# EAGLE schematic RefOsc10MHz_3V0_bga-escaped (EAGLE 7.2.0), part 1 of 2
DF4IAH - 10 MHz Reference Oscillator

## Sheet 1 of 27: Overview
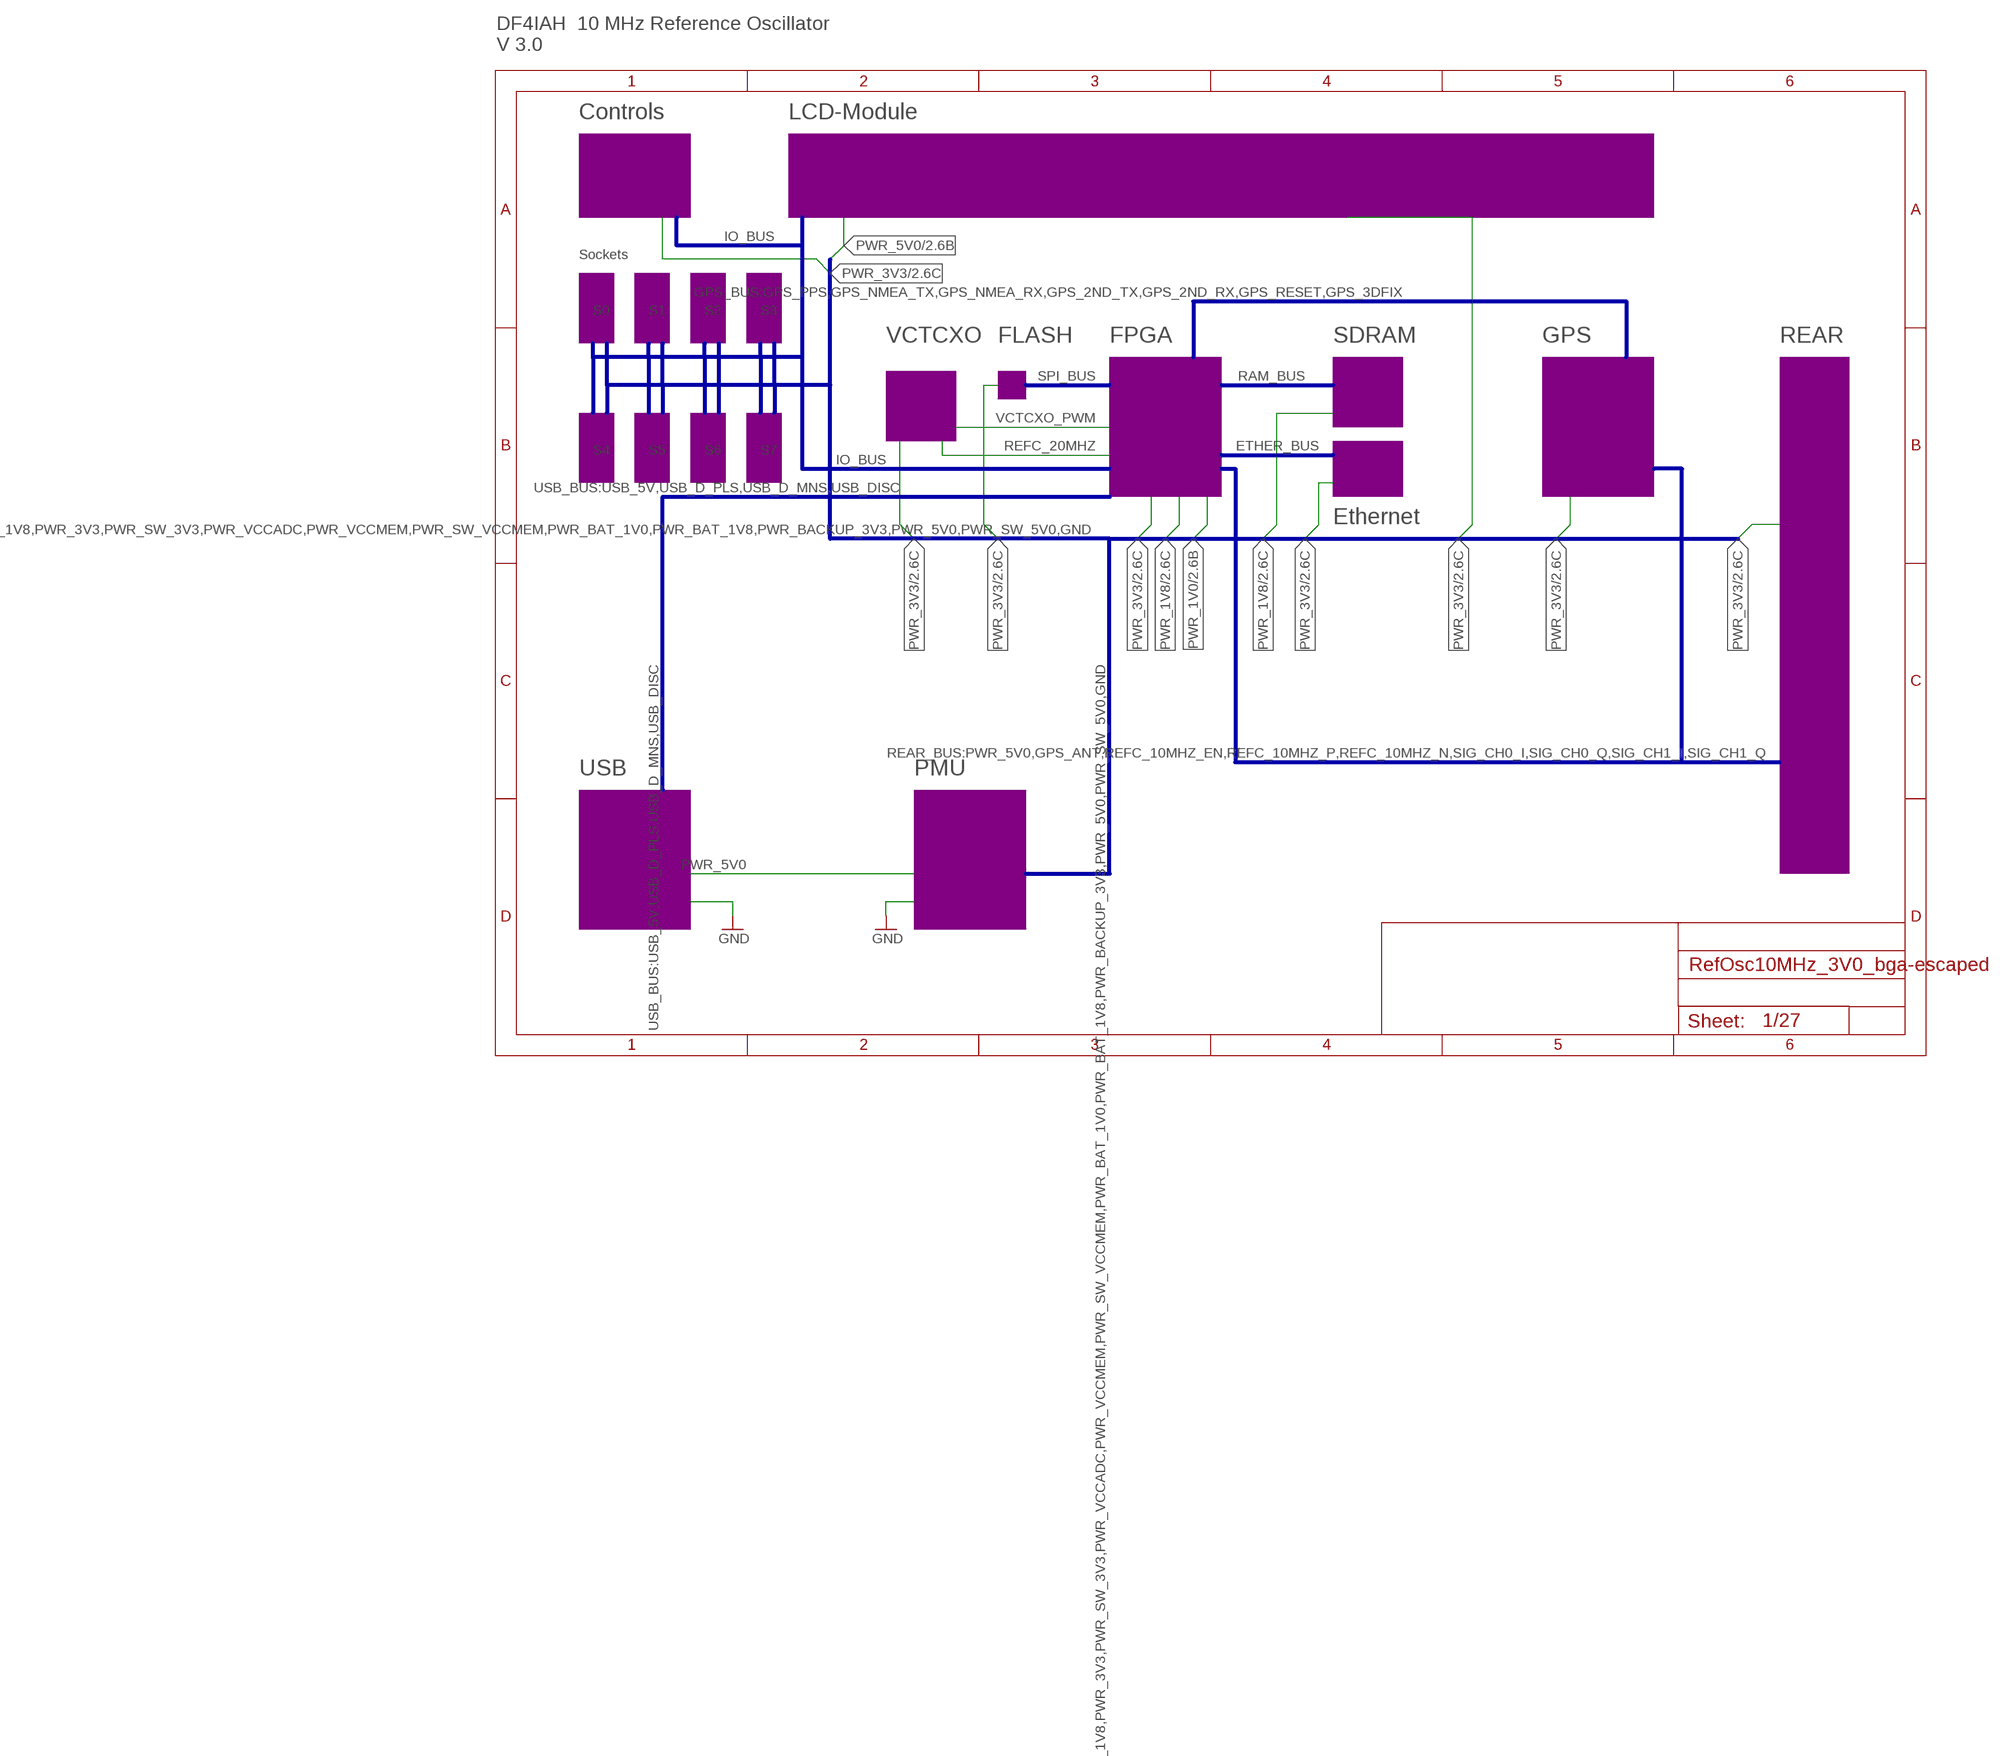
[diagram p0: schematic, sheet 1]

### Buses
USB_BUS:USB_5V,USB_D_PLS,USB_D_MNS,USB_DISC
PWR_RAIL:PWR_1V0,PWR_1V8,PWR_3V3,PWR_SW_3V3,PWR_VCCADC,PWR_VCCMEM,PWR_SW_VCCMEM,PWR_BAT_1V0,PWR_BAT_1V8,PWR_BACKUP_3V3,PWR_5V0,PWR_SW_5V0,GND
GPS_BUS:GPS_PPS,GPS_NMEA_TX,GPS_NMEA_RX,GPS_2ND_TX,GPS_2ND_RX,GPS_RESET,GPS_3DFIX
REAR_BUS:PWR_5V0,GPS_ANT,REFC_10MHZ_EN,REFC_10MHZ_P,REFC_10MHZ_N,SIG_CH0_I,SIG_CH0_Q,SIG_CH1_I,SIG_CH1_Q
IO_BUS
RAM_BUS
ETHER_BUS
SPI_BUS

### Notes on the sheet
- DF4IAH  10 MHz Reference Oscillator
  V 3.0
- Controls | LCD-Module
- Sockets
- S0 | S1 | S2 | S3
- VCTCXO | FLASH | FPGA | SDRAM | GPS | REAR
- S4 | S5 | S6 | S7
- Ethernet
- USB | PMU

## Sheet 2 of 27: PMU
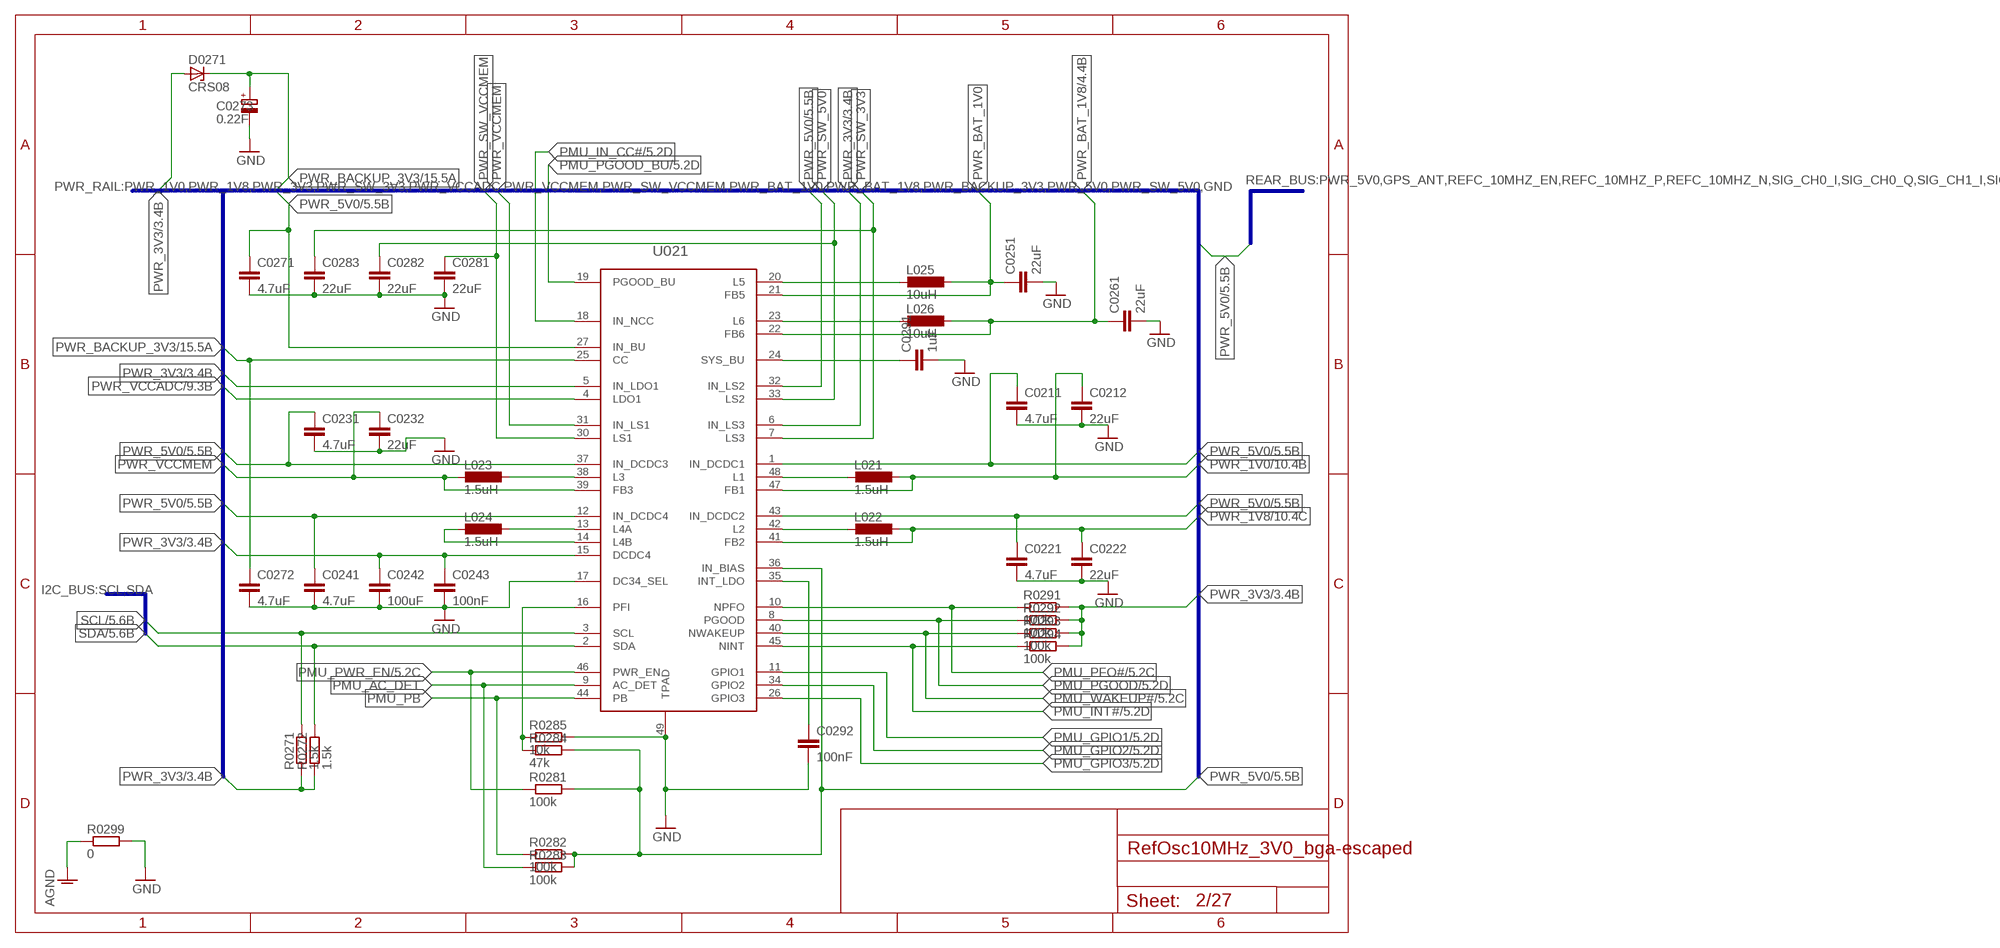
[diagram p1: schematic, sheet 2]

### Parts
C0211  4.7uF  C-EUC0805  [C0805]
C0212  22uF  C-EUC0805  [C0805]
C0221  4.7uF  C-EUC0805  [C0805]
C0222  22uF  C-EUC0805  [C0805]
C0231  4.7uF  C-EUC0805  [C0805]
C0232  22uF  C-EUC0805  [C0805]
C0241  4.7uF  C-EUC0805  [C0805]
C0242  100uF  C-EUC0805  [C0805]
C0243  100nF  C-EUC0805  [C0805]
C0251  22uF  C-EUC0805  [C0805]
C0261  22uF  C-EUC0805  [C0805]
C0271  4.7uF  C-EUC0805  [C0805]
C0272  4.7uF  C-EUC0805  [C0805]
C0273  0.22F  CPOL-EUC  [PANASONIC_C]
C0281  22uF  C-EUC0805  [C0805]
C0282  22uF  C-EUC0805  [C0805]
C0283  22uF  C-EUC0805  [C0805]
C0291  1uF  C-EUC0805  [C0805]
C0292  100nF  C-EUC0805  [C0805]
D0271  CRS08  ZENER-DIODESOT23  [SOT23]
L021  1.5uH  L-EUL1812  [L1812]
L022  1.5uH  L-EUL1812  [L1812]
L023  1.5uH  L-EUL1812  [L1812]
L024  1.5uH  L-EUL1812  [L1812]
L025  10uH  L-EUL1812  [L1812]
L026  10uH  L-EUL1812  [L1812]
R0271  1.5k  R-EU_R0603  [R0603]
R0272  1.5k  R-EU_R0603  [R0603]
R0281  100k  R-EU_R0603  [R0603]
R0282  100k  R-EU_R0603  [R0603]
R0283  100k  R-EU_R0603  [R0603]
R0284  47k  R-EU_R0603  [R0603]
R0285  10k  R-EU_R0603  [R0603]
R0291  100k  R-EU_R0603  [R0603]
R0292  100k  R-EU_R0603  [R0603]
R0293  100k  R-EU_R0603  [R0603]
R0294  100k  R-EU_R0603  [R0603]
R0299  0  R-EU_R0805  [R0805]
U021  TPS65218  [QFP50P900X900X120-49N2]

### Nets
AGND: R0299.1 ; also sheet 9
GND: C0211.2 C0212.2 C0221.2 C0222.2 C0231.2 C0232.2 C0241.2 C0242.2 C0243.2 C0251.2 C0261.2 C0271.2 C0272.2 C0273.- C0281.2 C0282.2 C0283.2 C0291.2 C0292.2 R0285.2 R0299.2 U021.17(DC34_SEL) U021.49(TPAD) ; also sheet 1,3,4,5,6,7,8,9,10,11,14,15,18,19
L1: L021.2 U021.48(L1)
L2: L022.2 U021.42(L2)
L3: L023.1 U021.38(L3)
L4A: L024.1 U021.13(L4A)
L4B: L024.2 U021.14(L4B)
L5: L025.2 U021.20(L5)
L6: L026.2 U021.23(L6)
N$1: C0292.1 U021.35(INT_LDO)
N$2: R0284.1 R0285.1 U021.16(PFI)
PMU_AC_DET: R0283.1 U021.9(AC_DET)
PMU_GPIO1: U021.11(GPIO1) ; also sheet 5
PMU_GPIO2: U021.34(GPIO2) ; also sheet 5
PMU_GPIO3: U021.26(GPIO3) ; also sheet 5
PMU_IN_CC#: U021.18(IN_NCC) ; also sheet 5
PMU_INT#: R0294.1 U021.45(NINT) ; also sheet 5
PMU_PB: R0282.1 U021.44(PB)
PMU_PFO#: R0291.1 U021.10(NPFO) ; also sheet 5
PMU_PGOOD: R0292.1 U021.8(PGOOD) ; also sheet 5
PMU_PGOOD_BU: U021.19(PGOOD_BU) ; also sheet 5
PMU_PWR_EN: R0281.1 U021.46(PWR_EN) ; also sheet 5
PMU_WAKEUP#: R0293.1 U021.40(NWAKEUP) ; also sheet 5
PWR_1V0 [PWR_LOW]: C0212.1 L021.1 U021.47(FB1) ; also sheet 1,10
PWR_1V8 [PWR_LOW]: C0222.1 L022.1 U021.41(FB2) ; also sheet 1,10
PWR_3V3 [PWR_MED]: C0242.1 C0243.1 D0271.1(A) R0271.1 R0272.1 R0291.2 R0292.2 R0293.2 R0294.2 U021.5(IN_LDO1) U021.6(IN_LS3) U021.15(DCDC4) ; also sheet 1,3,4,5,6,7,8,11,15
PWR_5V0: C0211.1 C0221.1 C0231.1 C0241.1 C0271.1 R0281.2 R0282.2 R0283.2 R0284.2 U021.1(IN_DCDC1) U021.12(IN_DCDC4) U021.27(IN_BU) U021.32(IN_LS2) U021.36(IN_BIAS) U021.37(IN_DCDC3) U021.43(IN_DCDC2) ; also sheet 1,5,14,15,18
PWR_BACKUP_3V3 [PWR_LOW]: C0272.1 C0273.+ D0271.3(C) U021.25(CC) ; also sheet 15
PWR_BAT_1V0: C0251.1 L025.1 U021.21(FB5)
PWR_BAT_1V8: C0261.1 L026.1 U021.22(FB6) ; also sheet 4
PWR_SW_3V3: C0283.1 U021.7(LS3)
PWR_SW_5V0: C0282.1 U021.33(LS2)
PWR_SW_VCCMEM: C0281.1 U021.30(LS1)
PWR_VCCADC: U021.4(LDO1) ; also sheet 9
PWR_VCCMEM: C0232.1 L023.2 U021.31(IN_LS1) U021.39(FB3)
SCL: R0271.2 U021.3(SCL) ; also sheet 5
SDA: R0272.2 U021.2(SDA) ; also sheet 5
SYS_BU: C0291.1 U021.24(SYS_BU)

### Buses
PWR_RAIL:PWR_1V0,PWR_1V8,PWR_3V3,PWR_SW_3V3,PWR_VCCADC,PWR_VCCMEM,PWR_SW_VCCMEM,PWR_BAT_1V0,PWR_BAT_1V8,PWR_BACKUP_3V3,PWR_5V0,PWR_SW_5V0,GND
I2C_BUS:SCL,SDA
REAR_BUS:PWR_5V0,GPS_ANT,REFC_10MHZ_EN,REFC_10MHZ_P,REFC_10MHZ_N,SIG_CH0_I,SIG_CH0_Q,SIG_CH1_I,SIG_CH1_Q

## Sheet 3 of 27: VCTCXO
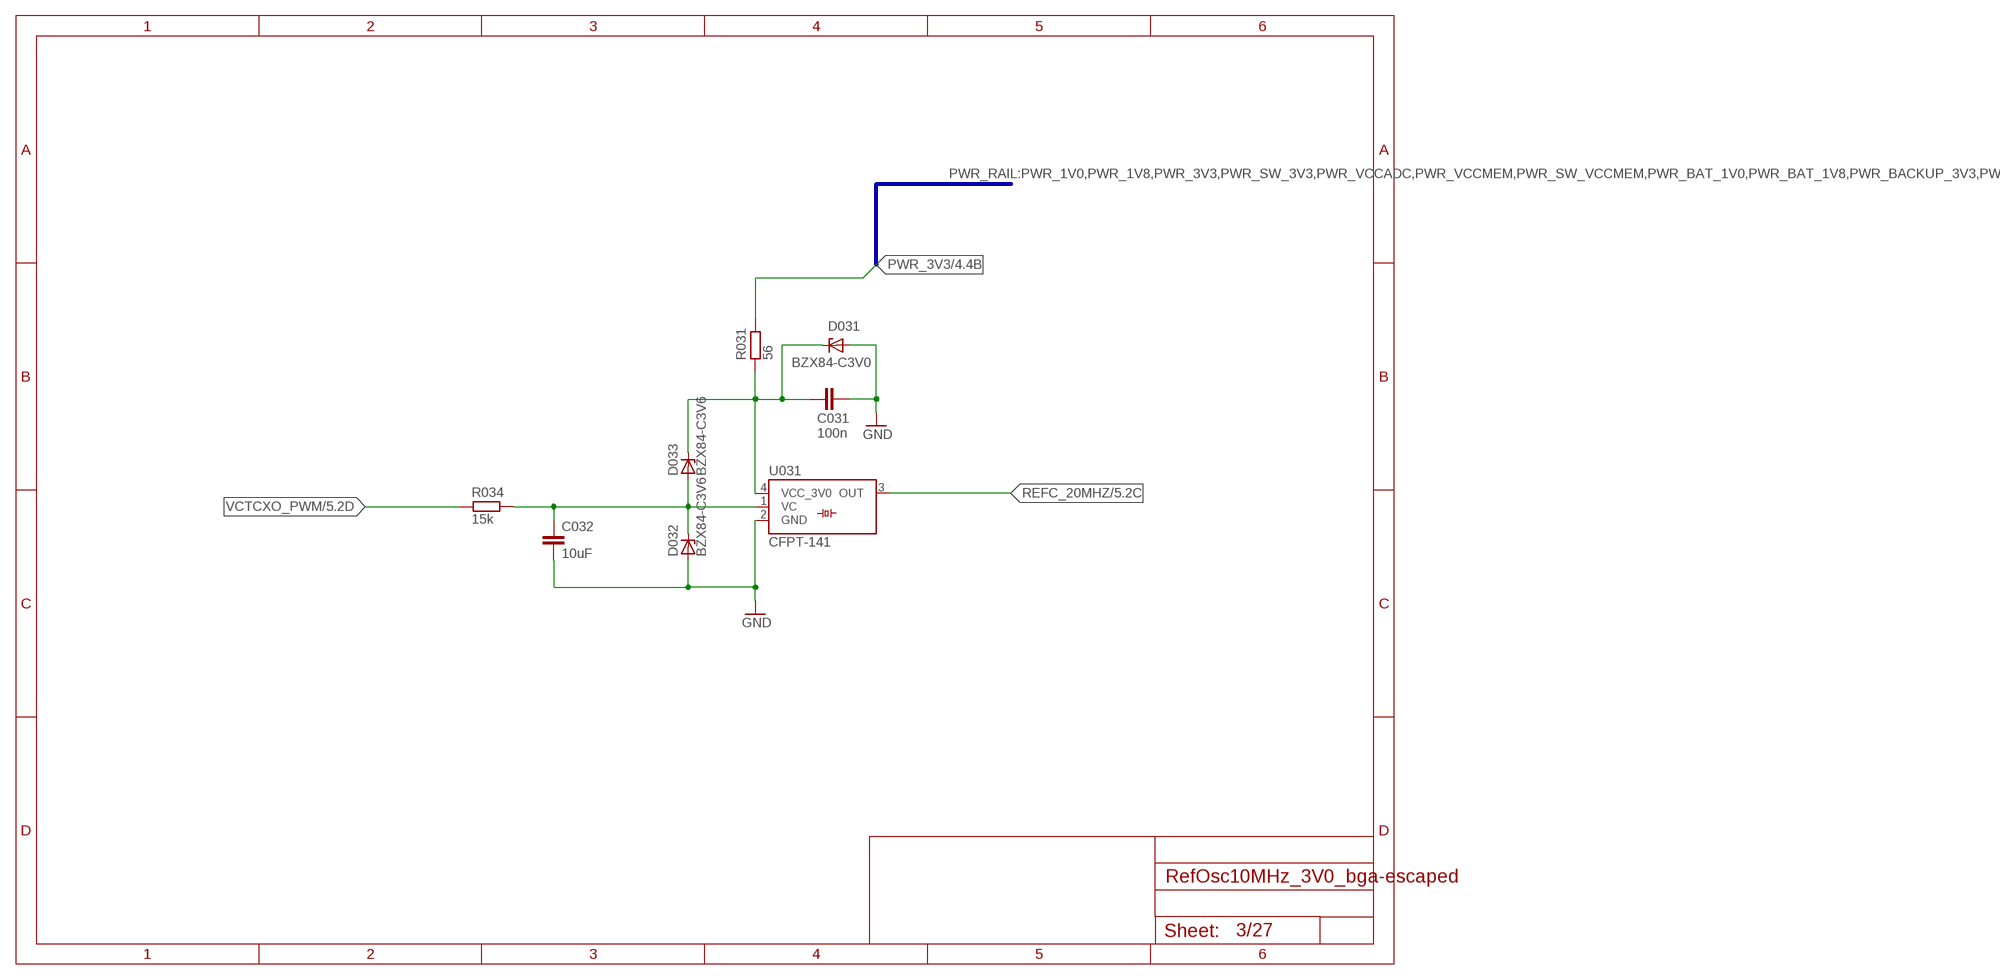
[diagram p2: schematic, sheet 3]

### Parts
C031  100n  C-EUC0805  [C0805]
C032  10uF  C-EUC0805  [C0805]
D031  BZX84-C3V0  BZX84CSMD  [TO236]
D032  BZX84-C3V6  BZX84CSMD  [TO236]
D033  BZX84-C3V6  BZX84CSMD  [TO236]
R031  56  R-EU_R0805  [R0805]
R034  15k  R-EU_R0603  [R0603]
U031  CFPT-141  [CFPT-141]

### Nets
GND: C031.2 C032.2 D031.A D032.A U031.2(GND) ; also sheet 1,2,4,5,6,7,8,9,10,11,14,15,18,19
PWR_3V3 [PWR_MED]: R031.1 ; also sheet 1,2,4,5,6,7,8,11,15
PWR_VCTCXO_3V0 [PWR_LOW]: C031.1 D031.C D033.C R031.2 U031.4(VCC_3V0)
REFC_20MHZ [CLK]: U031.3(OUT) ; also sheet 1,5
VCTCXO_PWM: R034.2 ; also sheet 1,5
VCTCXO_VC_IN: C032.1 D032.C D033.A R034.1 U031.1(VC)

### Buses
PWR_RAIL:PWR_1V0,PWR_1V8,PWR_3V3,PWR_SW_3V3,PWR_VCCADC,PWR_VCCMEM,PWR_SW_VCCMEM,PWR_BAT_1V0,PWR_BAT_1V8,PWR_BACKUP_3V3,PWR_5V0,PWR_SW_5V0,GND

## Sheet 4 of 27: FPGA_B0_1of7
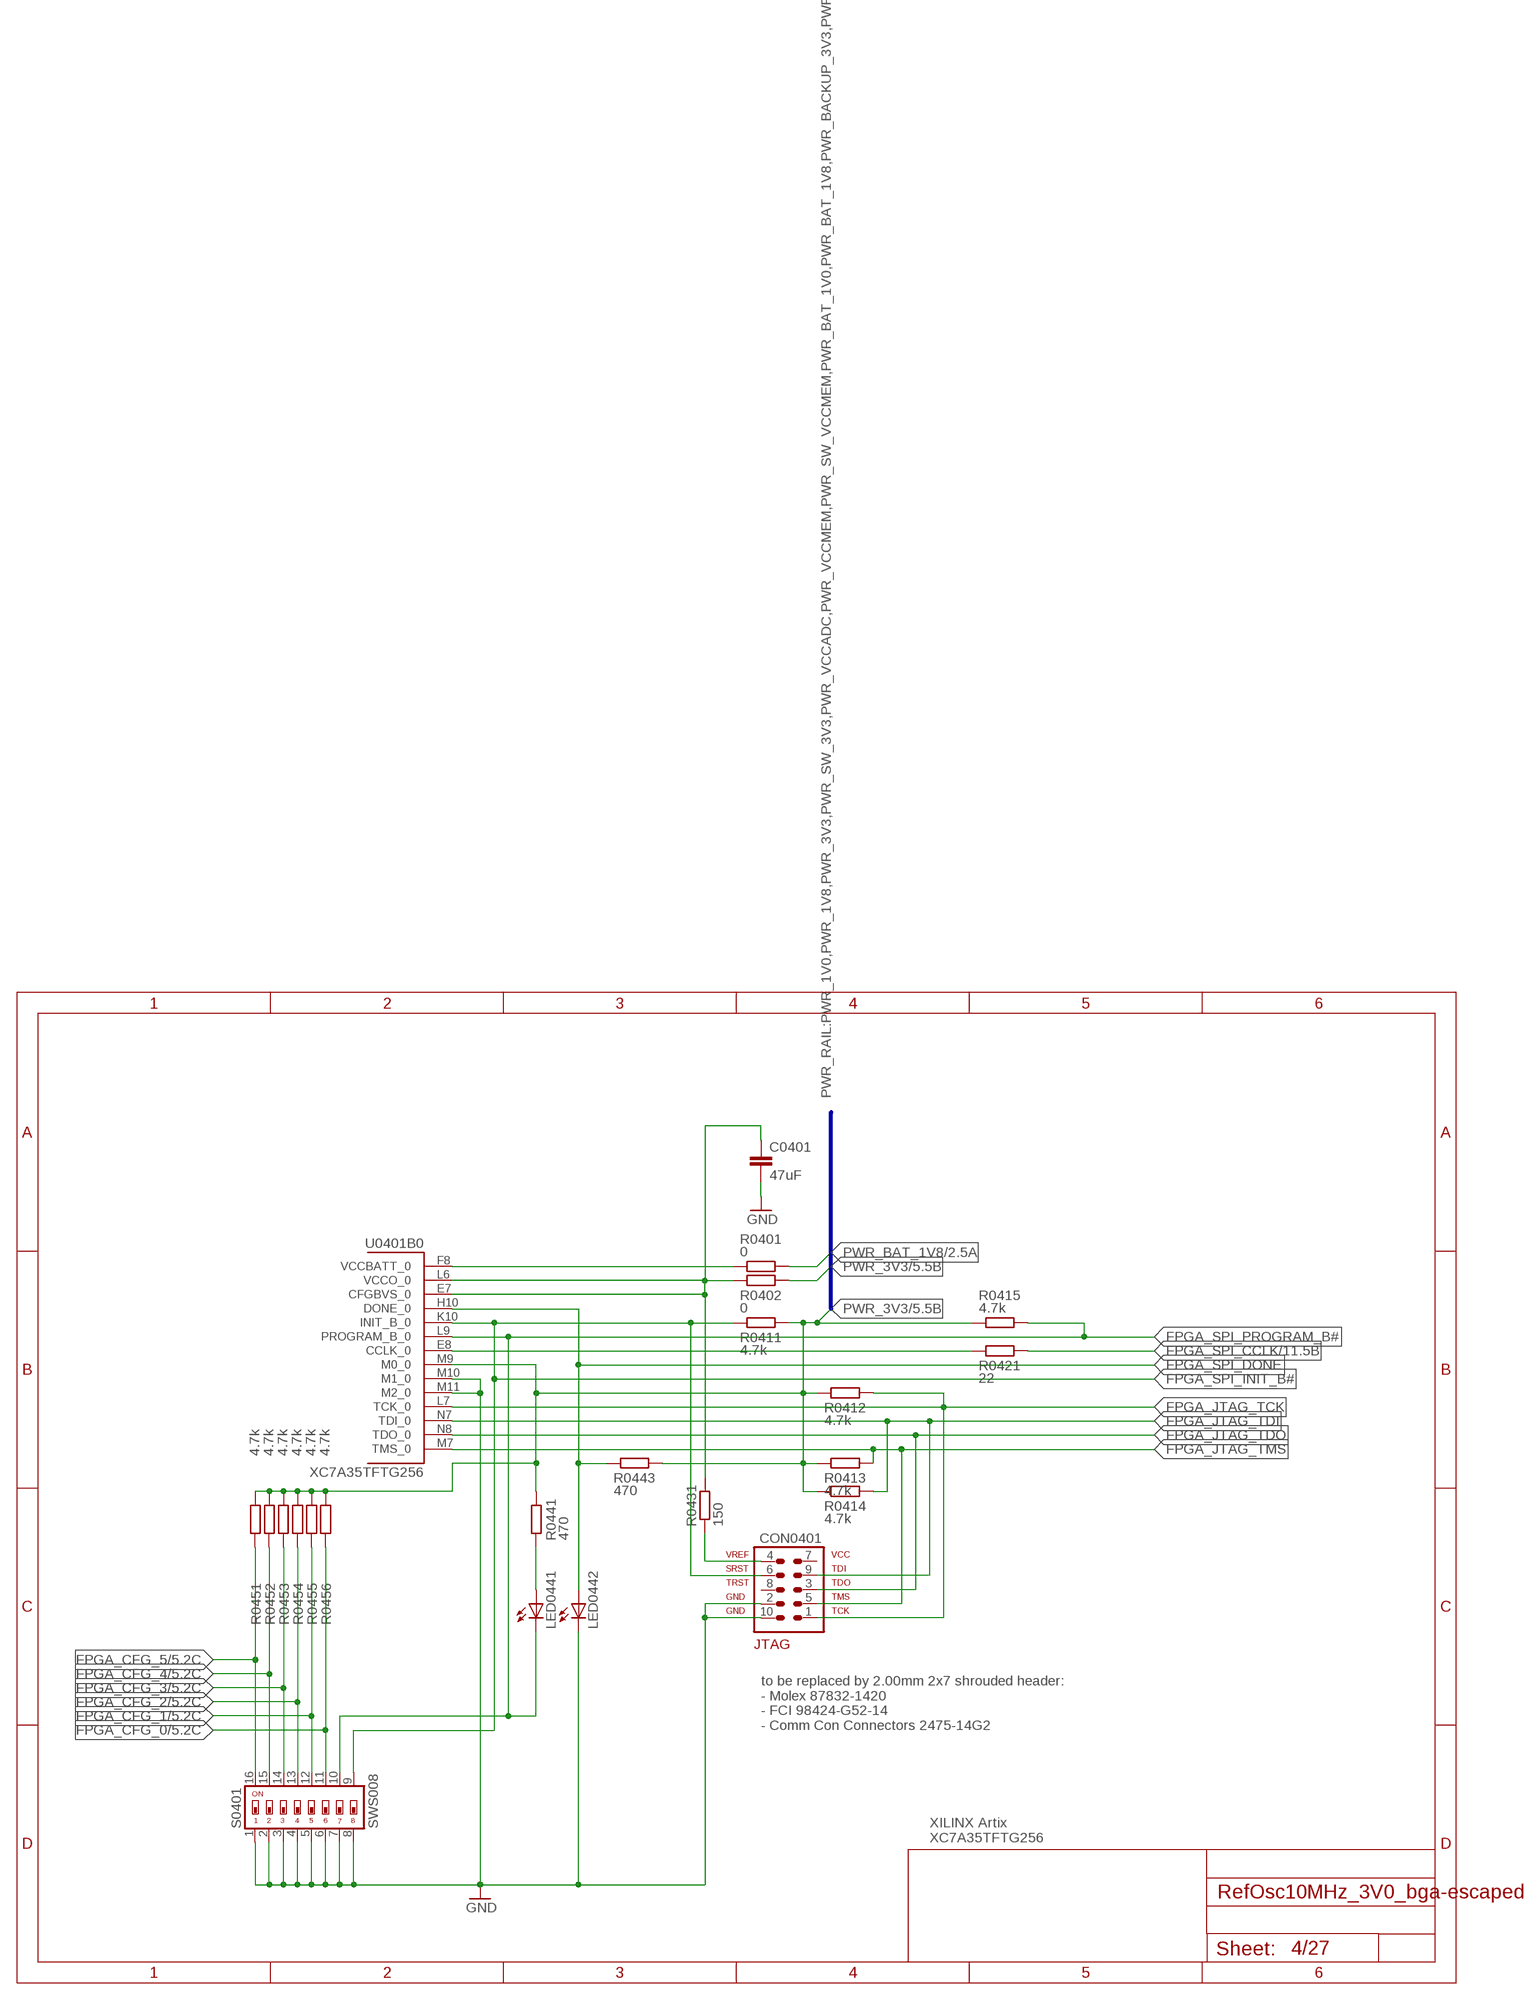
[diagram p3: schematic, sheet 4]

### Parts
C0401  47uF  C-EUC0805  [C0805]
CON0401  AVR-JTAG-10SMD  [2X5SMD]
LED0441  LED  [SMARTLED-TTW]
LED0442  LED  [SMARTLED-TTW]
R0401  0  R-EU_R0402  [R0402]
R0402  0  R-EU_R0402  [R0402]
R0411  4.7k  R-EU_R0805  [R0805]
R0412  4.7k  R-EU_R0805  [R0805]
R0413  4.7k  R-EU_R0805  [R0805]
R0414  4.7k  R-EU_R0805  [R0805]
R0415  4.7k  R-EU_R0805  [R0805]
R0421  22  R-EU_R0805  [R0805]
R0431  150  R-EU_R0805  [R0805]
R0441  470  R-EU_R0805  [R0805]
R0443  470  R-EU_R0805  [R0805]
R0451  4.7k  R-EU_R0805  [R0805]
R0452  4.7k  R-EU_R0805  [R0805]
R0453  4.7k  R-EU_R0805  [R0805]
R0454  4.7k  R-EU_R0805  [R0805]
R0455  4.7k  R-EU_R0805  [R0805]
R0456  4.7k  R-EU_R0805  [R0805]
S0401  SWS008  [SMS-008]
U0401  XC7A35TFTG256  [FTG256_0MM4]

### Nets
FPGA_CCLK_INTERN: R0421.1 U0401.E8(B0:CCLK_0)
FPGA_CFG_0: R0456.1 S0401.11 ; also sheet 5
FPGA_CFG_1: R0455.1 S0401.12 ; also sheet 5
FPGA_CFG_2: R0454.1 S0401.13 ; also sheet 5
FPGA_CFG_3: R0453.1 S0401.14 ; also sheet 5
FPGA_CFG_4: R0452.1 S0401.15 ; also sheet 5
FPGA_CFG_5: R0451.1 S0401.16 ; also sheet 5
FPGA_JTAG_TCK: CON0401.1 R0412.2 U0401.L7(B0:TCK_0)
FPGA_JTAG_TDI: CON0401.9 R0414.2 U0401.N7(B0:TDI_0)
FPGA_JTAG_TDO: CON0401.3 U0401.N8(B0:TDO_0)
FPGA_JTAG_TMS: CON0401.5 R0413.2 U0401.M7(B0:TMS_0)
FPGA_SPI_CCLK: R0421.2 ; also sheet 11
FPGA_SPI_DONE: LED0442.A@1(A) R0443.1 U0401.H10(B0:DONE_0)
FPGA_SPI_INIT_B#: CON0401.6 R0411.1 S0401.9 U0401.K10(B0:INIT_B_0)
FPGA_SPI_PROGRAM_B#: LED0441.C@1(C) R0415.2 S0401.10 U0401.L9(B0:PROGRAM_B_0)
FPGA_VCCBATT: R0401.1 U0401.F8(B0:VCCBATT_0)
FPGA_VCCO_0: C0401.1 R0402.1 R0431.2 U0401.E7(B0:CFGBVS_0) U0401.L6(B0:VCCO_0)
GND: C0401.2 CON0401.2 CON0401.10 LED0442.C@1(C) S0401.1 S0401.2 S0401.3 S0401.4 S0401.5 S0401.6 S0401.7 S0401.8 U0401.M10(B0:M1_0) U0401.M11(B0:M2_0) ; also sheet 1,2,3,5,6,7,8,9,10,11,14,15,18,19
N$6: LED0441.A@1(A) R0441.1
N$11: CON0401.4 R0431.1
PWR_3V3 [PWR_MED]: R0402.2 R0411.2 R0412.1 R0413.1 R0414.1 R0415.1 R0441.2 R0443.2 R0451.2 R0452.2 R0453.2 R0454.2 R0455.2 R0456.2 U0401.M9(B0:M0_0) ; also sheet 1,2,3,5,6,7,8,11,15
PWR_BAT_1V8: R0401.2 ; also sheet 2
Unconnected: CON0401.7 CON0401.8

### Buses
PWR_RAIL:PWR_1V0,PWR_1V8,PWR_3V3,PWR_SW_3V3,PWR_VCCADC,PWR_VCCMEM,PWR_SW_VCCMEM,PWR_BAT_1V0,PWR_BAT_1V8,PWR_BACKUP_3V3,PWR_5V0,PWR_SW_5V0,GND

### Notes on the sheet
- to be replaced by 2.00mm 2x7 shrouded header:
  - Molex 87832-1420
  - FCI 98424-G52-14
  - Comm Con Connectors 2475-14G2
- XILINX Artix
  XC7A35TFTG256

## Sheet 5 of 27: FPGA_B14_2of7
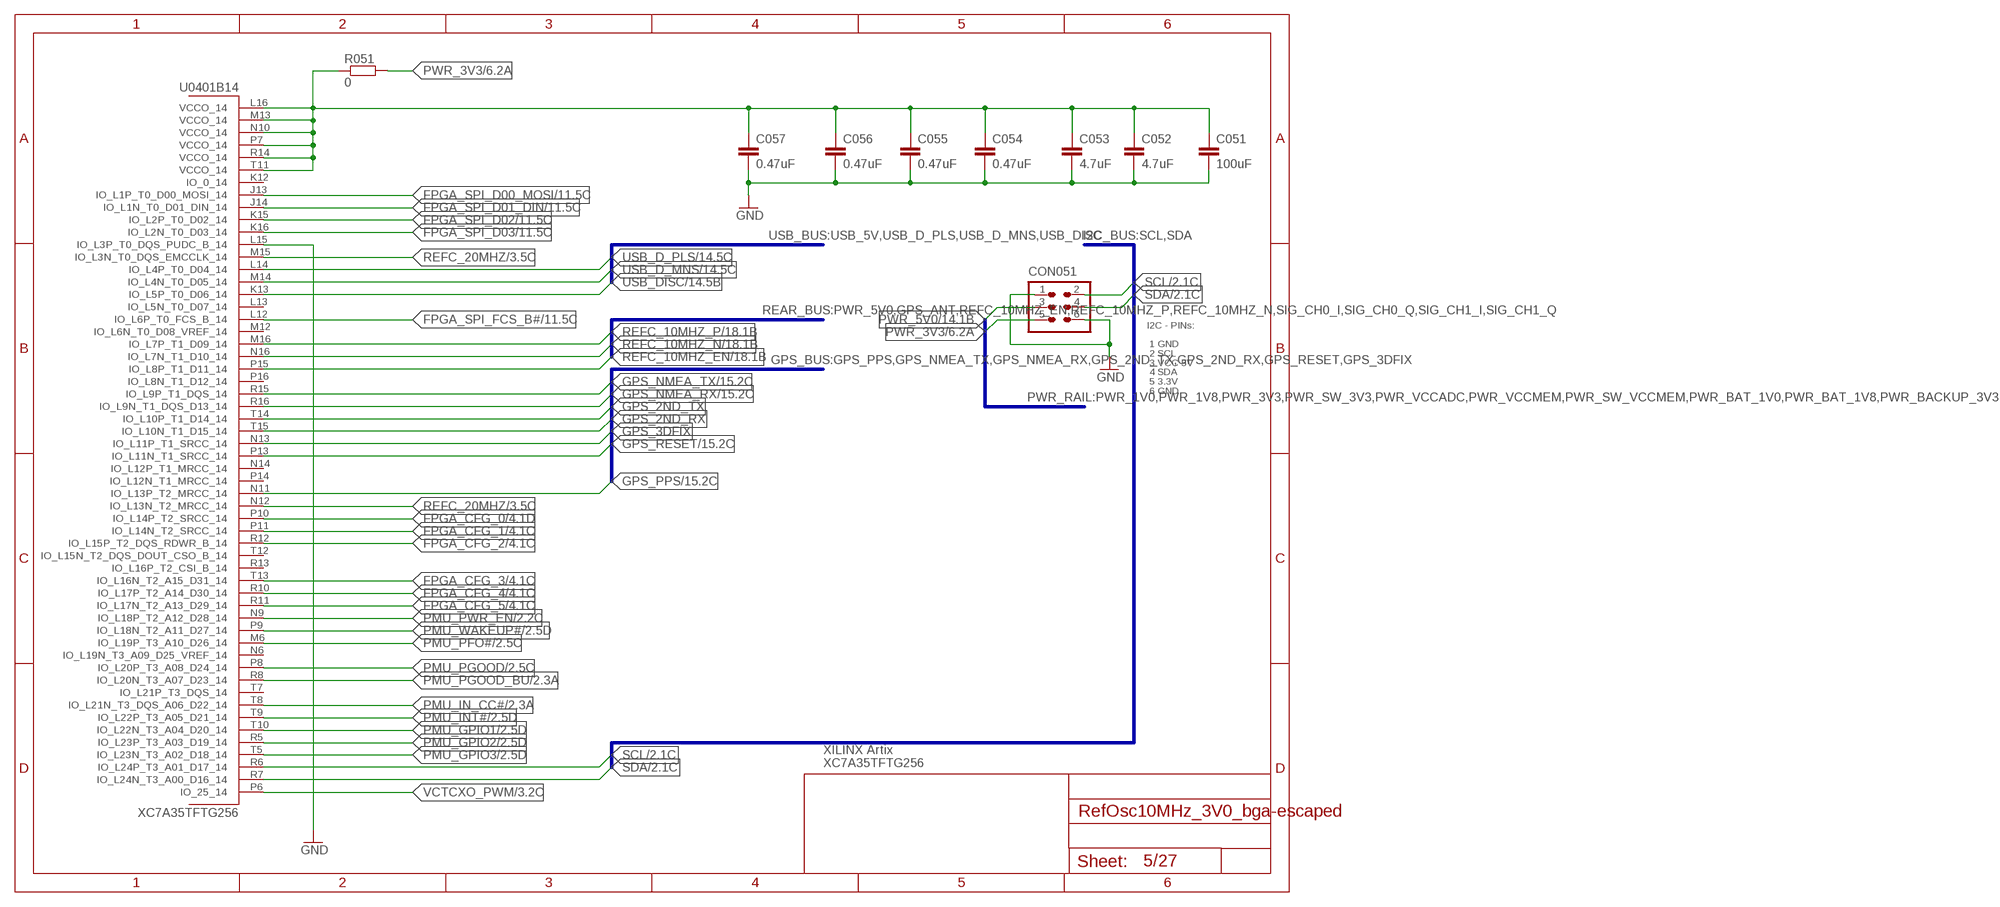
[diagram p4: schematic, sheet 5]

### Parts
C051  100uF  C-EUC1206  [C1206]
C052  4.7uF  C-EUC0402  [C0402]
C053  4.7uF  C-EUC0402  [C0402]
C054  0.47uF  C-EUC0402  [C0402]
C055  0.47uF  C-EUC0402  [C0402]
C056  0.47uF  C-EUC0402  [C0402]
C057  0.47uF  C-EUC0402  [C0402]
CON051  HEADER-2X3SMD  [2X03SMD]
R051  0  R-EU_R0402  [R0402]

### Nets
FPGA_CFG_0: U0401.P10(B14:IO_L14P_T2_SRCC_14) ; also sheet 4
FPGA_CFG_1: U0401.P11(B14:IO_L14N_T2_SRCC_14) ; also sheet 4
FPGA_CFG_2: U0401.R12(B14:IO_L15P_T2_DQS_RDWR_B_14) ; also sheet 4
FPGA_CFG_3: U0401.T13(B14:IO_L16N_T2_A15_D31_14) ; also sheet 4
FPGA_CFG_4: U0401.R10(B14:IO_L17P_T2_A14_D30_14) ; also sheet 4
FPGA_CFG_5: U0401.R11(B14:IO_L17N_T2_A13_D29_14) ; also sheet 4
FPGA_SPI_D00_MOSI: U0401.J13(B14:IO_L1P_T0_D00_MOSI_14) ; also sheet 11
FPGA_SPI_D01_DIN: U0401.J14(B14:IO_L1N_T0_D01_DIN_14) ; also sheet 11
FPGA_SPI_D02: U0401.K15(B14:IO_L2P_T0_D02_14) ; also sheet 11
FPGA_SPI_D03: U0401.K16(B14:IO_L2N_T0_D03_14) ; also sheet 11
FPGA_SPI_FCS_B#: U0401.L12(B14:IO_L6P_T0_FCS_B_14) ; also sheet 11
FPGA_VCCO_14: C051.1 C052.1 C053.1 C054.1 C055.1 C056.1 C057.1 R051.1 U0401.L16(B14:VCCO_14) U0401.M13(B14:VCCO_14) U0401.N10(B14:VCCO_14) U0401.P7(B14:VCCO_14) U0401.R14(B14:VCCO_14) U0401.T11(B14:VCCO_14)
GND: C051.2 C052.2 C053.2 C054.2 C055.2 C056.2 C057.2 CON051.1 CON051.6 U0401.L15(B14:IO_L3P_T0_DQS_PUDC_B_14) ; also sheet 1,2,3,4,6,7,8,9,10,11,14,15,18,19
GPS_2ND_RX: U0401.T15(B14:IO_L10N_T1_D15_14)
GPS_2ND_TX: U0401.T14(B14:IO_L10P_T1_D14_14)
GPS_3DFIX: U0401.N13(B14:IO_L11P_T1_SRCC_14)
GPS_NMEA_RX: U0401.R16(B14:IO_L9N_T1_DQS_D13_14) ; also sheet 15
GPS_NMEA_TX: U0401.R15(B14:IO_L9P_T1_DQS_14) ; also sheet 15
GPS_PPS: U0401.N11(B14:IO_L13P_T2_MRCC_14) ; also sheet 15
GPS_RESET: U0401.P13(B14:IO_L11N_T1_SRCC_14) ; also sheet 15
PMU_GPIO1: U0401.T10(B14:IO_L22N_T3_A04_D20_14) ; also sheet 2
PMU_GPIO2: U0401.R5(B14:IO_L23P_T3_A03_D19_14) ; also sheet 2
PMU_GPIO3: U0401.T5(B14:IO_L23N_T3_A02_D18_14) ; also sheet 2
PMU_IN_CC#: U0401.T8(B14:IO_L21N_T3_DQS_A06_D22_14) ; also sheet 2
PMU_INT#: U0401.T9(B14:IO_L22P_T3_A05_D21_14) ; also sheet 2
PMU_PFO#: U0401.M6(B14:IO_L19P_T3_A10_D26_14) ; also sheet 2
PMU_PGOOD: U0401.P8(B14:IO_L20P_T3_A08_D24_14) ; also sheet 2
PMU_PGOOD_BU: U0401.R8(B14:IO_L20N_T3_A07_D23_14) ; also sheet 2
PMU_PWR_EN: U0401.N9(B14:IO_L18P_T2_A12_D28_14) ; also sheet 2
PMU_WAKEUP#: U0401.P9(B14:IO_L18N_T2_A11_D27_14) ; also sheet 2
PWR_3V3 [PWR_MED]: CON051.5 R051.2 ; also sheet 1,2,3,4,6,7,8,11,15
PWR_5V0: CON051.3 ; also sheet 1,2,14,15,18
REFC_10MHZ_EN: U0401.P15(B14:IO_L8P_T1_D11_14) ; also sheet 18
REFC_10MHZ_N: U0401.N16(B14:IO_L7N_T1_D10_14) ; also sheet 18
REFC_10MHZ_P: U0401.M16(B14:IO_L7P_T1_D09_14) ; also sheet 18
REFC_20MHZ [CLK]: U0401.M15(B14:IO_L3N_T0_DQS_EMCCLK_14) U0401.N12(B14:IO_L13N_T2_MRCC_14) ; also sheet 1,3
SCL: CON051.2 U0401.R6(B14:IO_L24P_T3_A01_D17_14) ; also sheet 2
SDA: CON051.4 U0401.R7(B14:IO_L24N_T3_A00_D16_14) ; also sheet 2
USB_D_MNS: U0401.M14(B14:IO_L4N_T0_D05_14) ; also sheet 14
USB_D_PLS: U0401.L14(B14:IO_L4P_T0_D04_14) ; also sheet 14
USB_DISC: U0401.K13(B14:IO_L5P_T0_D06_14) ; also sheet 14
VCTCXO_PWM: U0401.P6(B14:IO_25_14) ; also sheet 1,3
Unconnected: U0401.K12(B14:IO_0_14) U0401.L13(B14:IO_L5N_T0_D07_14) U0401.M12(B14:IO_L6N_T0_D08_VREF_14) U0401.N6(B14:IO_L19N_T3_A09_D25_VREF_14) U0401.N14(B14:IO_L12P_T1_MRCC_14) U0401.P14(B14:IO_L12N_T1_MRCC_14) U0401.P16(B14:IO_L8N_T1_D12_14) U0401.R13(B14:IO_L16P_T2_CSI_B_14) U0401.T7(B14:IO_L21P_T3_DQS_14) U0401.T12(B14:IO_L15N_T2_DQS_DOUT_CSO_B_14)

### Buses
I2C_BUS:SCL,SDA
USB_BUS:USB_5V,USB_D_PLS,USB_D_MNS,USB_DISC
GPS_BUS:GPS_PPS,GPS_NMEA_TX,GPS_NMEA_RX,GPS_2ND_TX,GPS_2ND_RX,GPS_RESET,GPS_3DFIX
REAR_BUS:PWR_5V0,GPS_ANT,REFC_10MHZ_EN,REFC_10MHZ_P,REFC_10MHZ_N,SIG_CH0_I,SIG_CH0_Q,SIG_CH1_I,SIG_CH1_Q
PWR_RAIL:PWR_1V0,PWR_1V8,PWR_3V3,PWR_SW_3V3,PWR_VCCADC,PWR_VCCMEM,PWR_SW_VCCMEM,PWR_BAT_1V0,PWR_BAT_1V8,PWR_BACKUP_3V3,PWR_5V0,PWR_SW_5V0,GND

### Notes on the sheet
- I2C - PINs:
  
   1 GND
   2 SCL
   3 VCC 5V
   4 SDA
   5 3.3V
   6 GND
- XILINX Artix
  XC7A35TFTG256

## Sheet 6 of 27: FPGA_B15_3of7
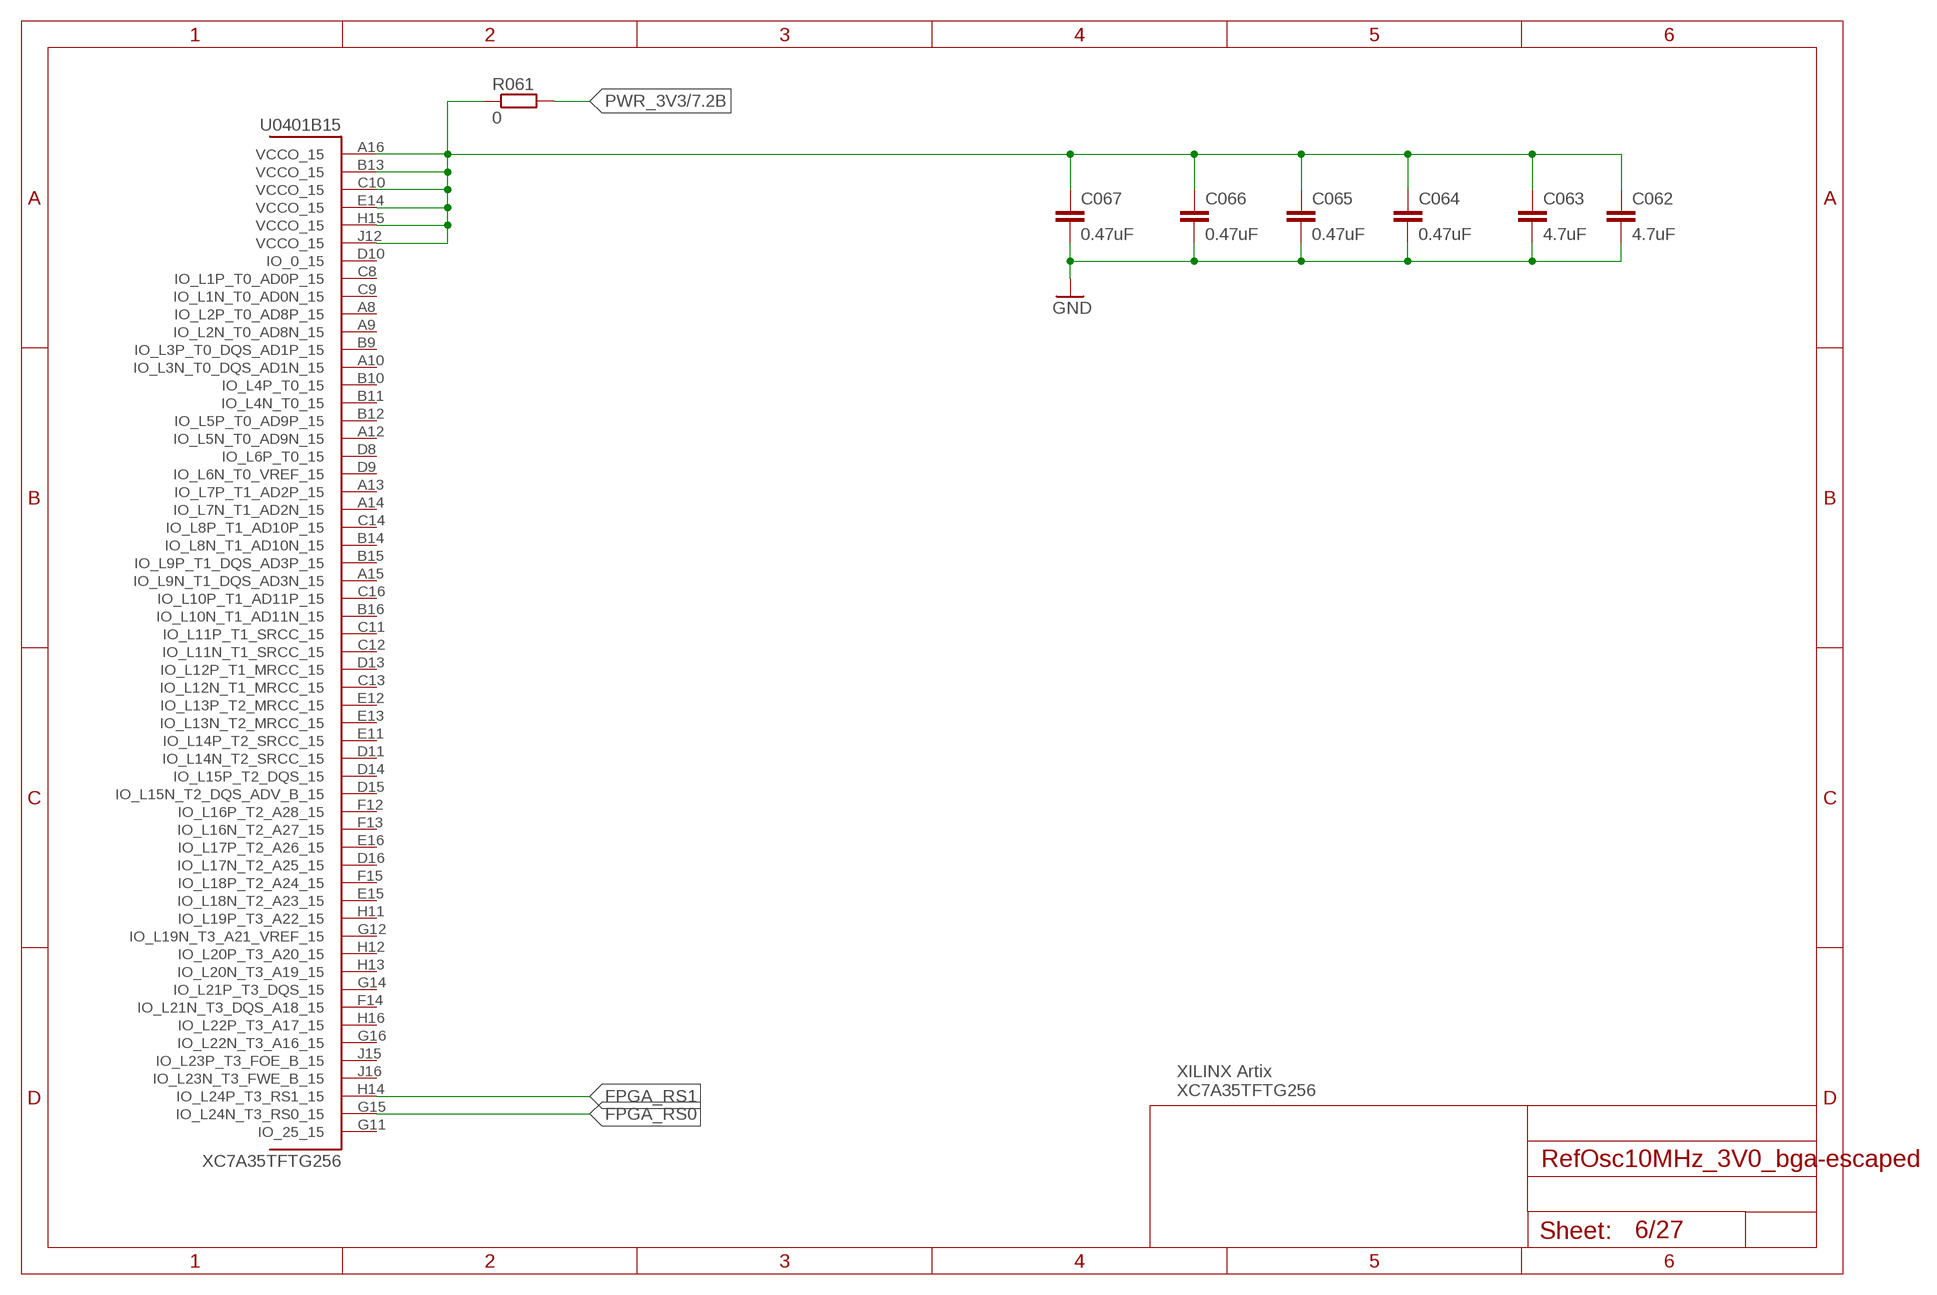
[diagram p5: schematic, sheet 6]

### Parts
C062  4.7uF  C-EUC0402  [C0402]
C063  4.7uF  C-EUC0402  [C0402]
C064  0.47uF  C-EUC0402  [C0402]
C065  0.47uF  C-EUC0402  [C0402]
C066  0.47uF  C-EUC0402  [C0402]
C067  0.47uF  C-EUC0402  [C0402]
R061  0  R-EU_R0402  [R0402]

### Nets
FPGA_RS0: U0401.G15(B15:IO_L24N_T3_RS0_15)
FPGA_RS1: U0401.H14(B15:IO_L24P_T3_RS1_15)
FPGA_VCCO_15: C062.1 C063.1 C064.1 C065.1 C066.1 C067.1 R061.1 U0401.A16(B15:VCCO_15) U0401.B13(B15:VCCO_15) U0401.C10(B15:VCCO_15) U0401.E14(B15:VCCO_15) U0401.H15(B15:VCCO_15) U0401.J12(B15:VCCO_15)
GND: C062.2 C063.2 C064.2 C065.2 C066.2 C067.2 ; also sheet 1,2,3,4,5,7,8,9,10,11,14,15,18,19
PWR_3V3 [PWR_MED]: R061.2 ; also sheet 1,2,3,4,5,7,8,11,15
Unconnected: U0401.A8(B15:IO_L2P_T0_AD8P_15) U0401.A9(B15:IO_L2N_T0_AD8N_15) U0401.A10(B15:IO_L3N_T0_DQS_AD1N_15) U0401.A12(B15:IO_L5N_T0_AD9N_15) U0401.A13(B15:IO_L7P_T1_AD2P_15) U0401.A14(B15:IO_L7N_T1_AD2N_15) U0401.A15(B15:IO_L9N_T1_DQS_AD3N_15) U0401.B9(B15:IO_L3P_T0_DQS_AD1P_15) U0401.B10(B15:IO_L4P_T0_15) U0401.B11(B15:IO_L4N_T0_15) U0401.B12(B15:IO_L5P_T0_AD9P_15) U0401.B14(B15:IO_L8N_T1_AD10N_15) U0401.B15(B15:IO_L9P_T1_DQS_AD3P_15) U0401.B16(B15:IO_L10N_T1_AD11N_15) U0401.C8(B15:IO_L1P_T0_AD0P_15) U0401.C9(B15:IO_L1N_T0_AD0N_15) U0401.C11(B15:IO_L11P_T1_SRCC_15) U0401.C12(B15:IO_L11N_T1_SRCC_15) U0401.C13(B15:IO_L12N_T1_MRCC_15) U0401.C14(B15:IO_L8P_T1_AD10P_15) U0401.C16(B15:IO_L10P_T1_AD11P_15) U0401.D8(B15:IO_L6P_T0_15) U0401.D9(B15:IO_L6N_T0_VREF_15) U0401.D10(B15:IO_0_15) U0401.D11(B15:IO_L14N_T2_SRCC_15) U0401.D13(B15:IO_L12P_T1_MRCC_15) U0401.D14(B15:IO_L15P_T2_DQS_15) U0401.D15(B15:IO_L15N_T2_DQS_ADV_B_15) U0401.D16(B15:IO_L17N_T2_A25_15) U0401.E11(B15:IO_L14P_T2_SRCC_15) U0401.E12(B15:IO_L13P_T2_MRCC_15) U0401.E13(B15:IO_L13N_T2_MRCC_15) U0401.E15(B15:IO_L18N_T2_A23_15) U0401.E16(B15:IO_L17P_T2_A26_15) U0401.F12(B15:IO_L16P_T2_A28_15) U0401.F13(B15:IO_L16N_T2_A27_15) U0401.F14(B15:IO_L21N_T3_DQS_A18_15) U0401.F15(B15:IO_L18P_T2_A24_15) U0401.G11(B15:IO_25_15) U0401.G12(B15:IO_L19N_T3_A21_VREF_15) U0401.G14(B15:IO_L21P_T3_DQS_15) U0401.G16(B15:IO_L22N_T3_A16_15) U0401.H11(B15:IO_L19P_T3_A22_15) U0401.H12(B15:IO_L20P_T3_A20_15) U0401.H13(B15:IO_L20N_T3_A19_15) U0401.H16(B15:IO_L22P_T3_A17_15) U0401.J15(B15:IO_L23P_T3_FOE_B_15) U0401.J16(B15:IO_L23N_T3_FWE_B_15)

### Notes on the sheet
- XILINX Artix
  XC7A35TFTG256

## Sheet 7 of 27: FPGA_B34_4of7
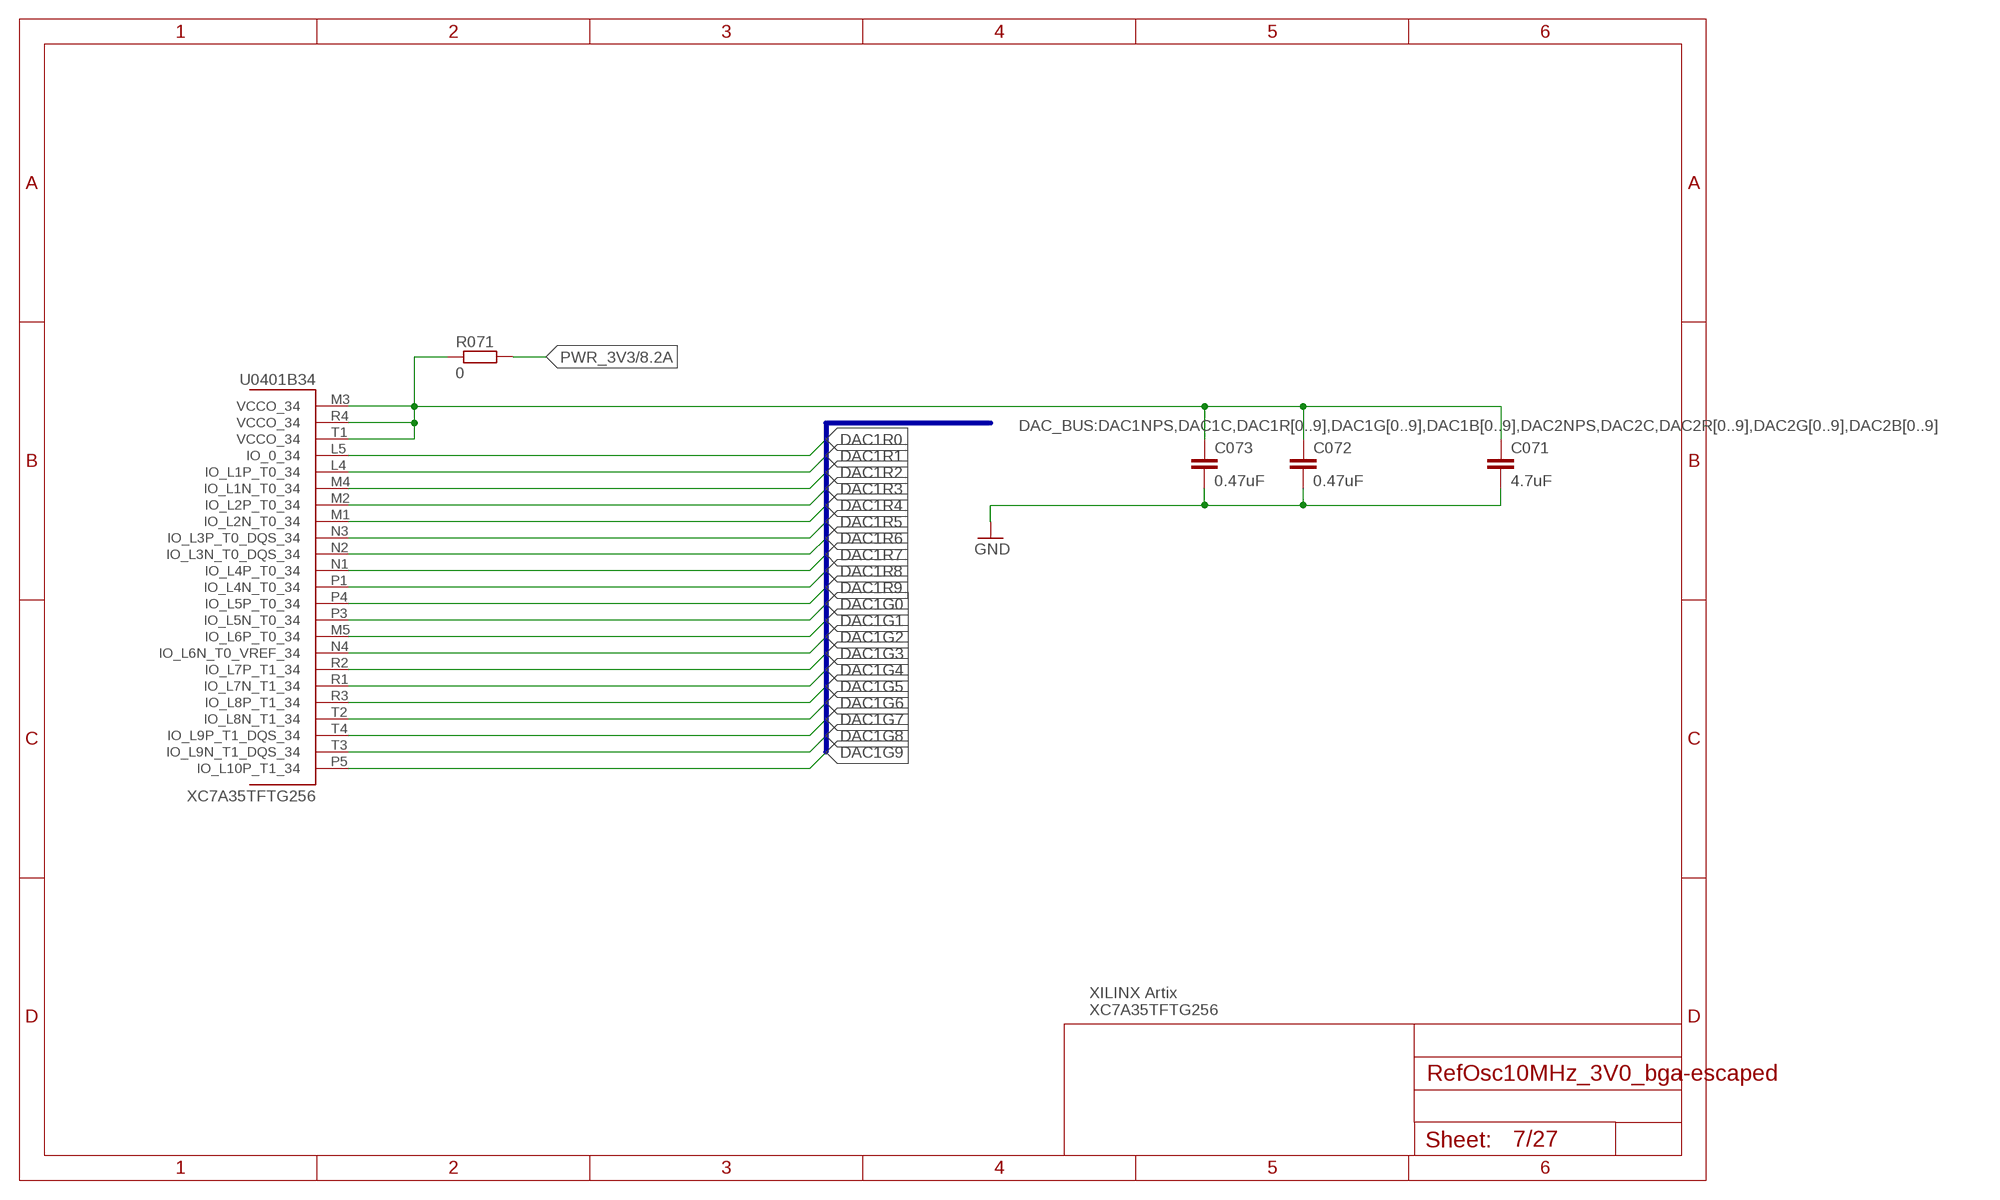
[diagram p6: schematic, sheet 7]

### Parts
C071  4.7uF  C-EUC0402  [C0402]
C072  0.47uF  C-EUC0402  [C0402]
C073  0.47uF  C-EUC0402  [C0402]
R071  0  R-EU_R0402  [R0402]

### Nets
DAC1G0: U0401.P3(B34:IO_L5N_T0_34)
DAC1G1: U0401.M5(B34:IO_L6P_T0_34)
DAC1G2: U0401.N4(B34:IO_L6N_T0_VREF_34)
DAC1G3: U0401.R2(B34:IO_L7P_T1_34)
DAC1G4: U0401.R1(B34:IO_L7N_T1_34)
DAC1G5: U0401.R3(B34:IO_L8P_T1_34)
DAC1G6: U0401.T2(B34:IO_L8N_T1_34)
DAC1G7: U0401.T4(B34:IO_L9P_T1_DQS_34)
DAC1G8: U0401.T3(B34:IO_L9N_T1_DQS_34)
DAC1G9: U0401.P5(B34:IO_L10P_T1_34)
DAC1R0: U0401.L5(B34:IO_0_34)
DAC1R1: U0401.L4(B34:IO_L1P_T0_34)
DAC1R2: U0401.M4(B34:IO_L1N_T0_34)
DAC1R3: U0401.M2(B34:IO_L2P_T0_34)
DAC1R4: U0401.M1(B34:IO_L2N_T0_34)
DAC1R5: U0401.N3(B34:IO_L3P_T0_DQS_34)
DAC1R6: U0401.N2(B34:IO_L3N_T0_DQS_34)
DAC1R7: U0401.N1(B34:IO_L4P_T0_34)
DAC1R8: U0401.P1(B34:IO_L4N_T0_34)
DAC1R9: U0401.P4(B34:IO_L5P_T0_34)
FPGA_VCCO_34: C071.1 C072.1 C073.1 R071.1 U0401.M3(B34:VCCO_34) U0401.R4(B34:VCCO_34) U0401.T1(B34:VCCO_34)
GND: C071.2 C072.2 C073.2 ; also sheet 1,2,3,4,5,6,8,9,10,11,14,15,18,19
PWR_3V3 [PWR_MED]: R071.2 ; also sheet 1,2,3,4,5,6,8,11,15

### Buses
DAC_BUS:DAC1NPS,DAC1C,DAC1R[0..9],DAC1G[0..9],DAC1B[0..9],DAC2NPS,DAC2C,DAC2R[0..9],DAC2G[0..9],DAC2B[0..9]

### Notes on the sheet
- XILINX Artix
  XC7A35TFTG256

## Sheet 8 of 27: FPGA_B35_5of7
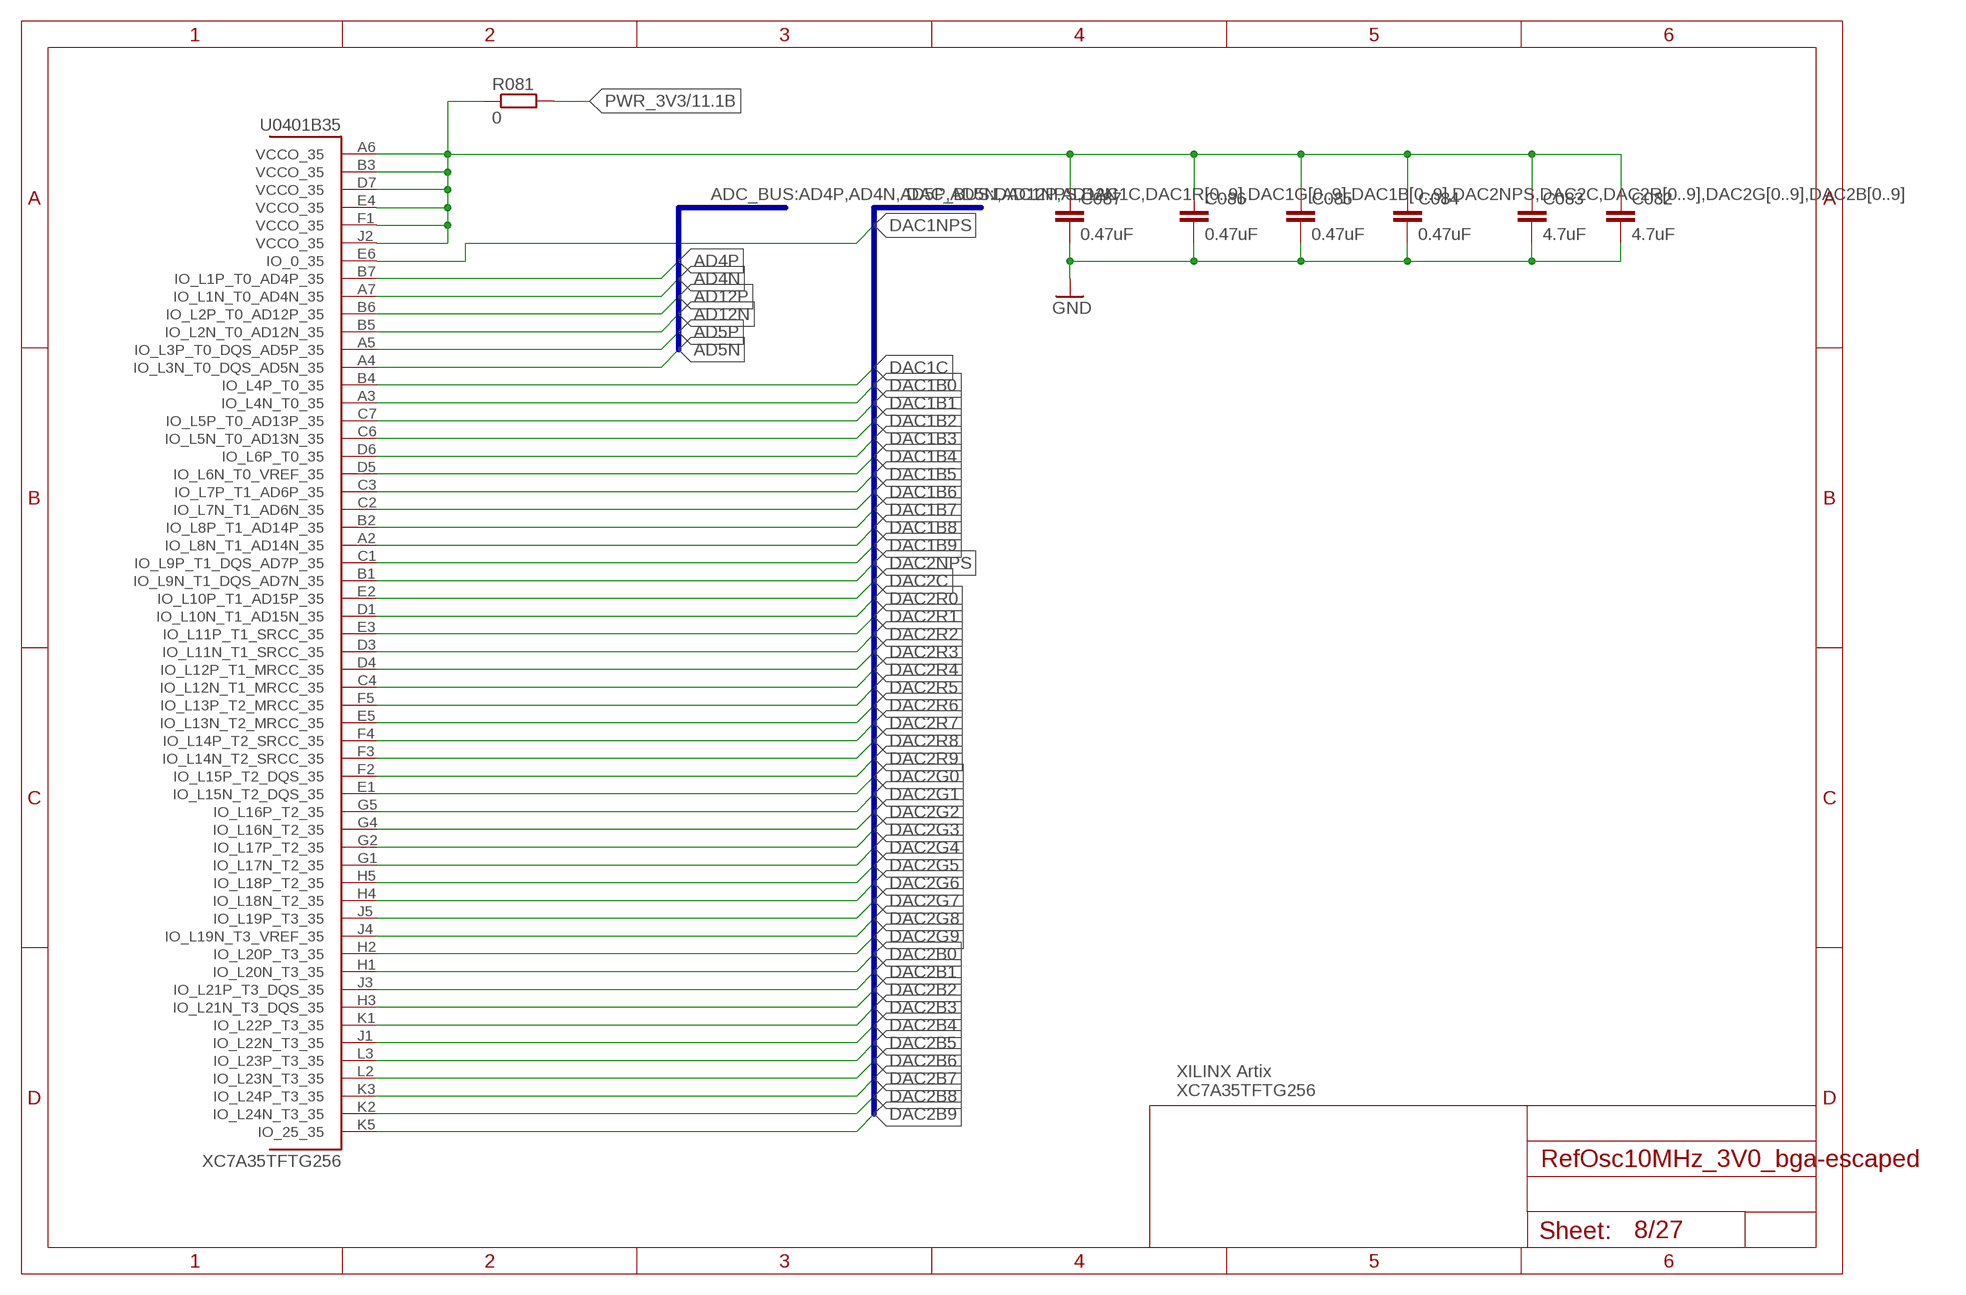
[diagram p7: schematic, sheet 8]

### Parts
C082  4.7uF  C-EUC0402  [C0402]
C083  4.7uF  C-EUC0402  [C0402]
C084  0.47uF  C-EUC0402  [C0402]
C085  0.47uF  C-EUC0402  [C0402]
C086  0.47uF  C-EUC0402  [C0402]
C087  0.47uF  C-EUC0402  [C0402]
R081  0  R-EU_R0402  [R0402]

### Nets
AD4N: U0401.A7(B35:IO_L1N_T0_AD4N_35)
AD4P: U0401.B7(B35:IO_L1P_T0_AD4P_35)
AD5N: U0401.A4(B35:IO_L3N_T0_DQS_AD5N_35)
AD5P: U0401.A5(B35:IO_L3P_T0_DQS_AD5P_35)
AD12N: U0401.B5(B35:IO_L2N_T0_AD12N_35)
AD12P: U0401.B6(B35:IO_L2P_T0_AD12P_35)
DAC1B0: U0401.A3(B35:IO_L4N_T0_35)
DAC1B1: U0401.C7(B35:IO_L5P_T0_AD13P_35)
DAC1B2: U0401.C6(B35:IO_L5N_T0_AD13N_35)
DAC1B3: U0401.D6(B35:IO_L6P_T0_35)
DAC1B4: U0401.D5(B35:IO_L6N_T0_VREF_35)
DAC1B5: U0401.C3(B35:IO_L7P_T1_AD6P_35)
DAC1B6: U0401.C2(B35:IO_L7N_T1_AD6N_35)
DAC1B7: U0401.B2(B35:IO_L8P_T1_AD14P_35)
DAC1B8: U0401.A2(B35:IO_L8N_T1_AD14N_35)
DAC1B9: U0401.C1(B35:IO_L9P_T1_DQS_AD7P_35)
DAC1C: U0401.B4(B35:IO_L4P_T0_35)
DAC1NPS: U0401.E6(B35:IO_0_35)
DAC2B0: U0401.H1(B35:IO_L20N_T3_35)
DAC2B1: U0401.J3(B35:IO_L21P_T3_DQS_35)
DAC2B2: U0401.H3(B35:IO_L21N_T3_DQS_35)
DAC2B3: U0401.K1(B35:IO_L22P_T3_35)
DAC2B4: U0401.J1(B35:IO_L22N_T3_35)
DAC2B5: U0401.L3(B35:IO_L23P_T3_35)
DAC2B6: U0401.L2(B35:IO_L23N_T3_35)
DAC2B7: U0401.K3(B35:IO_L24P_T3_35)
DAC2B8: U0401.K2(B35:IO_L24N_T3_35)
DAC2B9: U0401.K5(B35:IO_25_35)
DAC2C: U0401.E2(B35:IO_L10P_T1_AD15P_35)
DAC2G0: U0401.E1(B35:IO_L15N_T2_DQS_35)
DAC2G1: U0401.G5(B35:IO_L16P_T2_35)
DAC2G2: U0401.G4(B35:IO_L16N_T2_35)
DAC2G3: U0401.G2(B35:IO_L17P_T2_35)
DAC2G4: U0401.G1(B35:IO_L17N_T2_35)
DAC2G5: U0401.H5(B35:IO_L18P_T2_35)
DAC2G6: U0401.H4(B35:IO_L18N_T2_35)
DAC2G7: U0401.J5(B35:IO_L19P_T3_35)
DAC2G8: U0401.J4(B35:IO_L19N_T3_VREF_35)
DAC2G9: U0401.H2(B35:IO_L20P_T3_35)
DAC2NPS: U0401.B1(B35:IO_L9N_T1_DQS_AD7N_35)
DAC2R0: U0401.D1(B35:IO_L10N_T1_AD15N_35)
DAC2R1: U0401.E3(B35:IO_L11P_T1_SRCC_35)
DAC2R2: U0401.D3(B35:IO_L11N_T1_SRCC_35)
DAC2R3: U0401.D4(B35:IO_L12P_T1_MRCC_35)
DAC2R4: U0401.C4(B35:IO_L12N_T1_MRCC_35)
DAC2R5: U0401.F5(B35:IO_L13P_T2_MRCC_35)
DAC2R6: U0401.E5(B35:IO_L13N_T2_MRCC_35)
DAC2R7: U0401.F4(B35:IO_L14P_T2_SRCC_35)
DAC2R8: U0401.F3(B35:IO_L14N_T2_SRCC_35)
DAC2R9: U0401.F2(B35:IO_L15P_T2_DQS_35)
FPGA_VCCO_35: C082.1 C083.1 C084.1 C085.1 C086.1 C087.1 R081.1 U0401.A6(B35:VCCO_35) U0401.B3(B35:VCCO_35) U0401.D7(B35:VCCO_35) U0401.E4(B35:VCCO_35) U0401.F1(B35:VCCO_35) U0401.J2(B35:VCCO_35)
GND: C082.2 C083.2 C084.2 C085.2 C086.2 C087.2 ; also sheet 1,2,3,4,5,6,7,9,10,11,14,15,18,19
PWR_3V3 [PWR_MED]: R081.2 ; also sheet 1,2,3,4,5,6,7,11,15

### Buses
DAC_BUS:DAC1NPS,DAC1C,DAC1R[0..9],DAC1G[0..9],DAC1B[0..9],DAC2NPS,DAC2C,DAC2R[0..9],DAC2G[0..9],DAC2B[0..9]
ADC_BUS:AD4P,AD4N,AD5P,AD5N,AD12P,AD12N

### Notes on the sheet
- XILINX Artix
  XC7A35TFTG256

## Sheet 9 of 27: FPGA_BADC_6of7
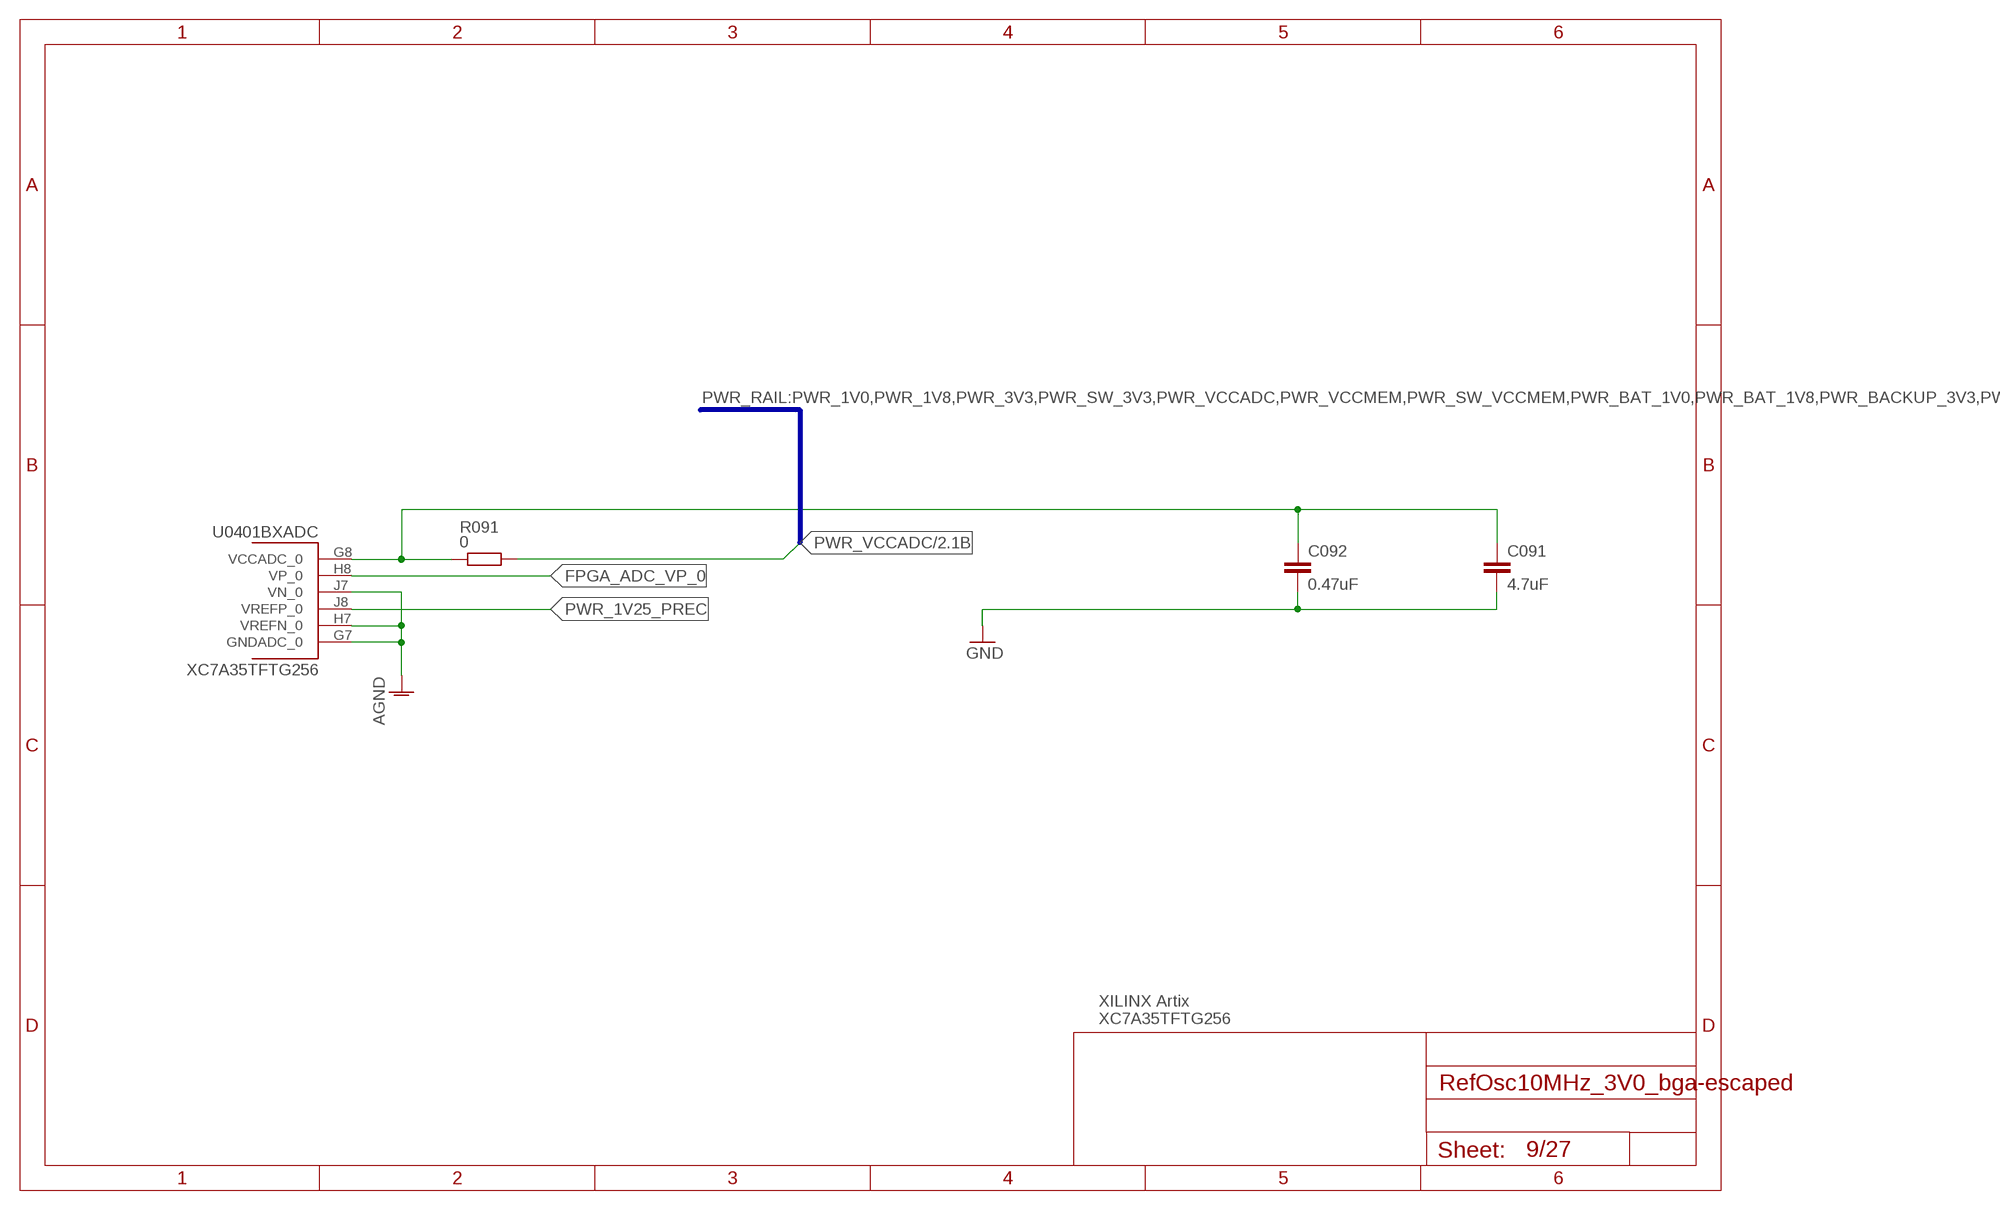
[diagram p8: schematic, sheet 9]

### Parts
C091  4.7uF  C-EUC0402  [C0402]
C092  0.47uF  C-EUC0402  [C0402]
R091  0  R-EU_R0402  [R0402]

### Nets
AGND: U0401.G7(BXADC:GNDADC_0) U0401.H7(BXADC:VREFN_0) U0401.J7(BXADC:VN_0) ; also sheet 2
FPGA_ADC_VP_0: U0401.H8(BXADC:VP_0)
FPGA_VCCADC_0: C091.1 C092.1 R091.1 U0401.G8(BXADC:VCCADC_0)
GND: C091.2 C092.2 ; also sheet 1,2,3,4,5,6,7,8,10,11,14,15,18,19
PWR_1V25_PREC: U0401.J8(BXADC:VREFP_0)
PWR_VCCADC: R091.2 ; also sheet 2

### Buses
PWR_RAIL:PWR_1V0,PWR_1V8,PWR_3V3,PWR_SW_3V3,PWR_VCCADC,PWR_VCCMEM,PWR_SW_VCCMEM,PWR_BAT_1V0,PWR_BAT_1V8,PWR_BACKUP_3V3,PWR_5V0,PWR_SW_5V0,GND

### Notes on the sheet
- XILINX Artix
  XC7A35TFTG256

## Sheet 10 of 27: FPGA_SUPPLY_7of7
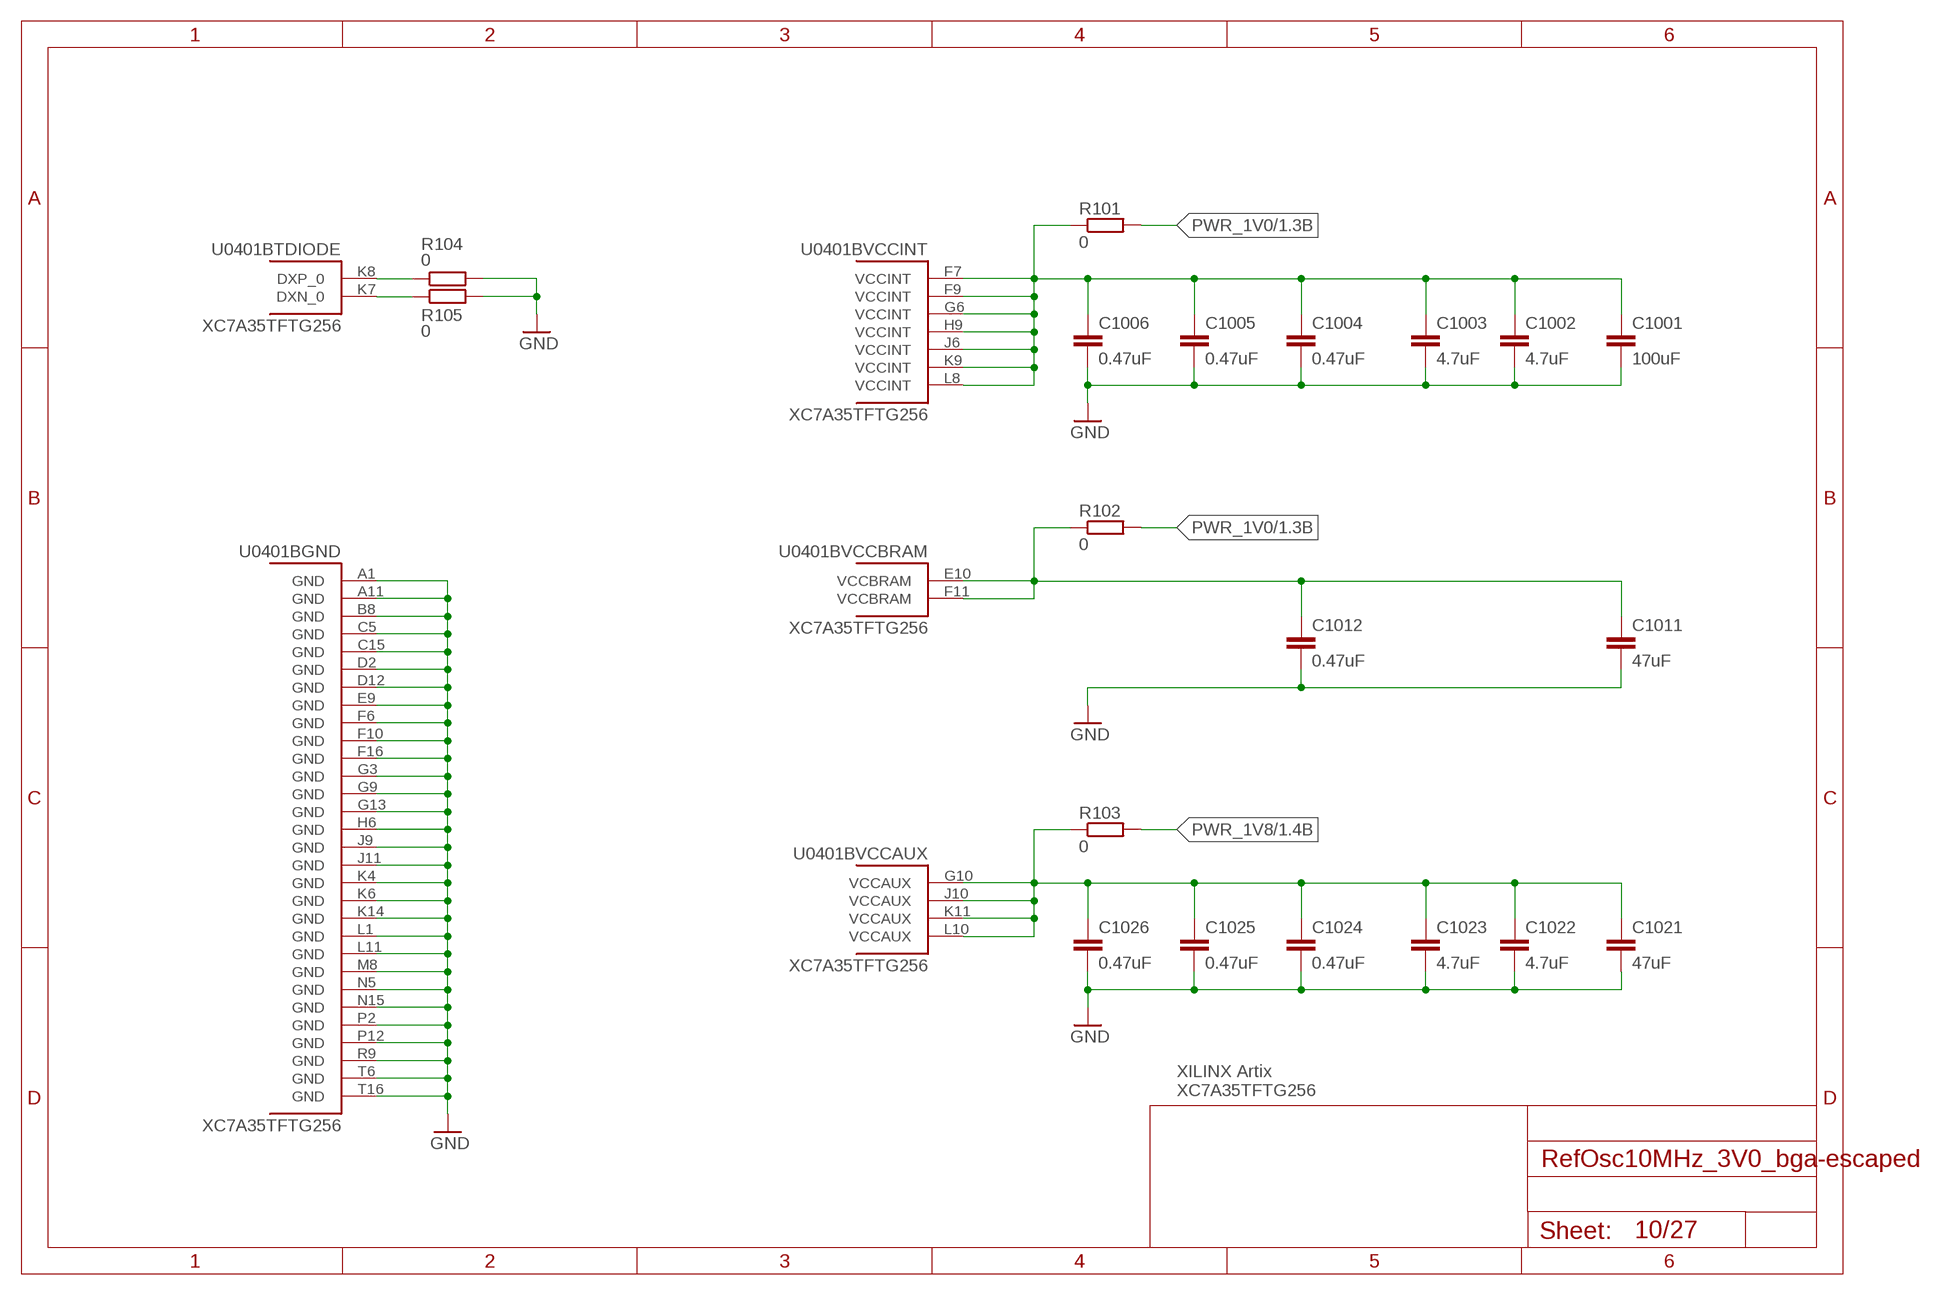
[diagram p9: schematic, sheet 10]

### Parts
C1001  100uF  C-EUC1206  [C1206]
C1002  4.7uF  C-EUC0402  [C0402]
C1003  4.7uF  C-EUC0402  [C0402]
C1004  0.47uF  C-EUC0402  [C0402]
C1005  0.47uF  C-EUC0402  [C0402]
C1006  0.47uF  C-EUC0402  [C0402]
C1011  47uF  C-EUC0805  [C0805]
C1012  0.47uF  C-EUC0402  [C0402]
C1021  47uF  C-EUC0805  [C0805]
C1022  4.7uF  C-EUC0402  [C0402]
C1023  4.7uF  C-EUC0402  [C0402]
C1024  0.47uF  C-EUC0402  [C0402]
C1025  0.47uF  C-EUC0402  [C0402]
C1026  0.47uF  C-EUC0402  [C0402]
R101  0  R-EU_R0402  [R0402]
R102  0  R-EU_R0402  [R0402]
R103  0  R-EU_R0402  [R0402]
R104  0  R-EU_R0402  [R0402]
R105  0  R-EU_R0402  [R0402]

### Nets
FPGA_DXN_0: R105.1 U0401.K7(BTDIODE:DXN_0)
FPGA_DXP_0: R104.1 U0401.K8(BTDIODE:DXP_0)
FPGA_VCCAUX: C1021.1 C1022.1 C1023.1 C1024.1 C1025.1 C1026.1 R103.1 U0401.G10(BVCCAUX:VCCAUX) U0401.J10(BVCCAUX:VCCAUX) U0401.K11(BVCCAUX:VCCAUX) U0401.L10(BVCCAUX:VCCAUX)
FPGA_VCCBRAM: C1011.1 C1012.1 R102.1 U0401.E10(BVCCBRAM:VCCBRAM) U0401.F11(BVCCBRAM:VCCBRAM)
FPGA_VCCINT: C1001.1 C1002.1 C1003.1 C1004.1 C1005.1 C1006.1 R101.1 U0401.F7(BVCCINT:VCCINT) U0401.F9(BVCCINT:VCCINT) U0401.G6(BVCCINT:VCCINT) U0401.H9(BVCCINT:VCCINT) U0401.J6(BVCCINT:VCCINT) U0401.K9(BVCCINT:VCCINT) U0401.L8(BVCCINT:VCCINT)
GND: C1001.2 C1002.2 C1003.2 C1004.2 C1005.2 C1006.2 C1011.2 C1012.2 C1021.2 C1022.2 C1023.2 C1024.2 C1025.2 C1026.2 R104.2 R105.2 U0401.A1(BGND:GND) U0401.A11(BGND:GND) U0401.B8(BGND:GND) U0401.C5(BGND:GND) U0401.C15(BGND:GND) U0401.D2(BGND:GND) U0401.D12(BGND:GND) U0401.E9(BGND:GND) U0401.F6(BGND:GND) U0401.F10(BGND:GND) U0401.F16(BGND:GND) U0401.G3(BGND:GND) U0401.G9(BGND:GND) U0401.G13(BGND:GND) U0401.H6(BGND:GND) U0401.J9(BGND:GND) U0401.J11(BGND:GND) U0401.K4(BGND:GND) U0401.K6(BGND:GND) U0401.K14(BGND:GND) U0401.L1(BGND:GND) U0401.L11(BGND:GND) U0401.M8(BGND:GND) U0401.N5(BGND:GND) U0401.N15(BGND:GND) U0401.P2(BGND:GND) U0401.P12(BGND:GND) U0401.R9(BGND:GND) U0401.T6(BGND:GND) U0401.T16(BGND:GND) ; also sheet 1,2,3,4,5,6,7,8,9,11,14,15,18,19
PWR_1V0 [PWR_LOW]: R101.2 R102.2 ; also sheet 1,2
PWR_1V8 [PWR_LOW]: R103.2 ; also sheet 1,2

### Notes on the sheet
- XILINX Artix
  XC7A35TFTG256

## Sheet 11 of 27: FLASH
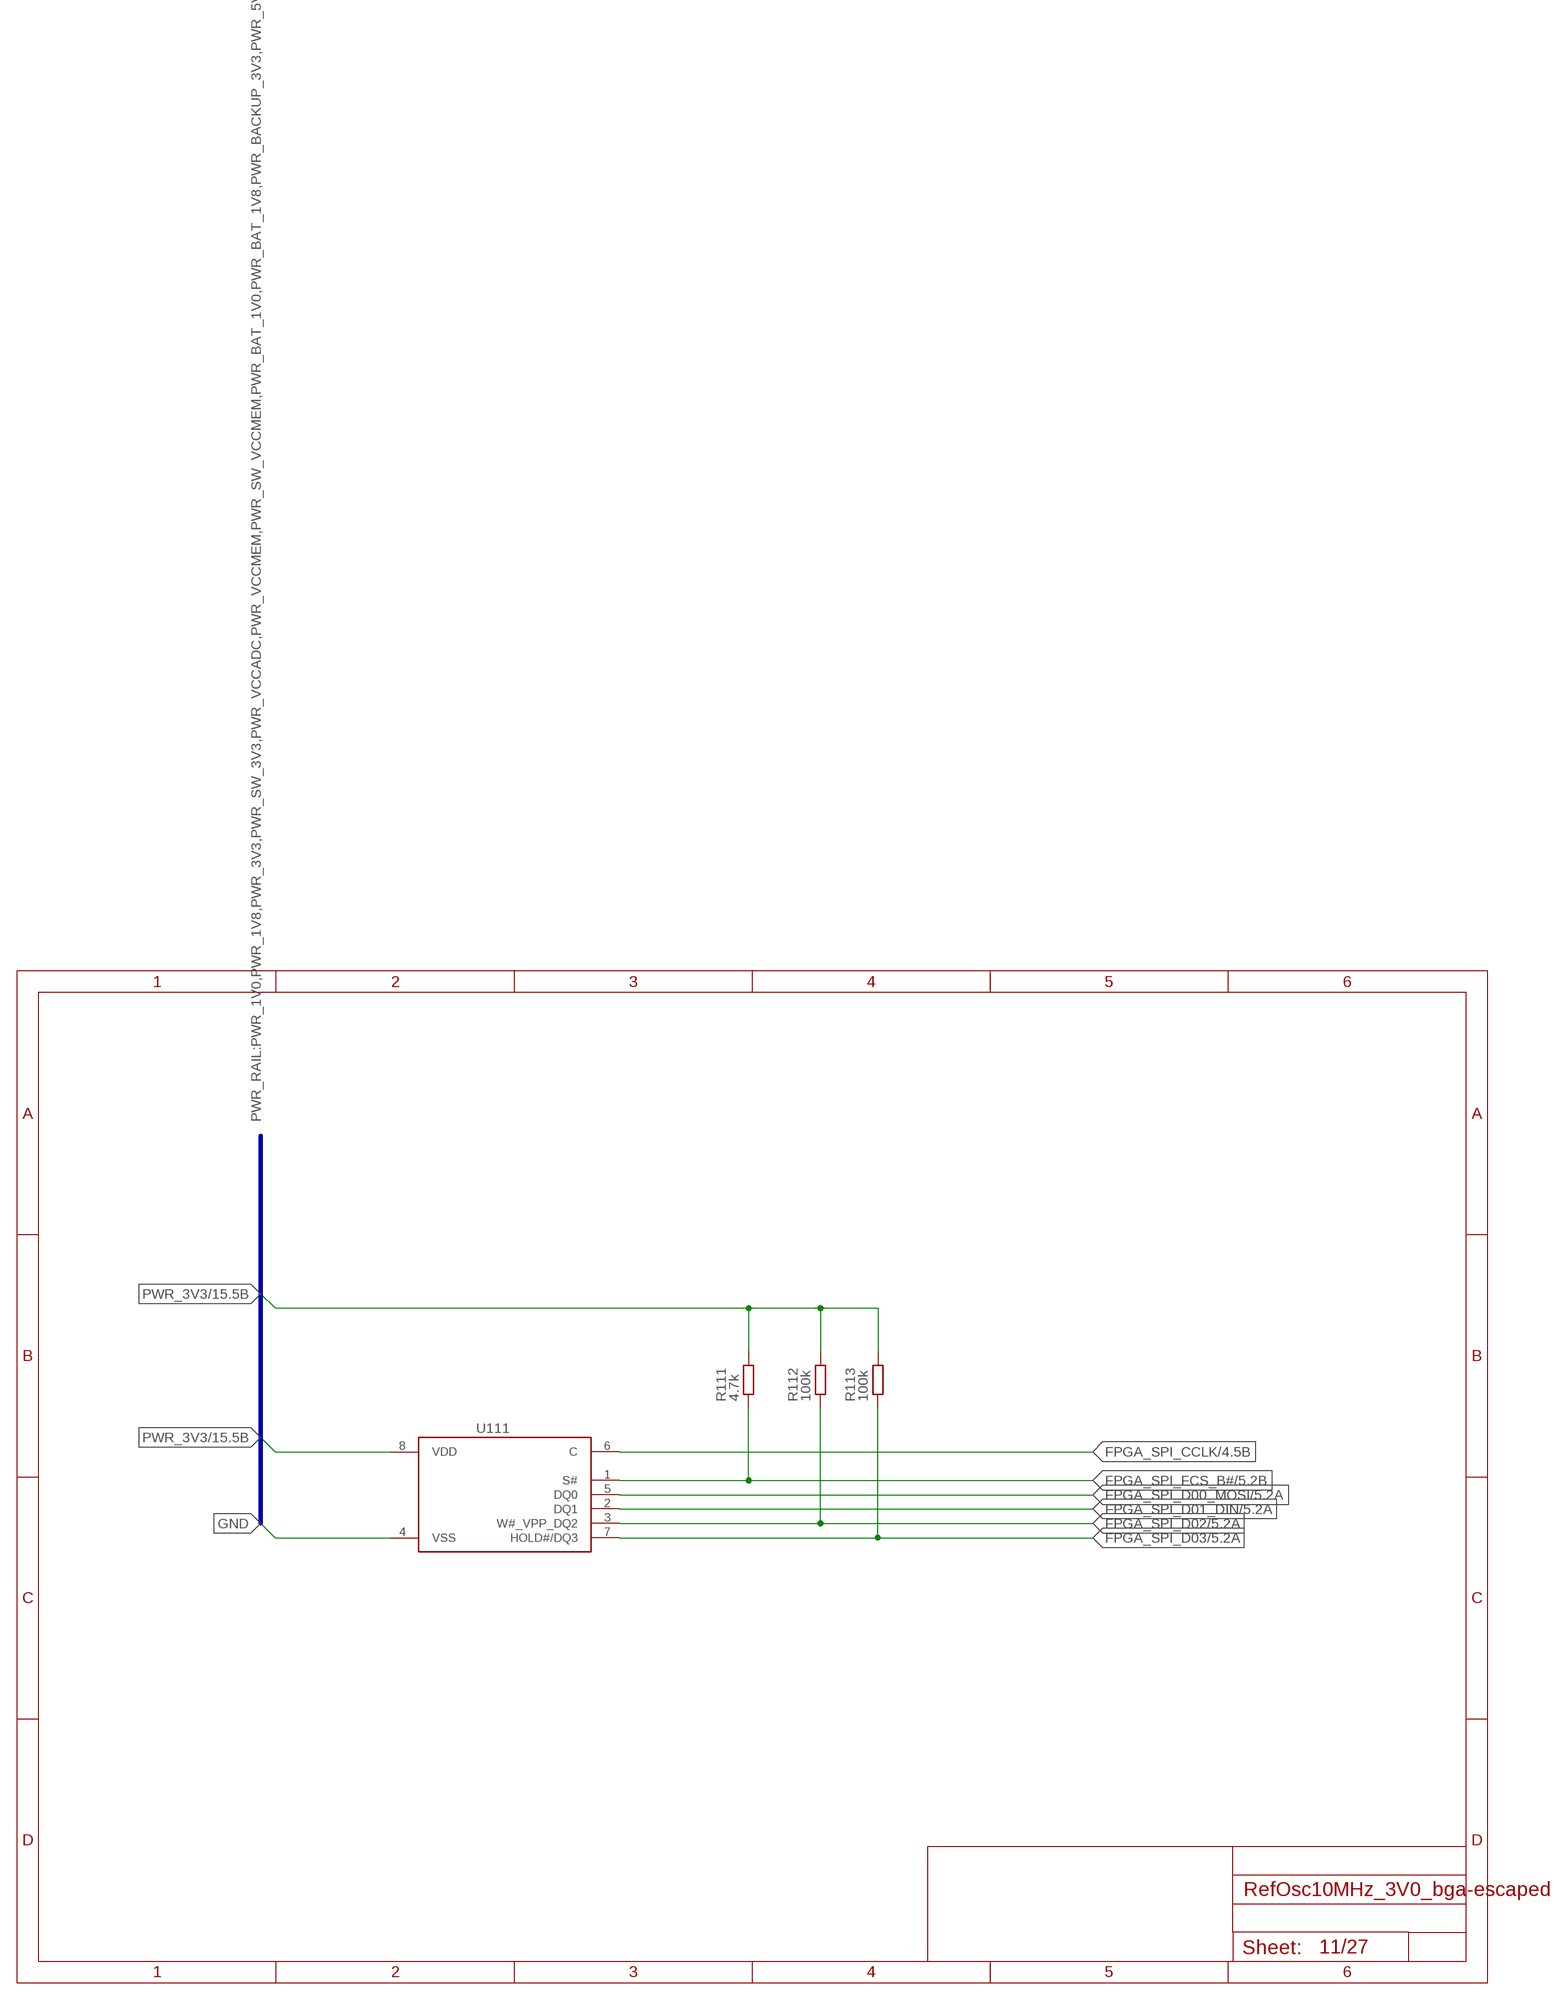
[diagram p10: schematic, sheet 11]

### Parts
R111  4.7k  R-EU_R0805  [R0805]
R112  100k  R-EU_R0805  [R0805]
R113  100k  R-EU_R0805  [R0805]
U111  N25Q128A13ESE40F  [SOP2-8]

### Nets
FPGA_SPI_CCLK: U111.6(C) ; also sheet 4
FPGA_SPI_D00_MOSI: U111.5(DQ0) ; also sheet 5
FPGA_SPI_D01_DIN: U111.2(DQ1) ; also sheet 5
FPGA_SPI_D02: R112.1 U111.3(W#_VPP_DQ2) ; also sheet 5
FPGA_SPI_D03: R113.1 U111.7(HOLD#/DQ3) ; also sheet 5
FPGA_SPI_FCS_B#: R111.1 U111.1(S#) ; also sheet 5
GND: U111.4(VSS) ; also sheet 1,2,3,4,5,6,7,8,9,10,14,15,18,19
PWR_3V3 [PWR_MED]: R111.2 R112.2 R113.2 U111.8(VDD) ; also sheet 1,2,3,4,5,6,7,8,15

### Buses
PWR_RAIL:PWR_1V0,PWR_1V8,PWR_3V3,PWR_SW_3V3,PWR_VCCADC,PWR_VCCMEM,PWR_SW_VCCMEM,PWR_BAT_1V0,PWR_BAT_1V8,PWR_BACKUP_3V3,PWR_5V0,PWR_SW_5V0,GND

## Sheet 12 of 27: SDRAM
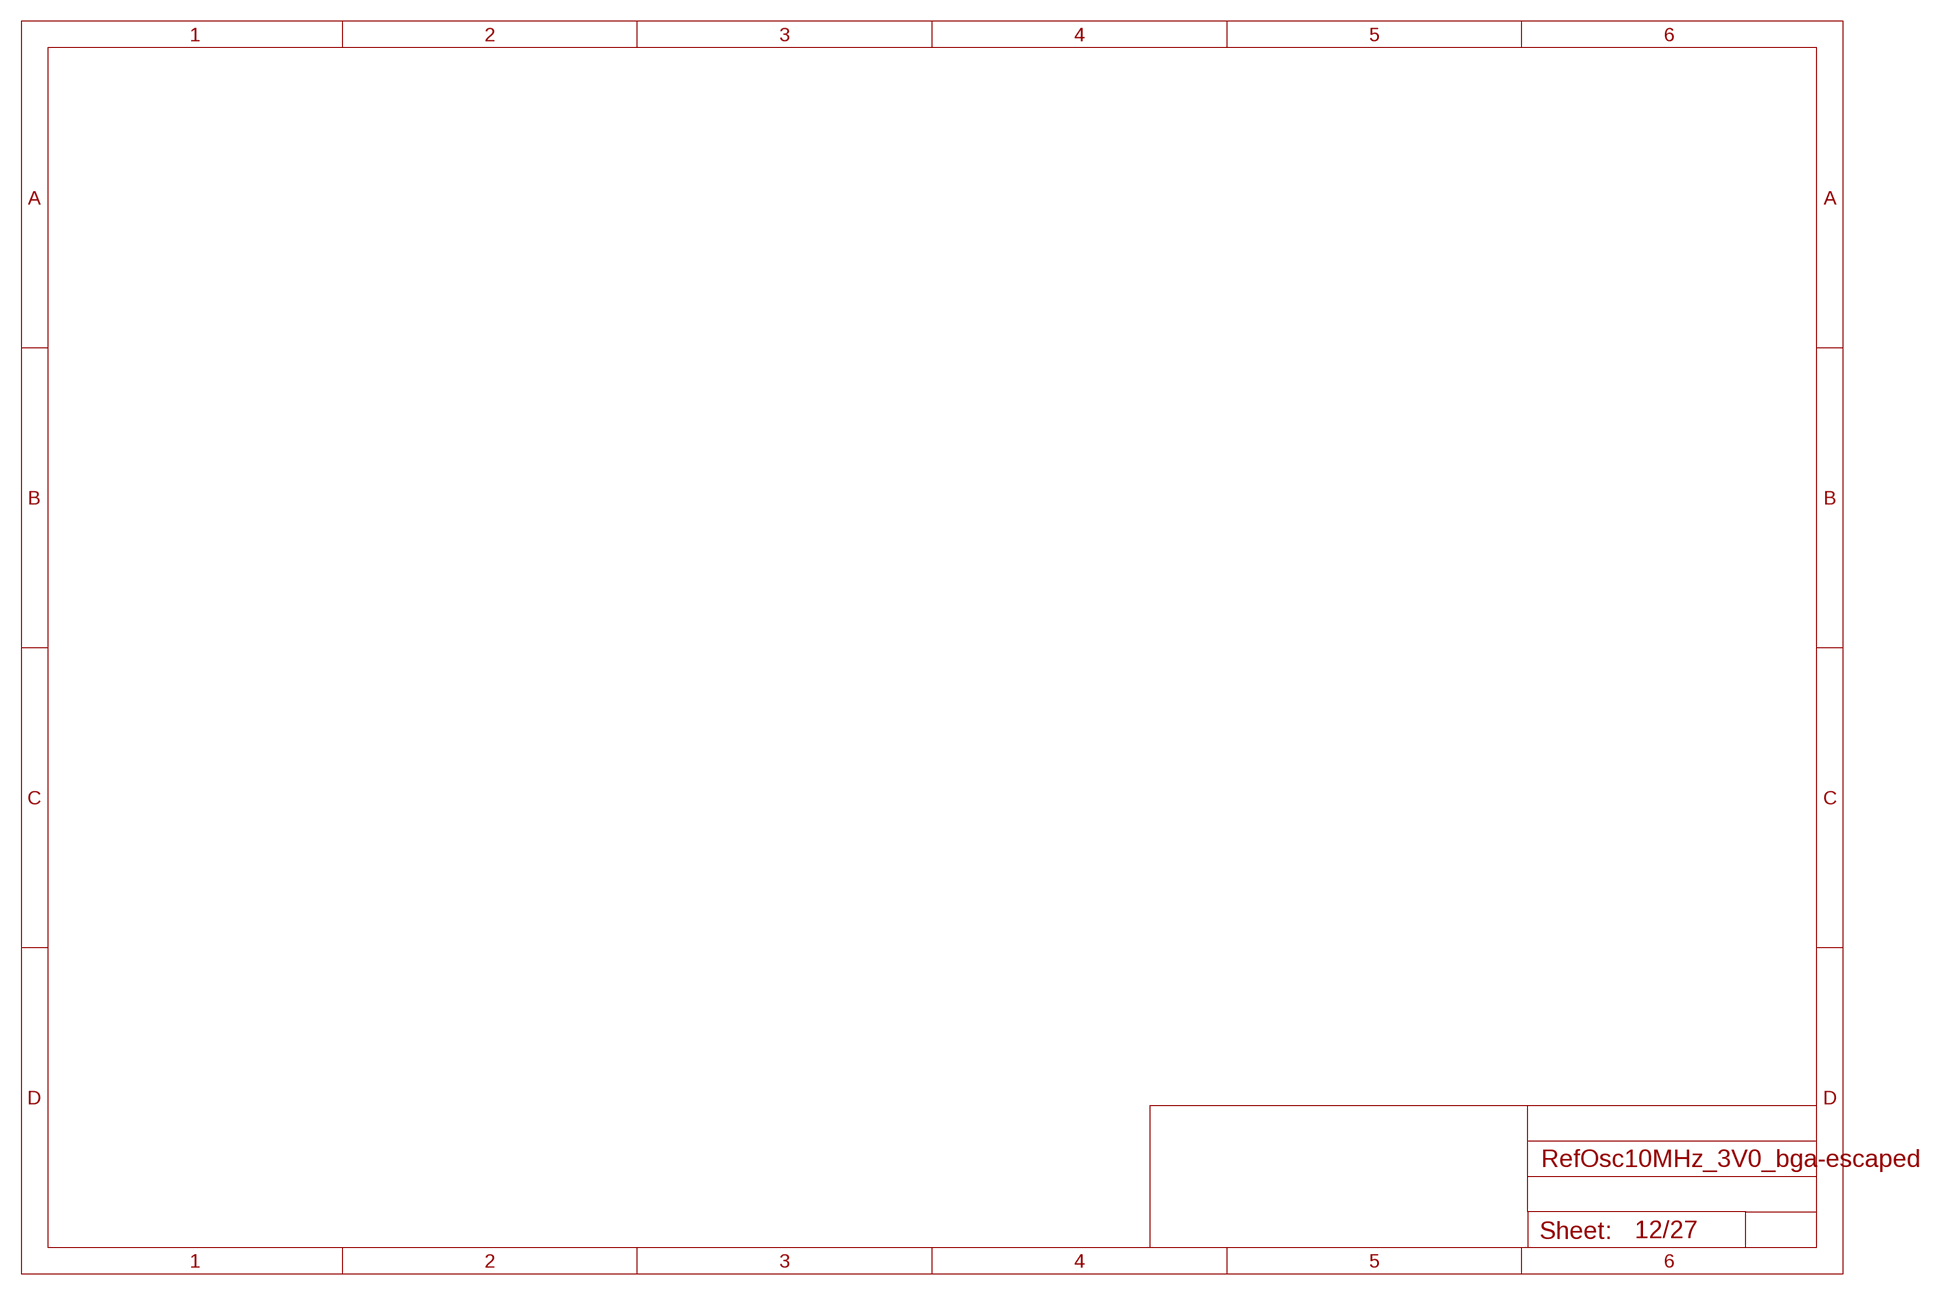
[diagram p11: schematic, sheet 12]

## Sheet 13 of 27: Ethernet
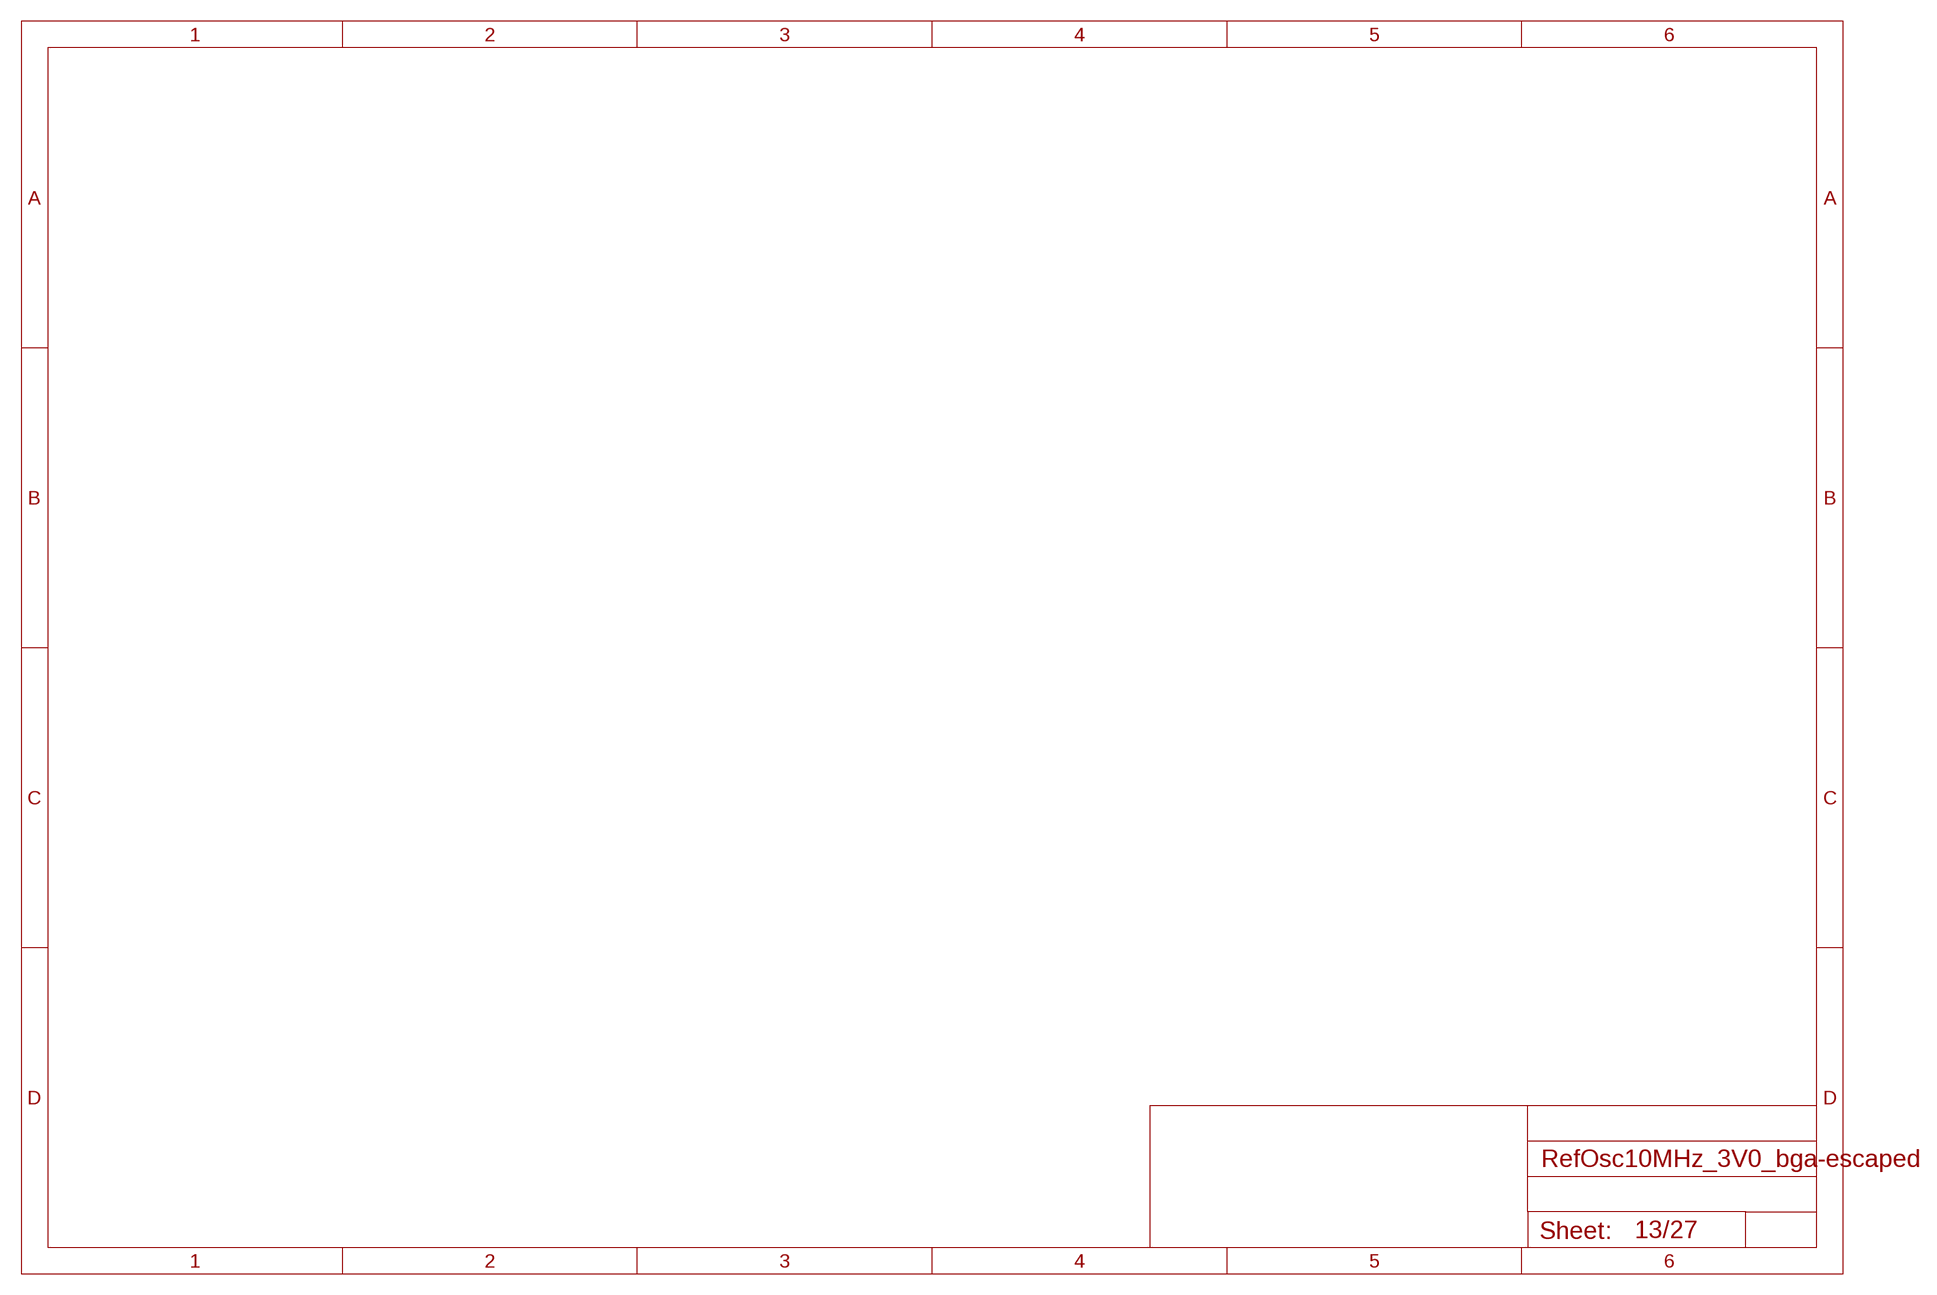
[diagram p12: schematic, sheet 13]

## Sheet 14 of 27: USB
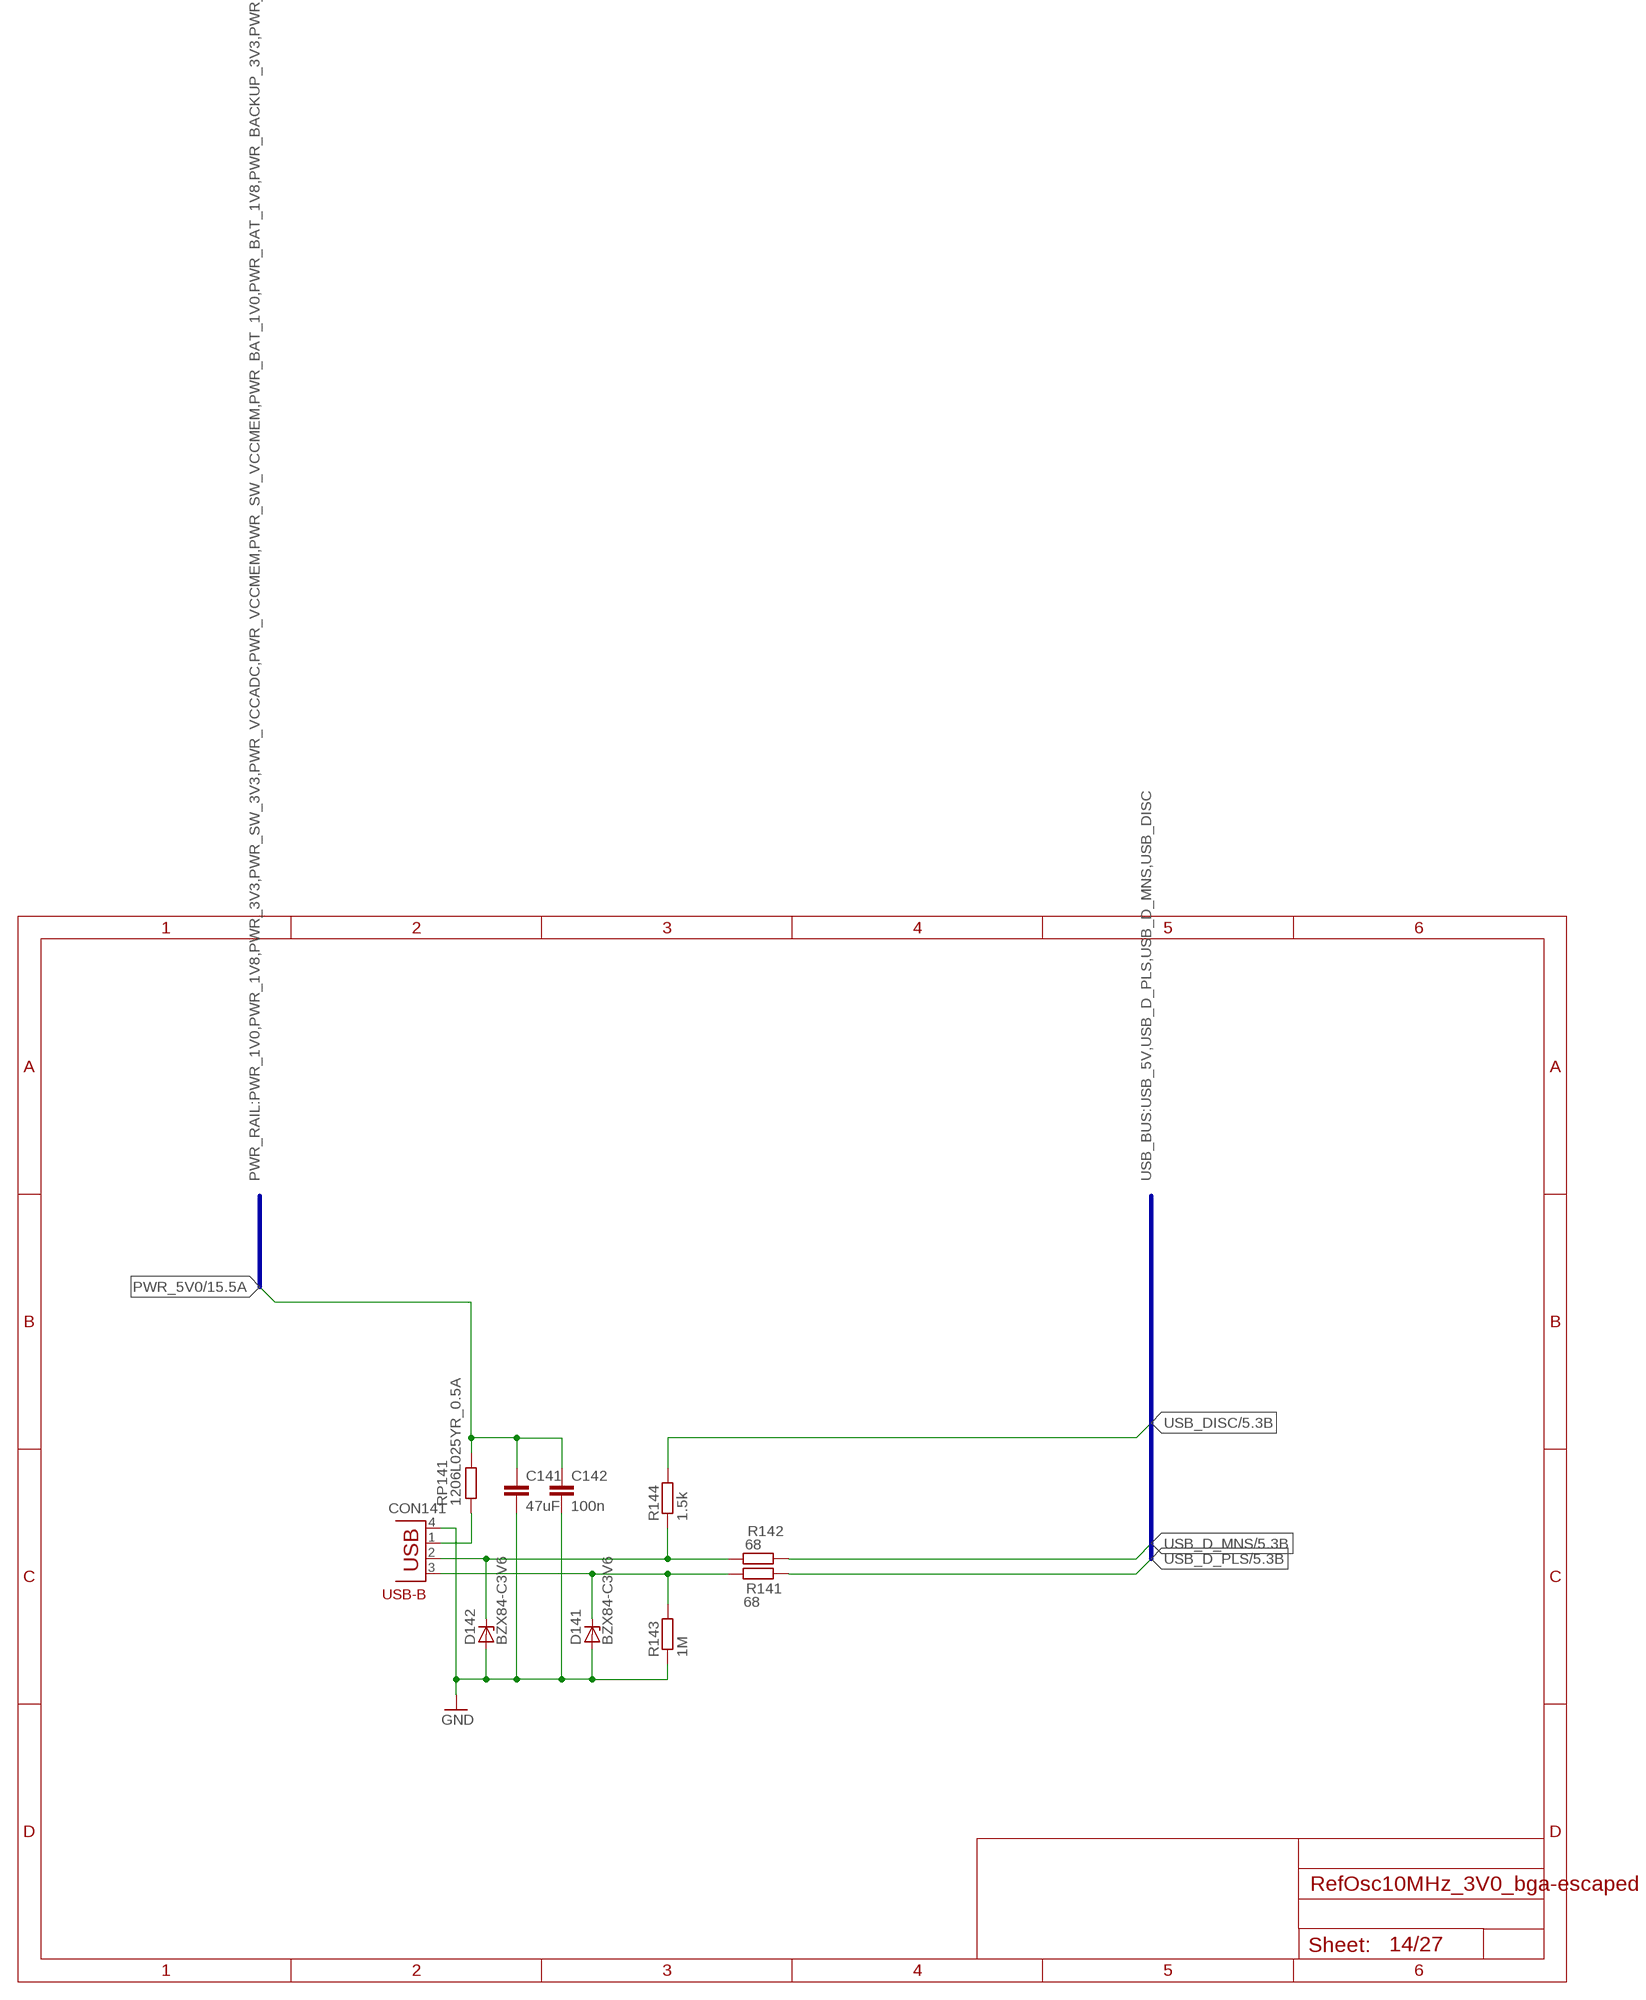
[diagram p13: schematic, sheet 14]

### Parts
C141  47uF  C-EUC0805  [C0805]
C142  100n  C-EUC0805  [C0805]
CON141  TYCO-AMP_USBUSB-B_SMT  [TYCO-AMP_USB-B_SMT]
D141  BZX84-C3V6  BZX84CSMD  [TO236]
D142  BZX84-C3V6  BZX84CSMD  [TO236]
R141  68  R-EU_R0805  [R0805]
R142  68  R-EU_R0805  [R0805]
R143  1M  R-EU_R0805  [R0805]
R144  1.5k  R-EU_R0805  [R0805]
RP141  1206L025YR_0.5A  R-EU_M1206  [M1206]

### Nets
GND: C141.2 C142.2 CON141.4(GND) D141.A D142.A R143.1 ; also sheet 1,2,3,4,5,6,7,8,9,10,11,15,18,19
PWR_5V0: C141.1 C142.1 RP141.2 ; also sheet 1,2,5,15,18
USB_D_MIN1: CON141.2(D-) D142.C R142.1 R144.1
USB_D_MNS: R142.2 ; also sheet 5
USB_D_PLS: R141.2 ; also sheet 5
USB_D_PLS1: CON141.3(D+) D141.C R141.1 R143.2
USB_DISC: R144.2 ; also sheet 5
USB_PWR1: CON141.1(VBUS) RP141.1

### Buses
USB_BUS:USB_5V,USB_D_PLS,USB_D_MNS,USB_DISC
PWR_RAIL:PWR_1V0,PWR_1V8,PWR_3V3,PWR_SW_3V3,PWR_VCCADC,PWR_VCCMEM,PWR_SW_VCCMEM,PWR_BAT_1V0,PWR_BAT_1V8,PWR_BACKUP_3V3,PWR_5V0,PWR_SW_5V0,GND

### Notes on the sheet
- USB-B

## Sheet 15 of 27: GPS
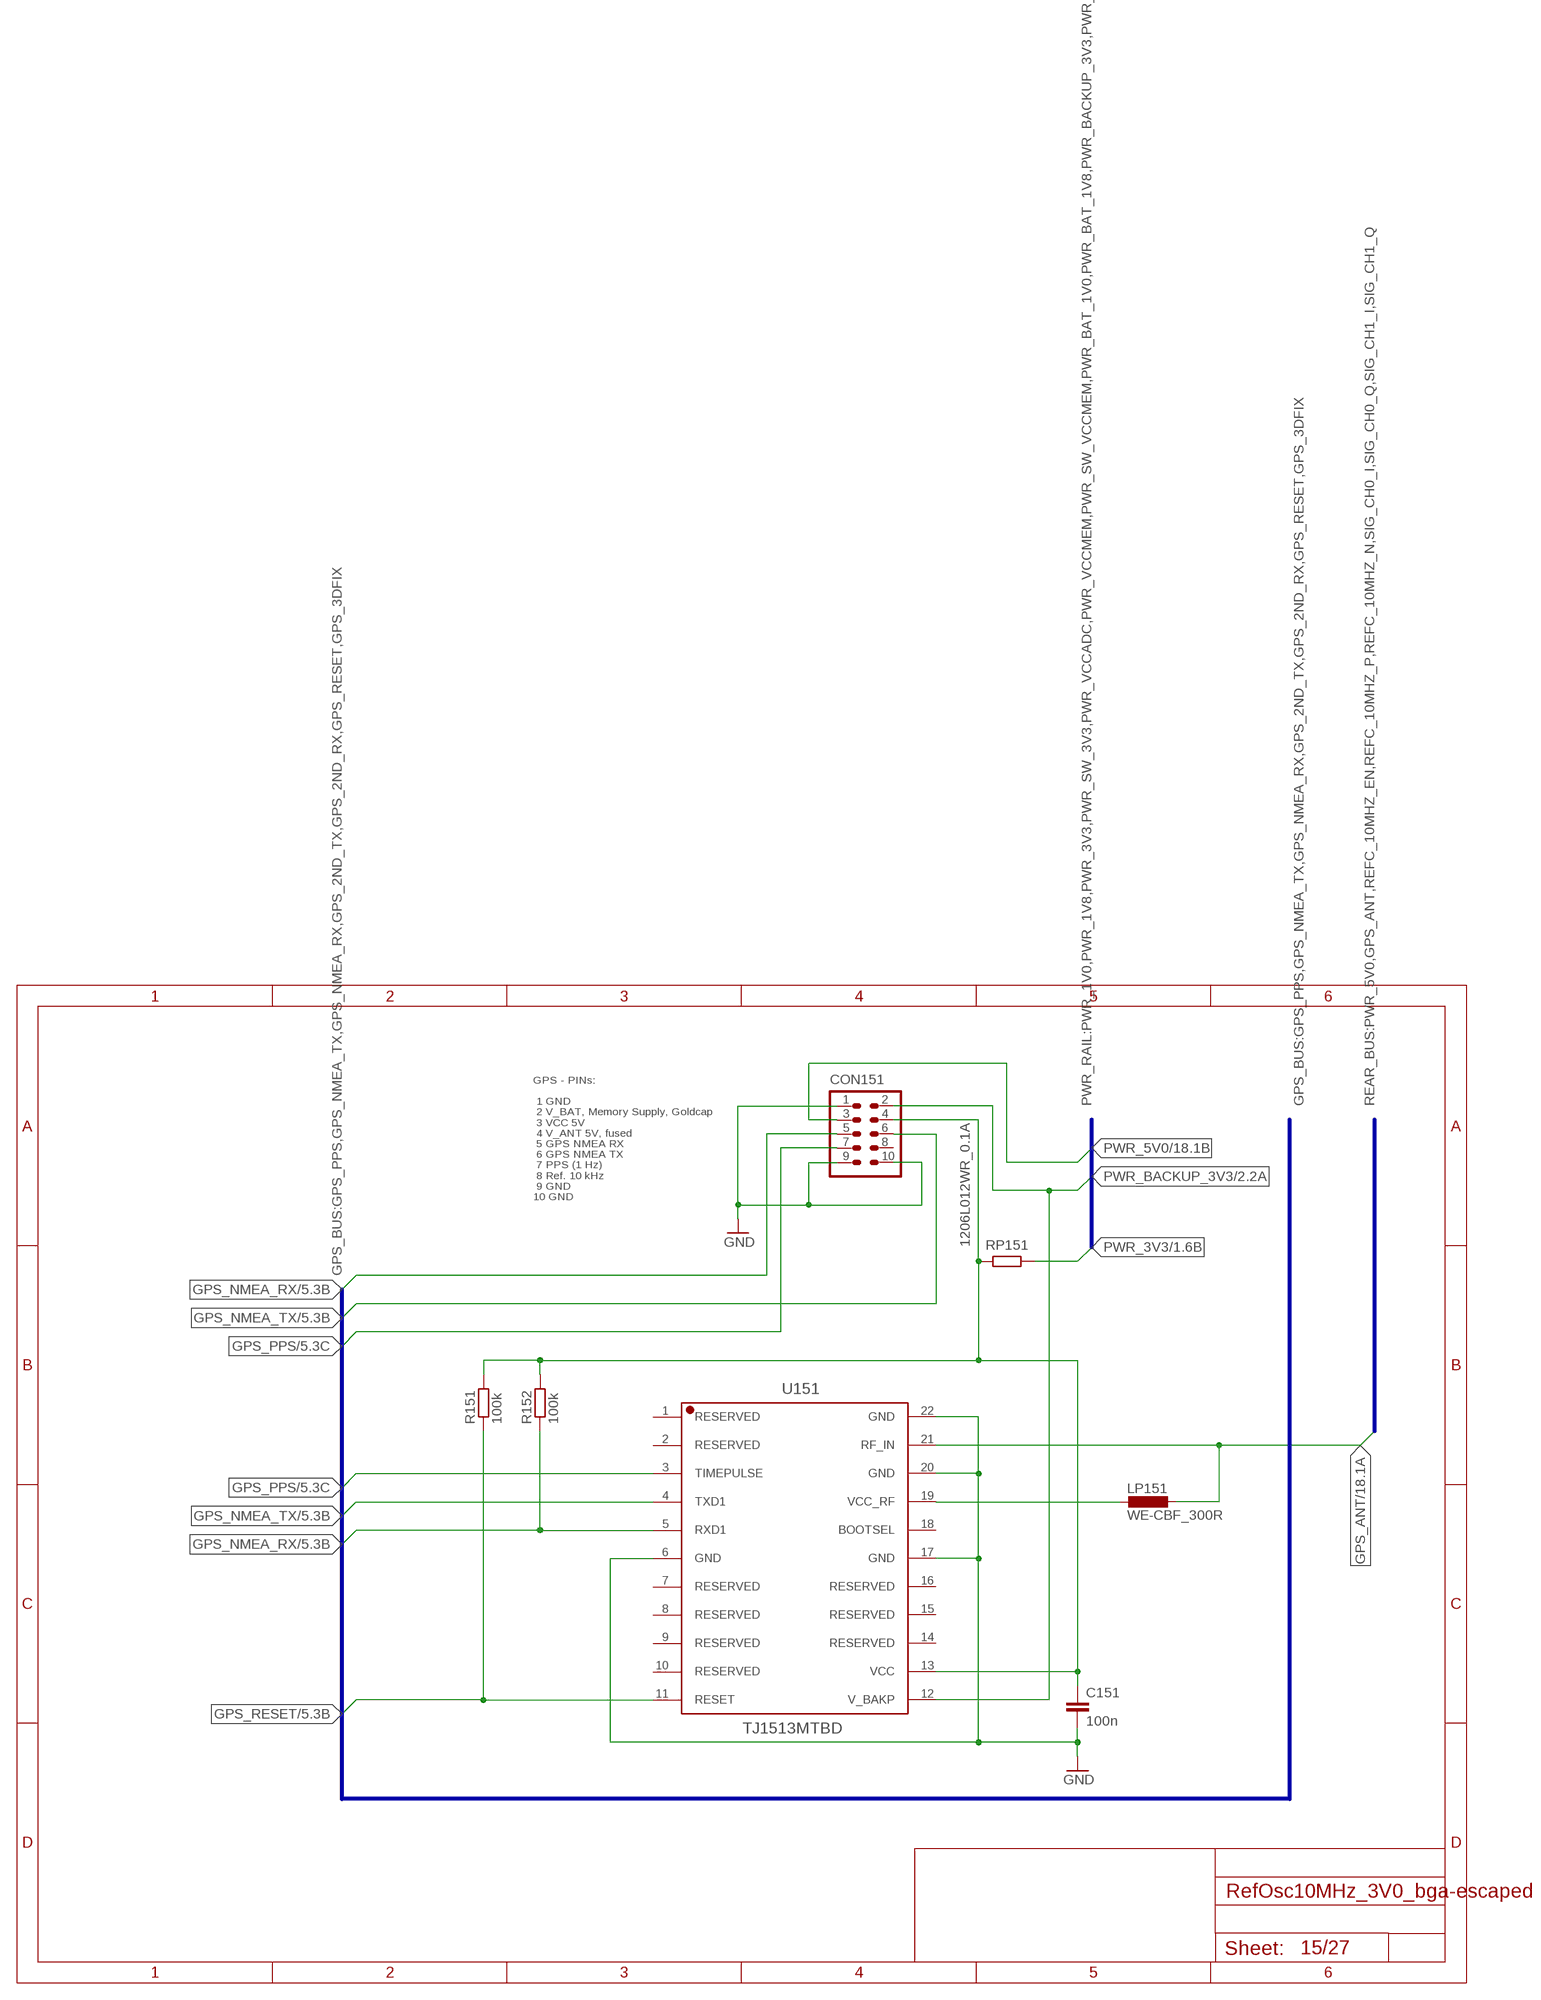
[diagram p14: schematic, sheet 15]

### Parts
C151  100n  C-EUC0805  [C0805]
CON151  HEADER-2X5SMD  [2X5SMD]
LP151  WE-CBF_300R  L-EUL3216C  [L3216C]
R151  100k  R-EU_R0805  [R0805]
R152  100k  R-EU_R0805  [R0805]
RP151  1206L012WR_0.1A  R-EU_M1206  [M1206]
U151  TJ1513MTBD  [TJ1513MTBD]

### Nets
GND: C151.2 CON151.1 CON151.9 CON151.10 U151.6(GND) U151.17(GND) U151.20(GND) U151.22(GND) ; also sheet 1,2,3,4,5,6,7,8,9,10,11,14,18,19
GPS_ANT: LP151.1 U151.21(RF_IN) ; also sheet 18
GPS_NMEA_RX: CON151.5 R152.1 U151.5(RXD1) ; also sheet 5
GPS_NMEA_TX: CON151.6 U151.4(TXD1) ; also sheet 5
GPS_PPS: CON151.7 U151.3(TIMEPULSE) ; also sheet 5
GPS_PWR_3V3 [PWR_MED]: C151.1 CON151.4 R151.2 R152.2 RP151.2 U151.13(VCC)
GPS_RESET: R151.1 U151.11(RESET) ; also sheet 5
N$9: LP151.2 U151.19(VCC_RF)
PWR_3V3 [PWR_MED]: RP151.1 ; also sheet 1,2,3,4,5,6,7,8,11
PWR_5V0: CON151.3 ; also sheet 1,2,5,14,18
PWR_BACKUP_3V3 [PWR_LOW]: CON151.2 U151.12(V_BAKP) ; also sheet 2
Unconnected: CON151.8 U151.1(RESERVED) U151.2(RESERVED) U151.7(RESERVED) U151.8(RESERVED) U151.9(RESERVED) U151.10(RESERVED) U151.14(RESERVED) U151.15(RESERVED) U151.16(RESERVED) U151.18(BOOTSEL)

### Buses
REAR_BUS:PWR_5V0,GPS_ANT,REFC_10MHZ_EN,REFC_10MHZ_P,REFC_10MHZ_N,SIG_CH0_I,SIG_CH0_Q,SIG_CH1_I,SIG_CH1_Q
GPS_BUS:GPS_PPS,GPS_NMEA_TX,GPS_NMEA_RX,GPS_2ND_TX,GPS_2ND_RX,GPS_RESET,GPS_3DFIX
PWR_RAIL:PWR_1V0,PWR_1V8,PWR_3V3,PWR_SW_3V3,PWR_VCCADC,PWR_VCCMEM,PWR_SW_VCCMEM,PWR_BAT_1V0,PWR_BAT_1V8,PWR_BACKUP_3V3,PWR_5V0,PWR_SW_5V0,GND

### Notes on the sheet
- GPS - PINs:
  
   1 GND
   2 V_BAT, Memory Supply, Goldcap
   3 VCC 5V
   4 V_ANT 5V, fused
   5 GPS NMEA RX
   6 GPS NMEA TX
   7 PPS (1 Hz)
   8 Ref. 10 kHz
   9 GND
  10 GND

## Sheet 16 of 27: LCD-Module
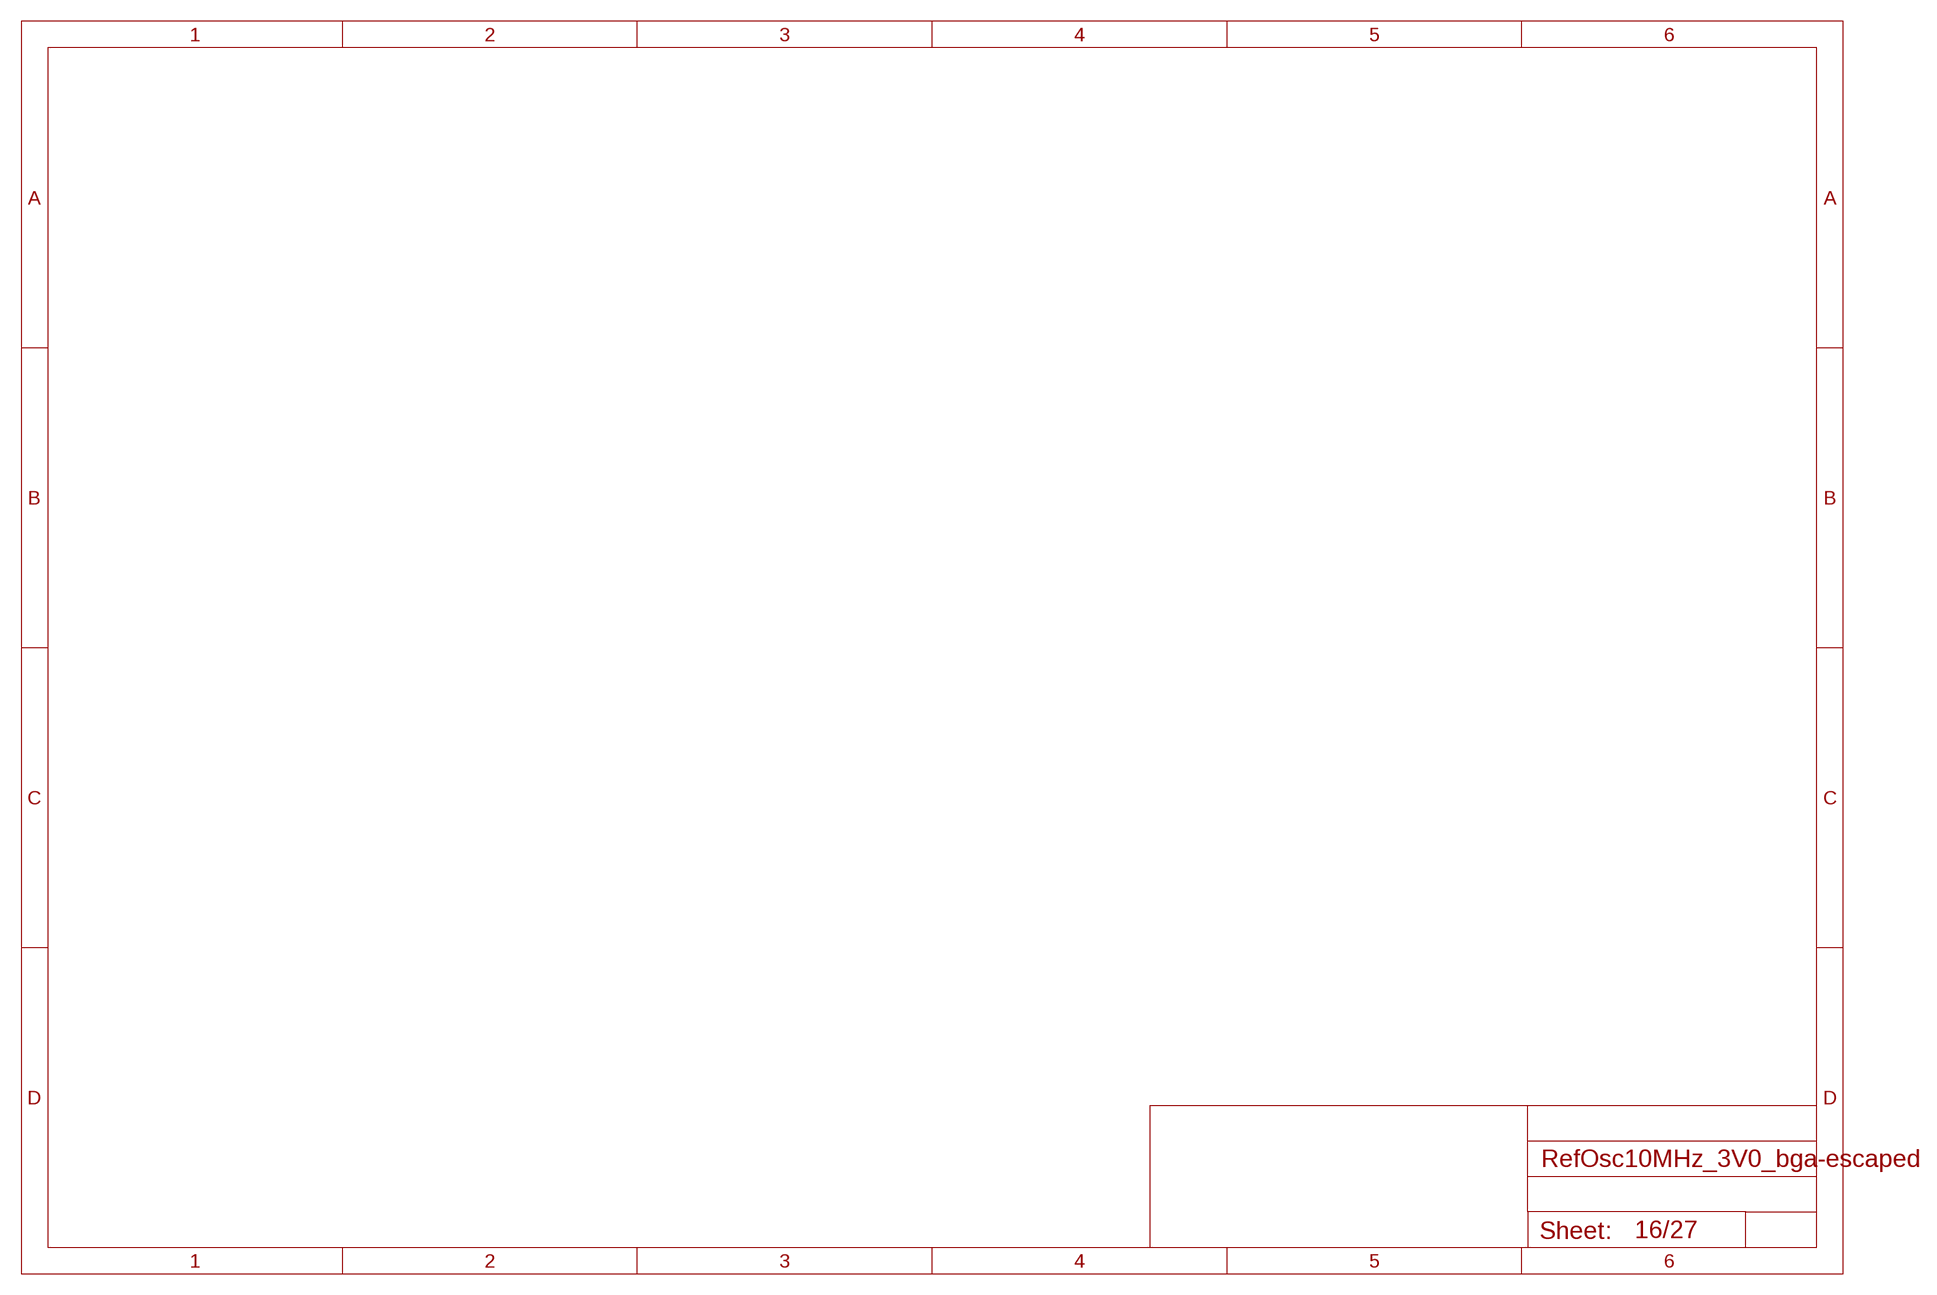
[diagram p15: schematic, sheet 16]

## Sheet 17 of 27: Controls
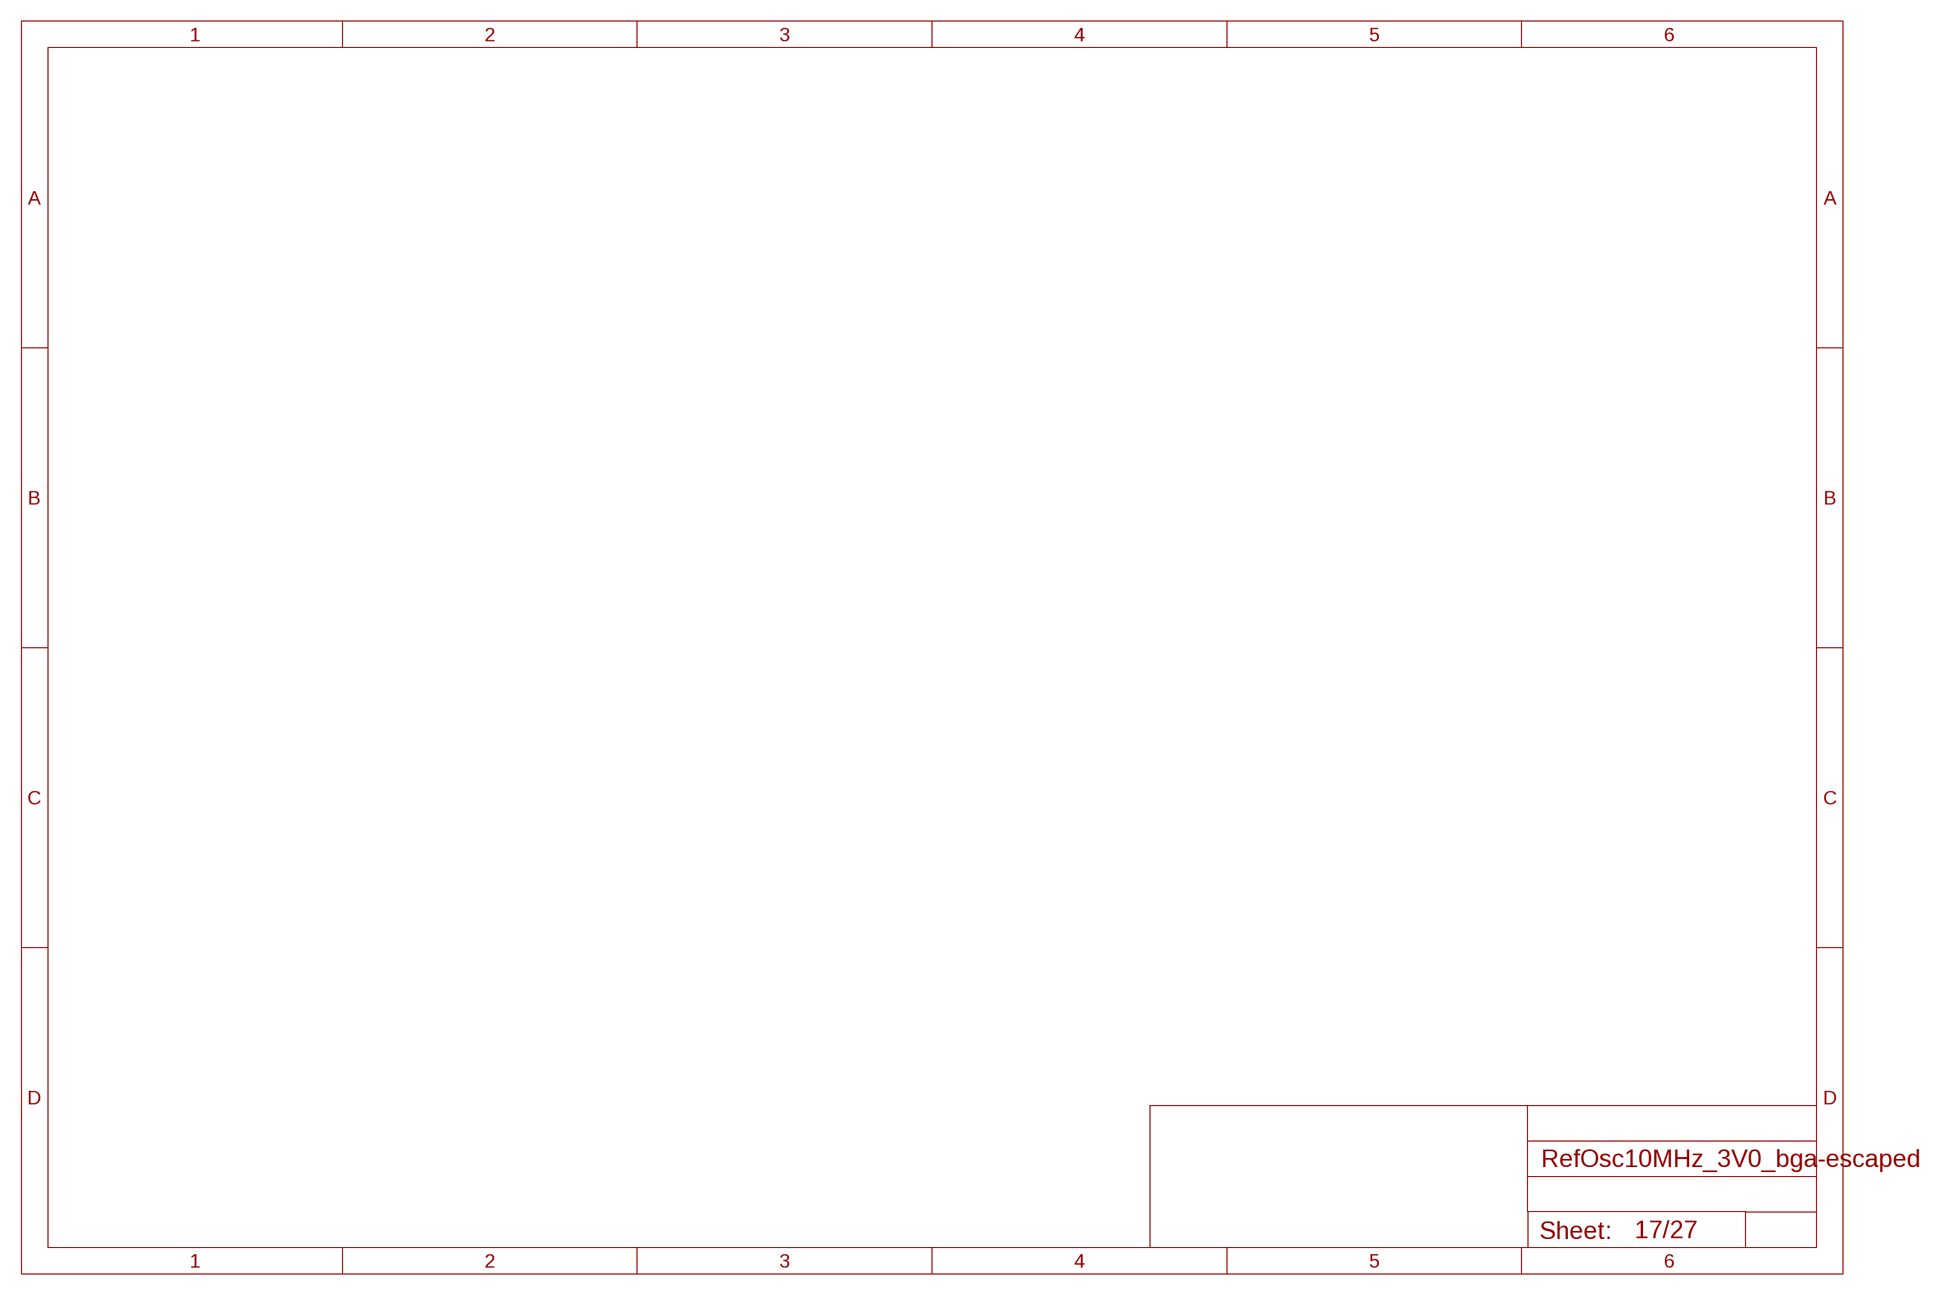
[diagram p16: schematic, sheet 17]

## Sheet 18 of 27: REAR
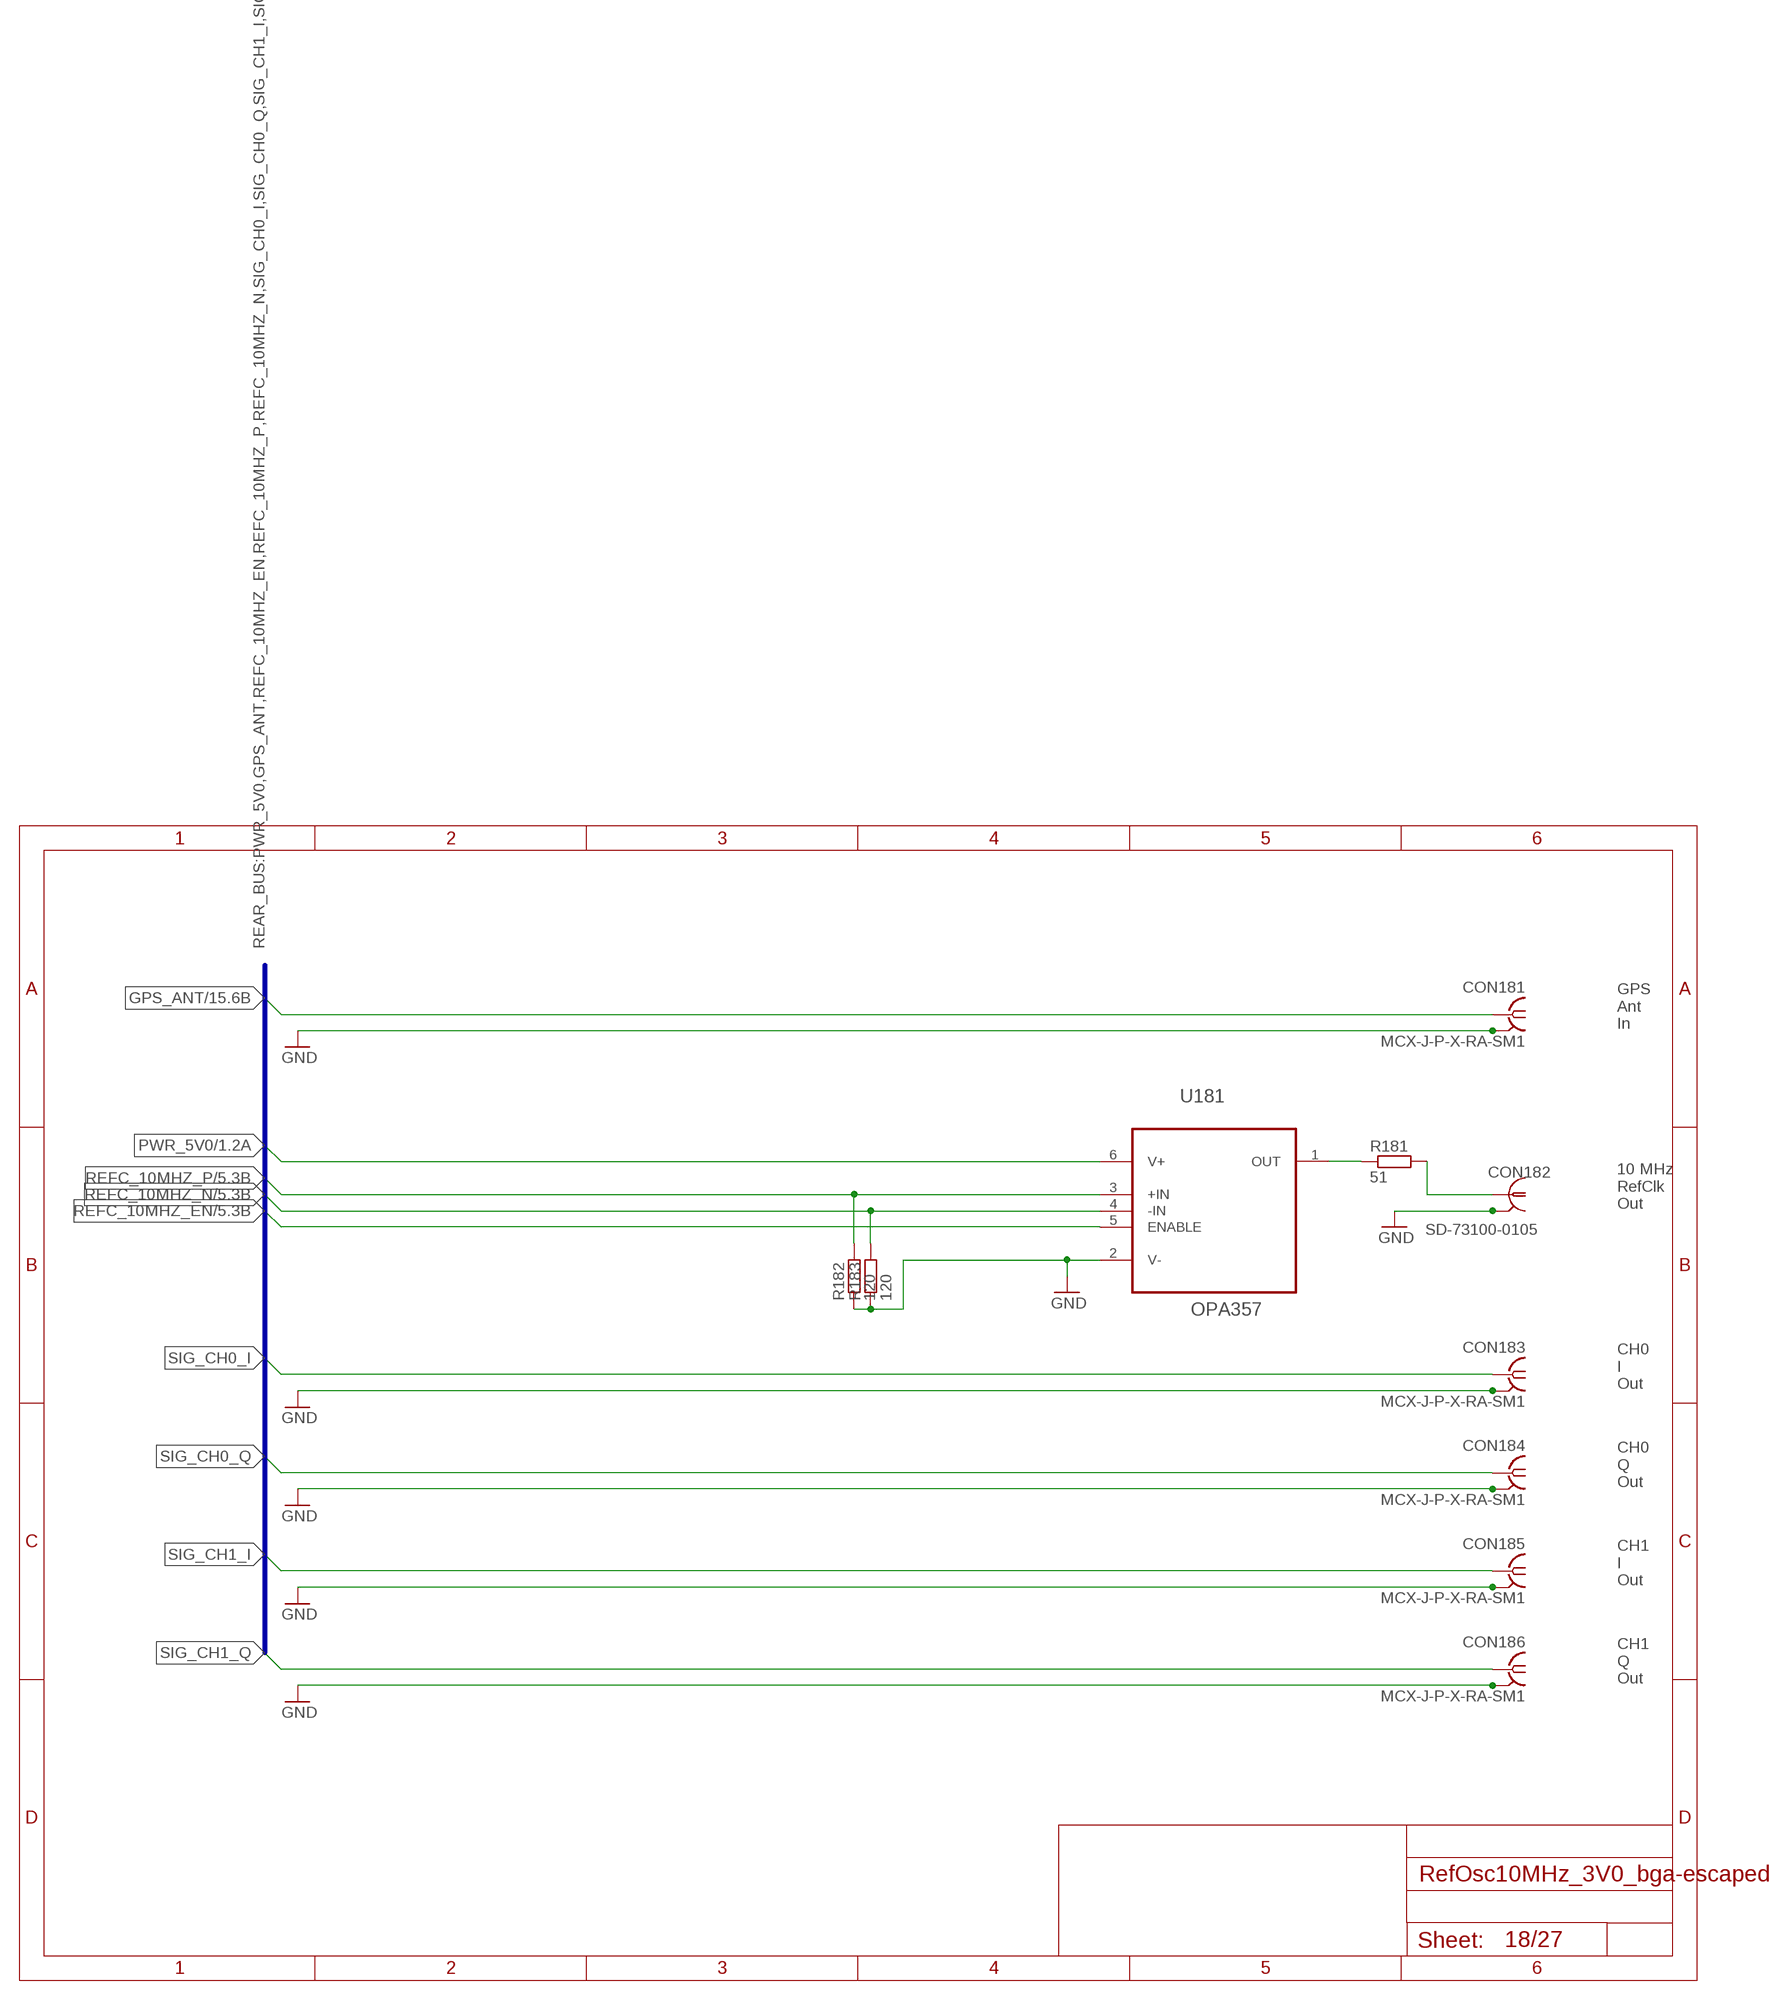
[diagram p17: schematic, sheet 18]

### Parts
CON181  MCX-J-P-X-RA-SM1  [MCX-J-P-X-RA-SM1]
CON182  SD-73100-0105  MOLEX_BNC-JACK-50R_SD-73100-0105  [MOLEX_BNC-JACK-50R_SD-73100-0105]
CON183  MCX-J-P-X-RA-SM1  [MCX-J-P-X-RA-SM1]
CON184  MCX-J-P-X-RA-SM1  [MCX-J-P-X-RA-SM1]
CON185  MCX-J-P-X-RA-SM1  [MCX-J-P-X-RA-SM1]
CON186  MCX-J-P-X-RA-SM1  [MCX-J-P-X-RA-SM1]
R181  51  R-EU_R0805  [R0805]
R182  120  R-EU_R0805  [R0805]
R183  120  R-EU_R0805  [R0805]
U181  OPA357  [SOT-23-6]

### Nets
GND: CON181.2 CON181.3 CON181.4 CON181.5 CON182.2 CON182.3 CON183.2 CON183.3 CON183.4 CON183.5 CON184.2 CON184.3 CON184.4 CON184.5 CON185.2 CON185.3 CON185.4 CON185.5 CON186.2 CON186.3 CON186.4 CON186.5 R182.1 R183.1 U181.2(V-) ; also sheet 1,2,3,4,5,6,7,8,9,10,11,14,15,19
GPS_ANT: CON181.1 ; also sheet 15
N$3: R181.1 U181.1(OUT)
N$4: CON182.1 R181.2
PWR_5V0: U181.6(V+) ; also sheet 1,2,5,14,15
REFC_10MHZ_EN: U181.5(ENABLE) ; also sheet 5
REFC_10MHZ_N: R183.2 U181.4(-IN) ; also sheet 5
REFC_10MHZ_P: R182.2 U181.3(+IN) ; also sheet 5
SIG_CH0_I: CON183.1
SIG_CH0_Q: CON184.1
SIG_CH1_I: CON185.1
SIG_CH1_Q: CON186.1

### Buses
REAR_BUS:PWR_5V0,GPS_ANT,REFC_10MHZ_EN,REFC_10MHZ_P,REFC_10MHZ_N,SIG_CH0_I,SIG_CH0_Q,SIG_CH1_I,SIG_CH1_Q

### Notes on the sheet
- GPS
  Ant
  In
- 10 MHz
  RefClk
  Out
- CH0
  I
  Out
- CH0
  Q
  Out
- CH1
  I
  Out
- CH1
  Q
  Out

## Sheet 19 of 27: Holes
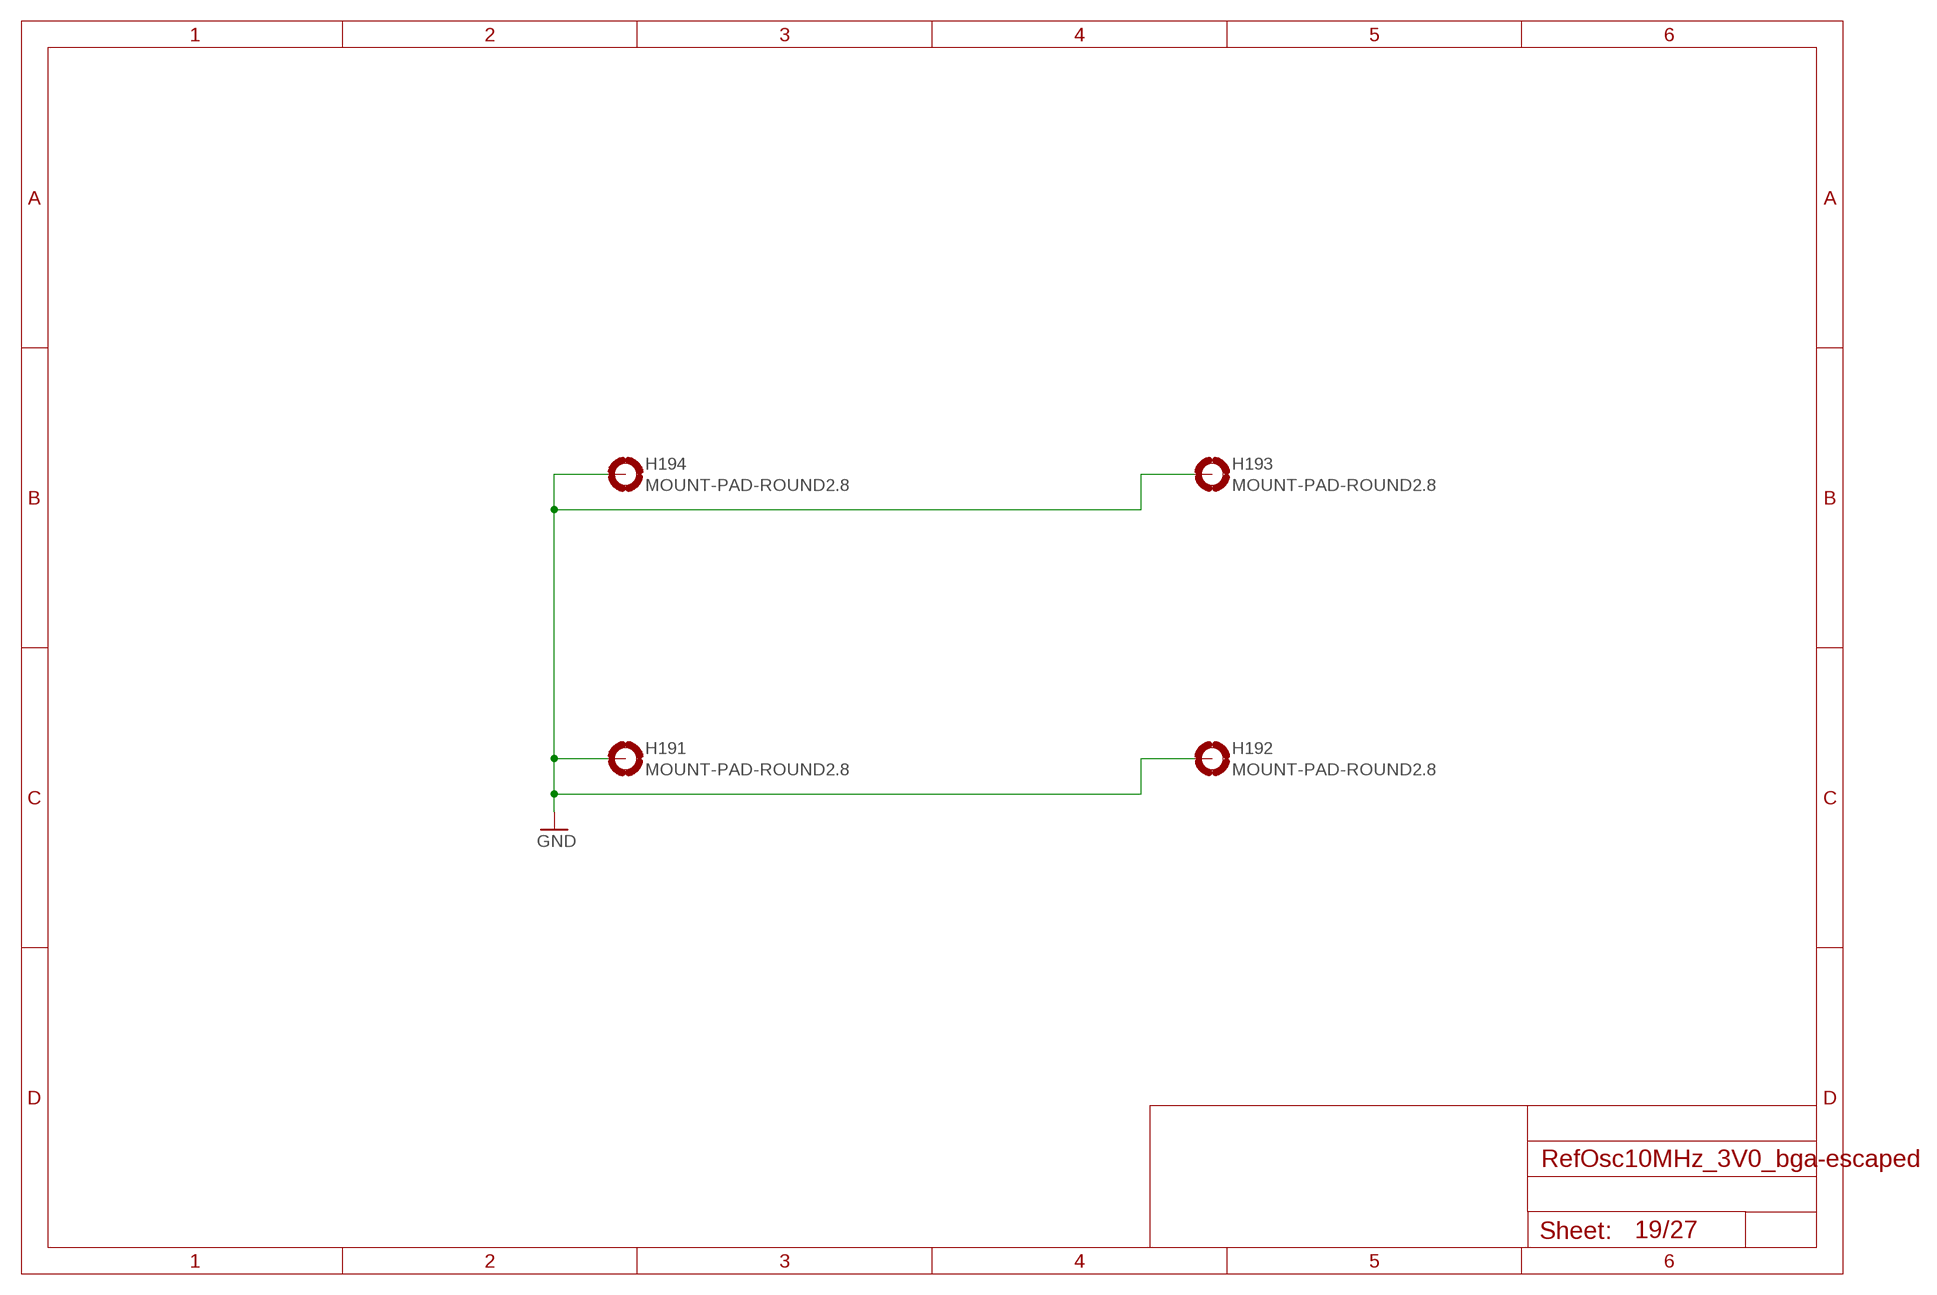
[diagram p18: schematic, sheet 19]

### Parts
H191  MOUNT-PAD-ROUND2.8  [2,8-PAD]
H192  MOUNT-PAD-ROUND2.8  [2,8-PAD]
H193  MOUNT-PAD-ROUND2.8  [2,8-PAD]
H194  MOUNT-PAD-ROUND2.8  [2,8-PAD]

### Nets
GND: H191.B2,8(MOUNT) H192.B2,8(MOUNT) H193.B2,8(MOUNT) H194.B2,8(MOUNT) ; also sheet 1,2,3,4,5,6,7,8,9,10,11,14,15,18

## Sheet 20 of 27: DAC #1
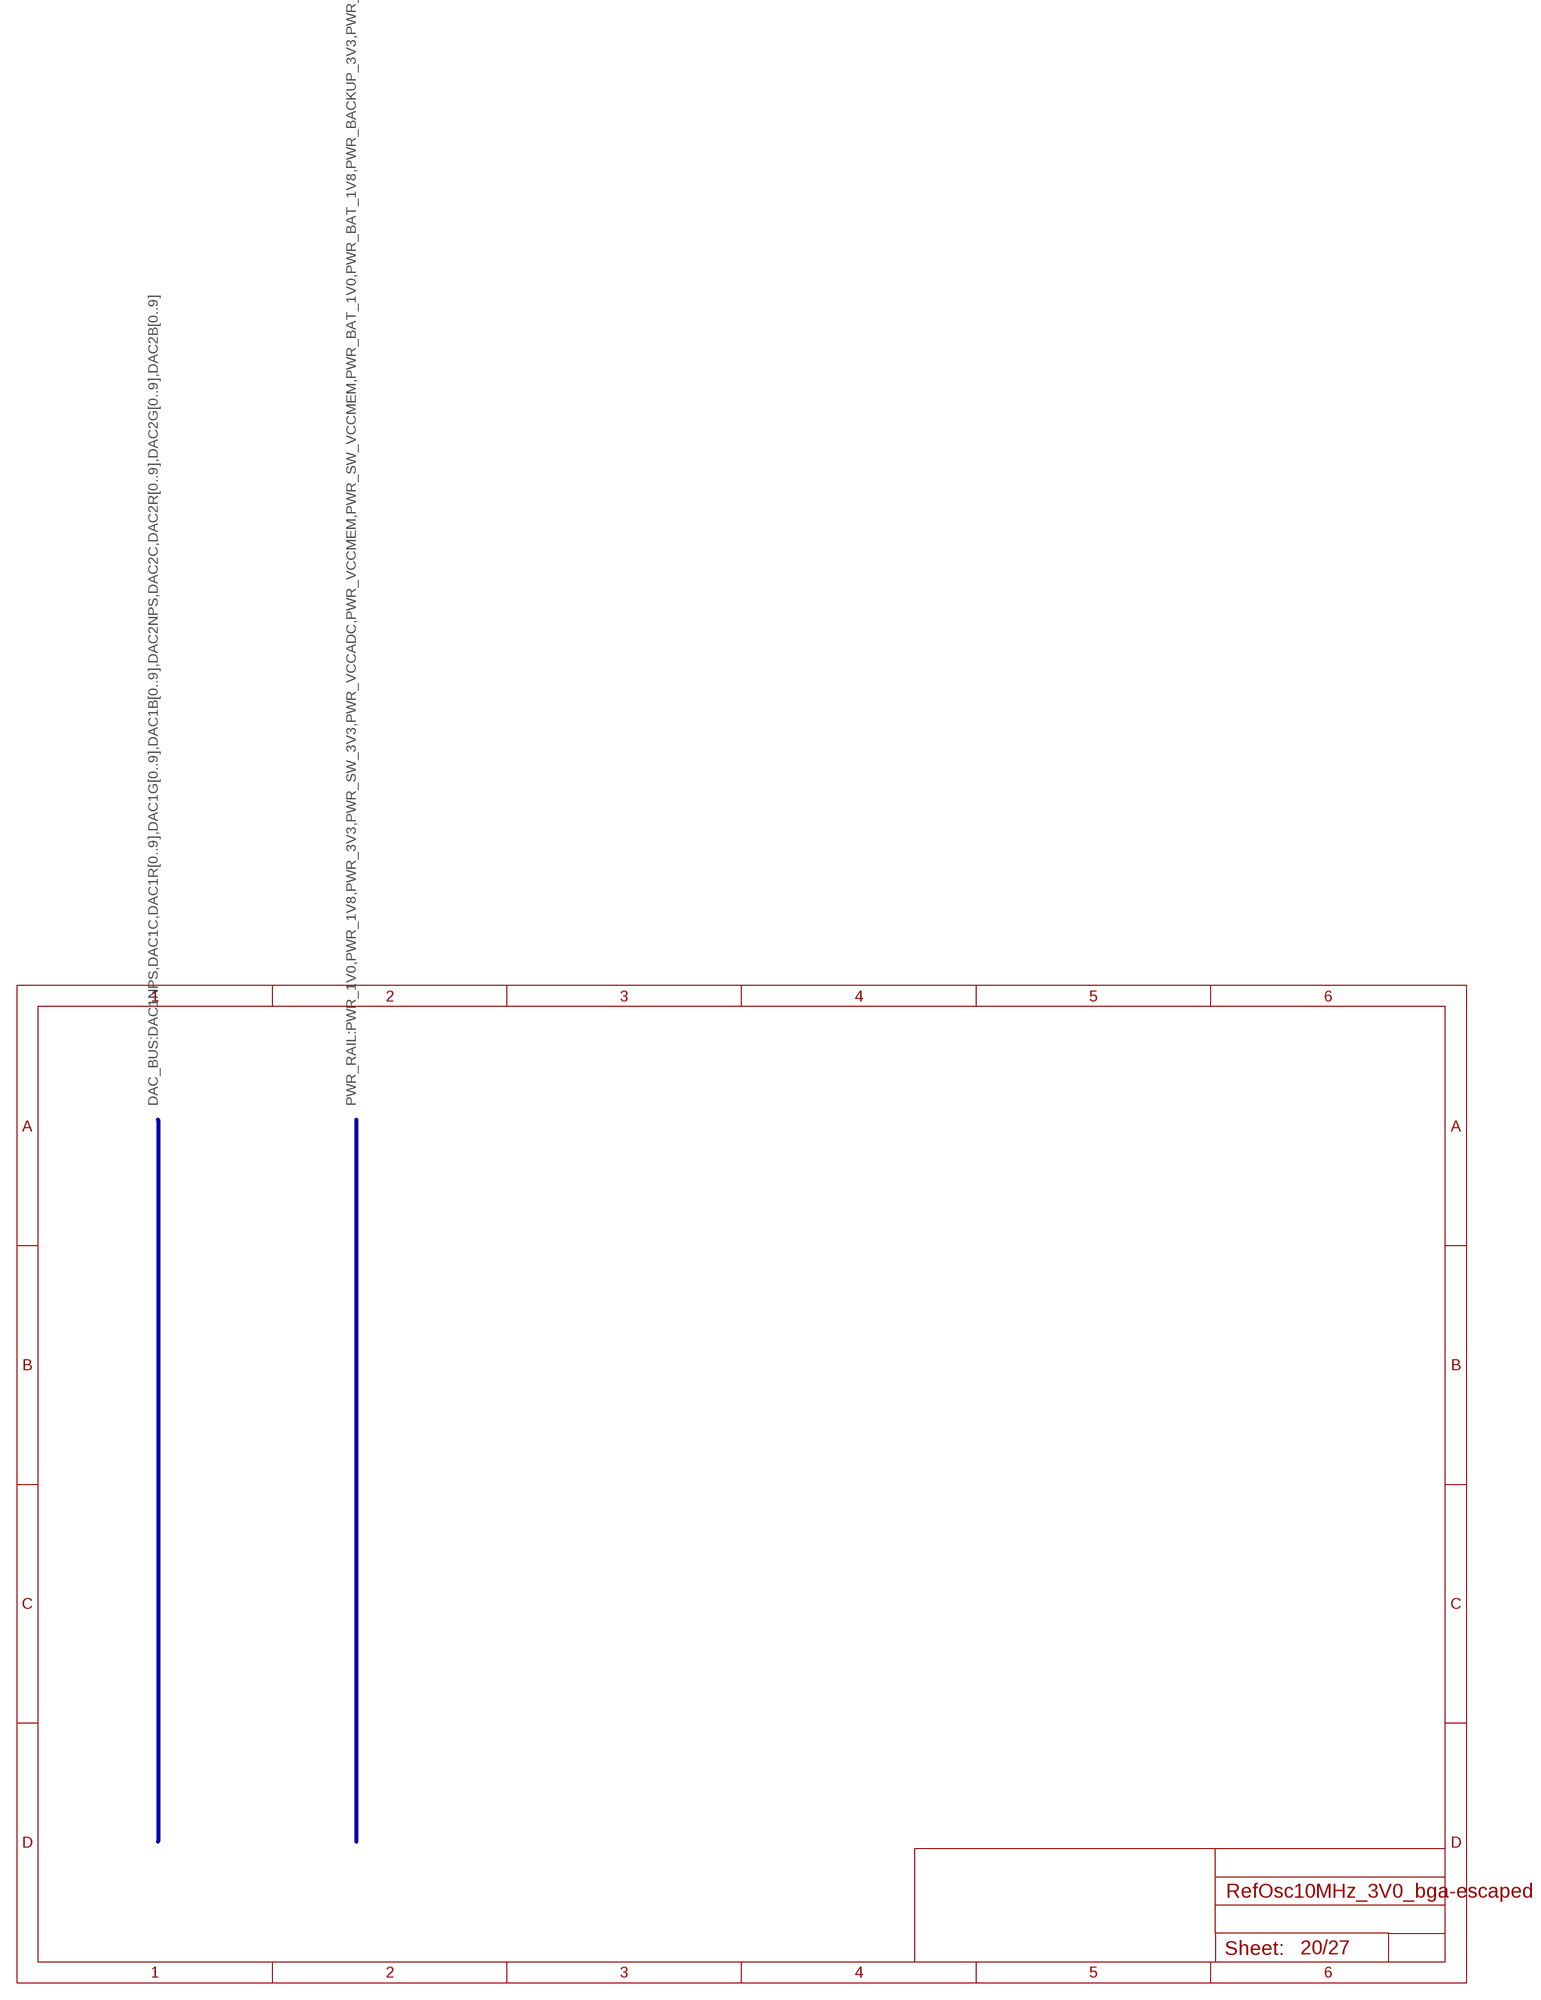
[diagram p19: schematic, sheet 20]

### Buses
DAC_BUS:DAC1NPS,DAC1C,DAC1R[0..9],DAC1G[0..9],DAC1B[0..9],DAC2NPS,DAC2C,DAC2R[0..9],DAC2G[0..9],DAC2B[0..9]
PWR_RAIL:PWR_1V0,PWR_1V8,PWR_3V3,PWR_SW_3V3,PWR_VCCADC,PWR_VCCMEM,PWR_SW_VCCMEM,PWR_BAT_1V0,PWR_BAT_1V8,PWR_BACKUP_3V3,PWR_5V0,PWR_SW_5V0,GND

## Sheet 21 of 27: DAC #2
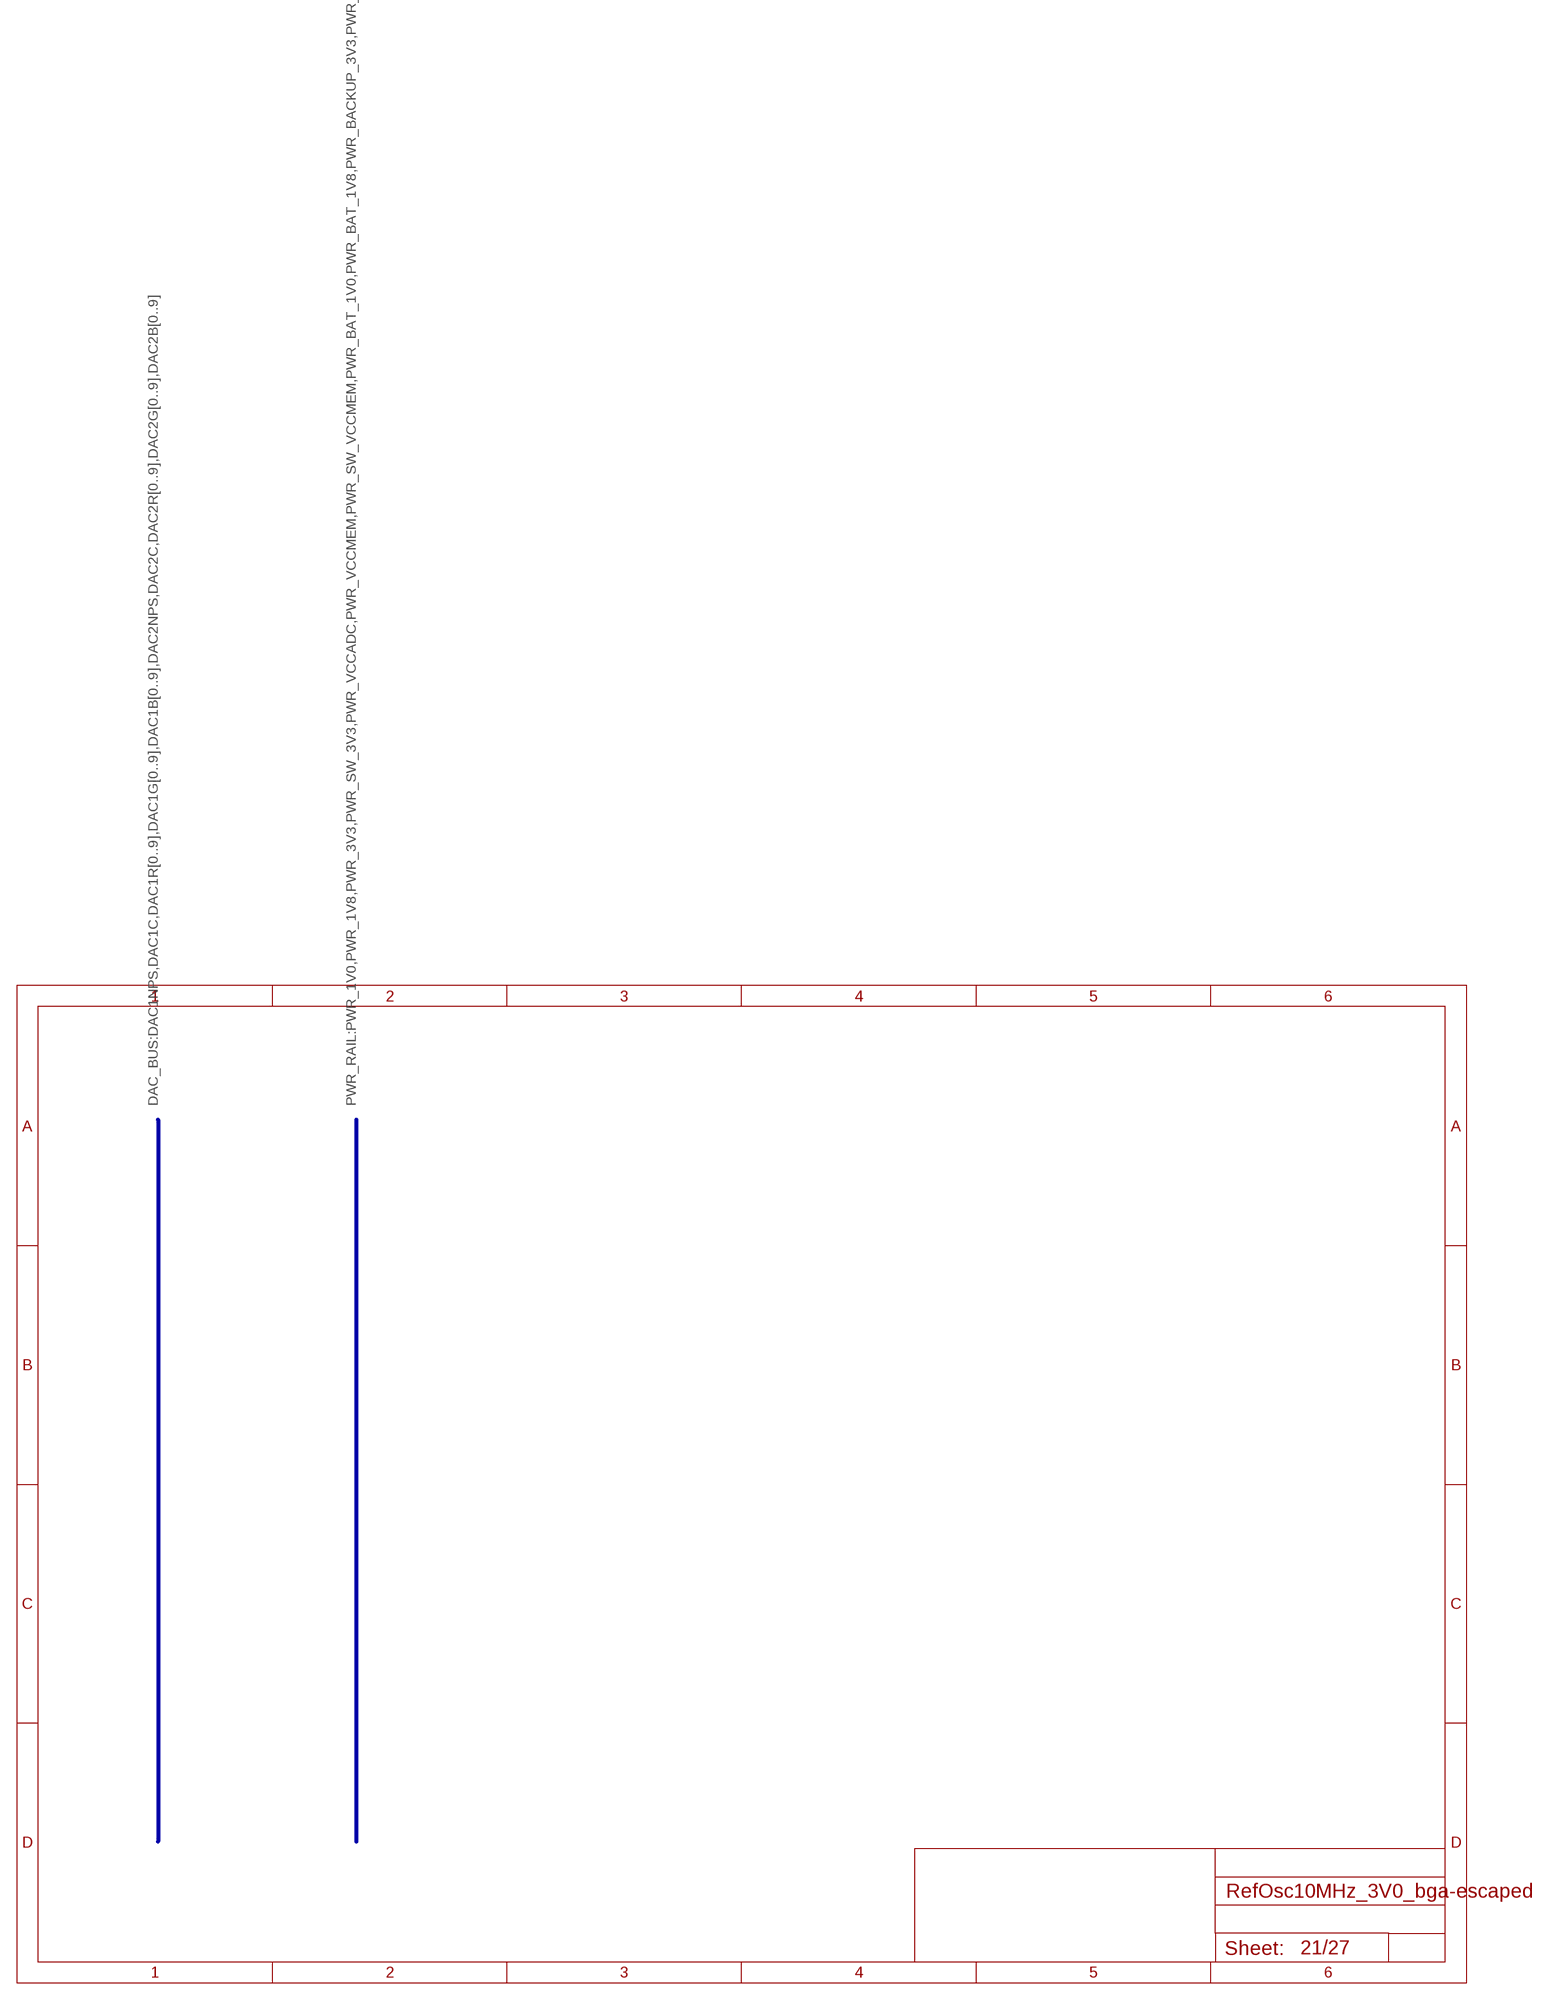
[diagram p20: schematic, sheet 21]

### Buses
DAC_BUS:DAC1NPS,DAC1C,DAC1R[0..9],DAC1G[0..9],DAC1B[0..9],DAC2NPS,DAC2C,DAC2R[0..9],DAC2G[0..9],DAC2B[0..9]
PWR_RAIL:PWR_1V0,PWR_1V8,PWR_3V3,PWR_SW_3V3,PWR_VCCADC,PWR_VCCMEM,PWR_SW_VCCMEM,PWR_BAT_1V0,PWR_BAT_1V8,PWR_BACKUP_3V3,PWR_5V0,PWR_SW_5V0,GND

## Sheet 22 of 27: Socket_0
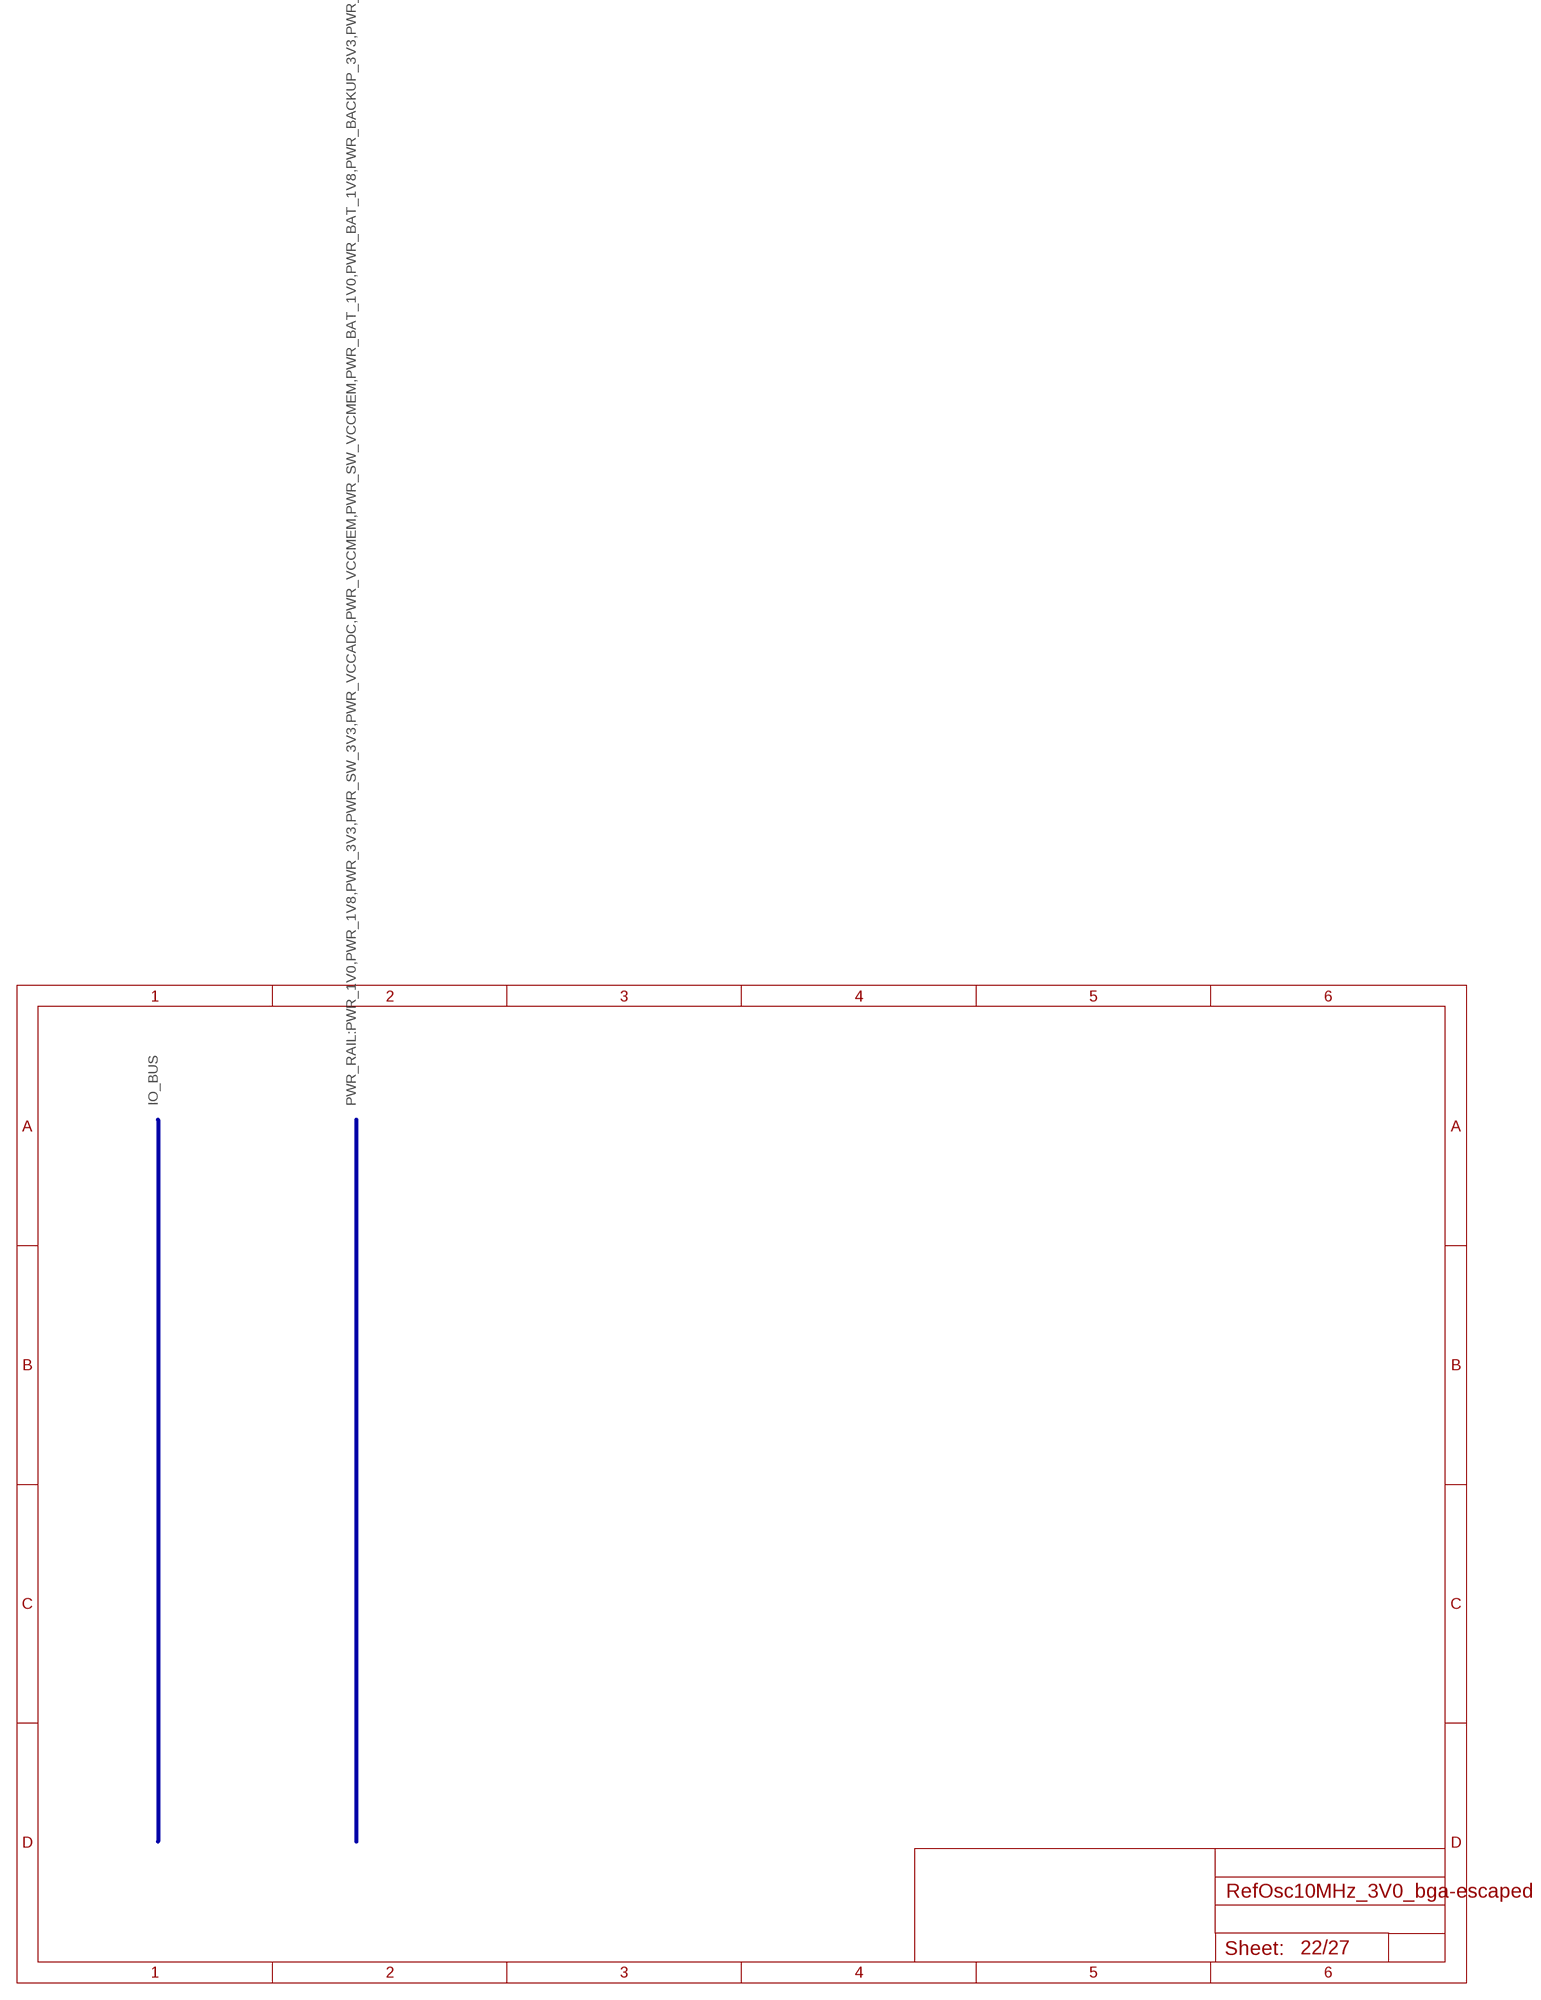
[diagram p21: schematic, sheet 22]

### Buses
IO_BUS
PWR_RAIL:PWR_1V0,PWR_1V8,PWR_3V3,PWR_SW_3V3,PWR_VCCADC,PWR_VCCMEM,PWR_SW_VCCMEM,PWR_BAT_1V0,PWR_BAT_1V8,PWR_BACKUP_3V3,PWR_5V0,PWR_SW_5V0,GND

## Sheet 23 of 27: Socket_1
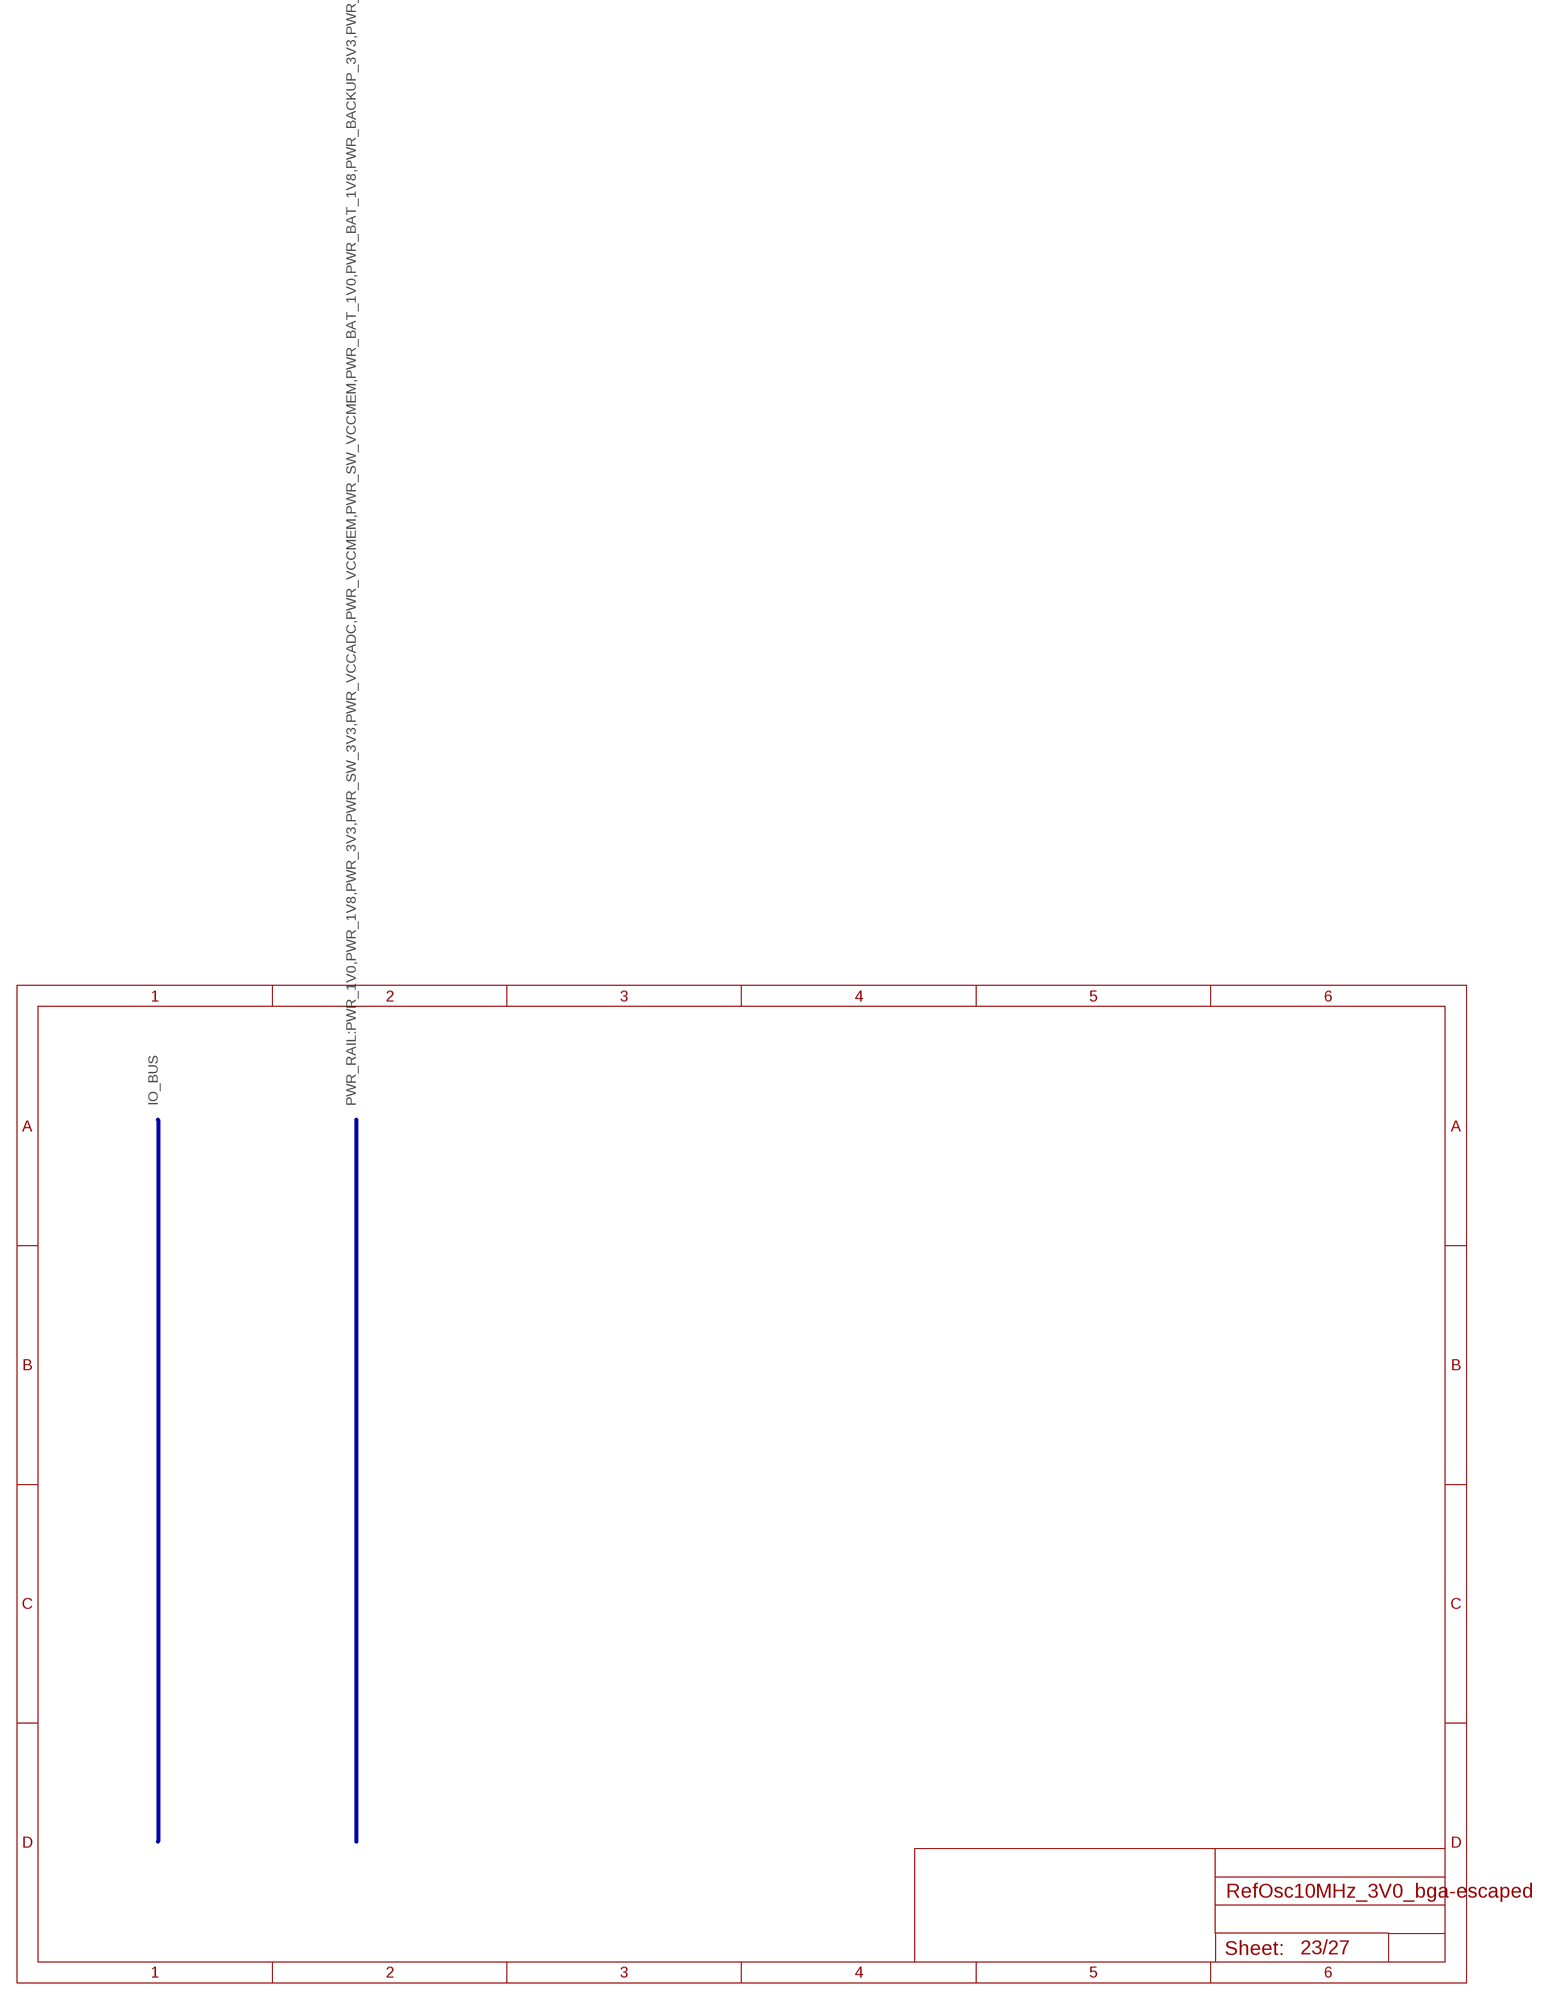
[diagram p22: schematic, sheet 23]

### Buses
IO_BUS
PWR_RAIL:PWR_1V0,PWR_1V8,PWR_3V3,PWR_SW_3V3,PWR_VCCADC,PWR_VCCMEM,PWR_SW_VCCMEM,PWR_BAT_1V0,PWR_BAT_1V8,PWR_BACKUP_3V3,PWR_5V0,PWR_SW_5V0,GND

## Sheet 24 of 27: Socket_2
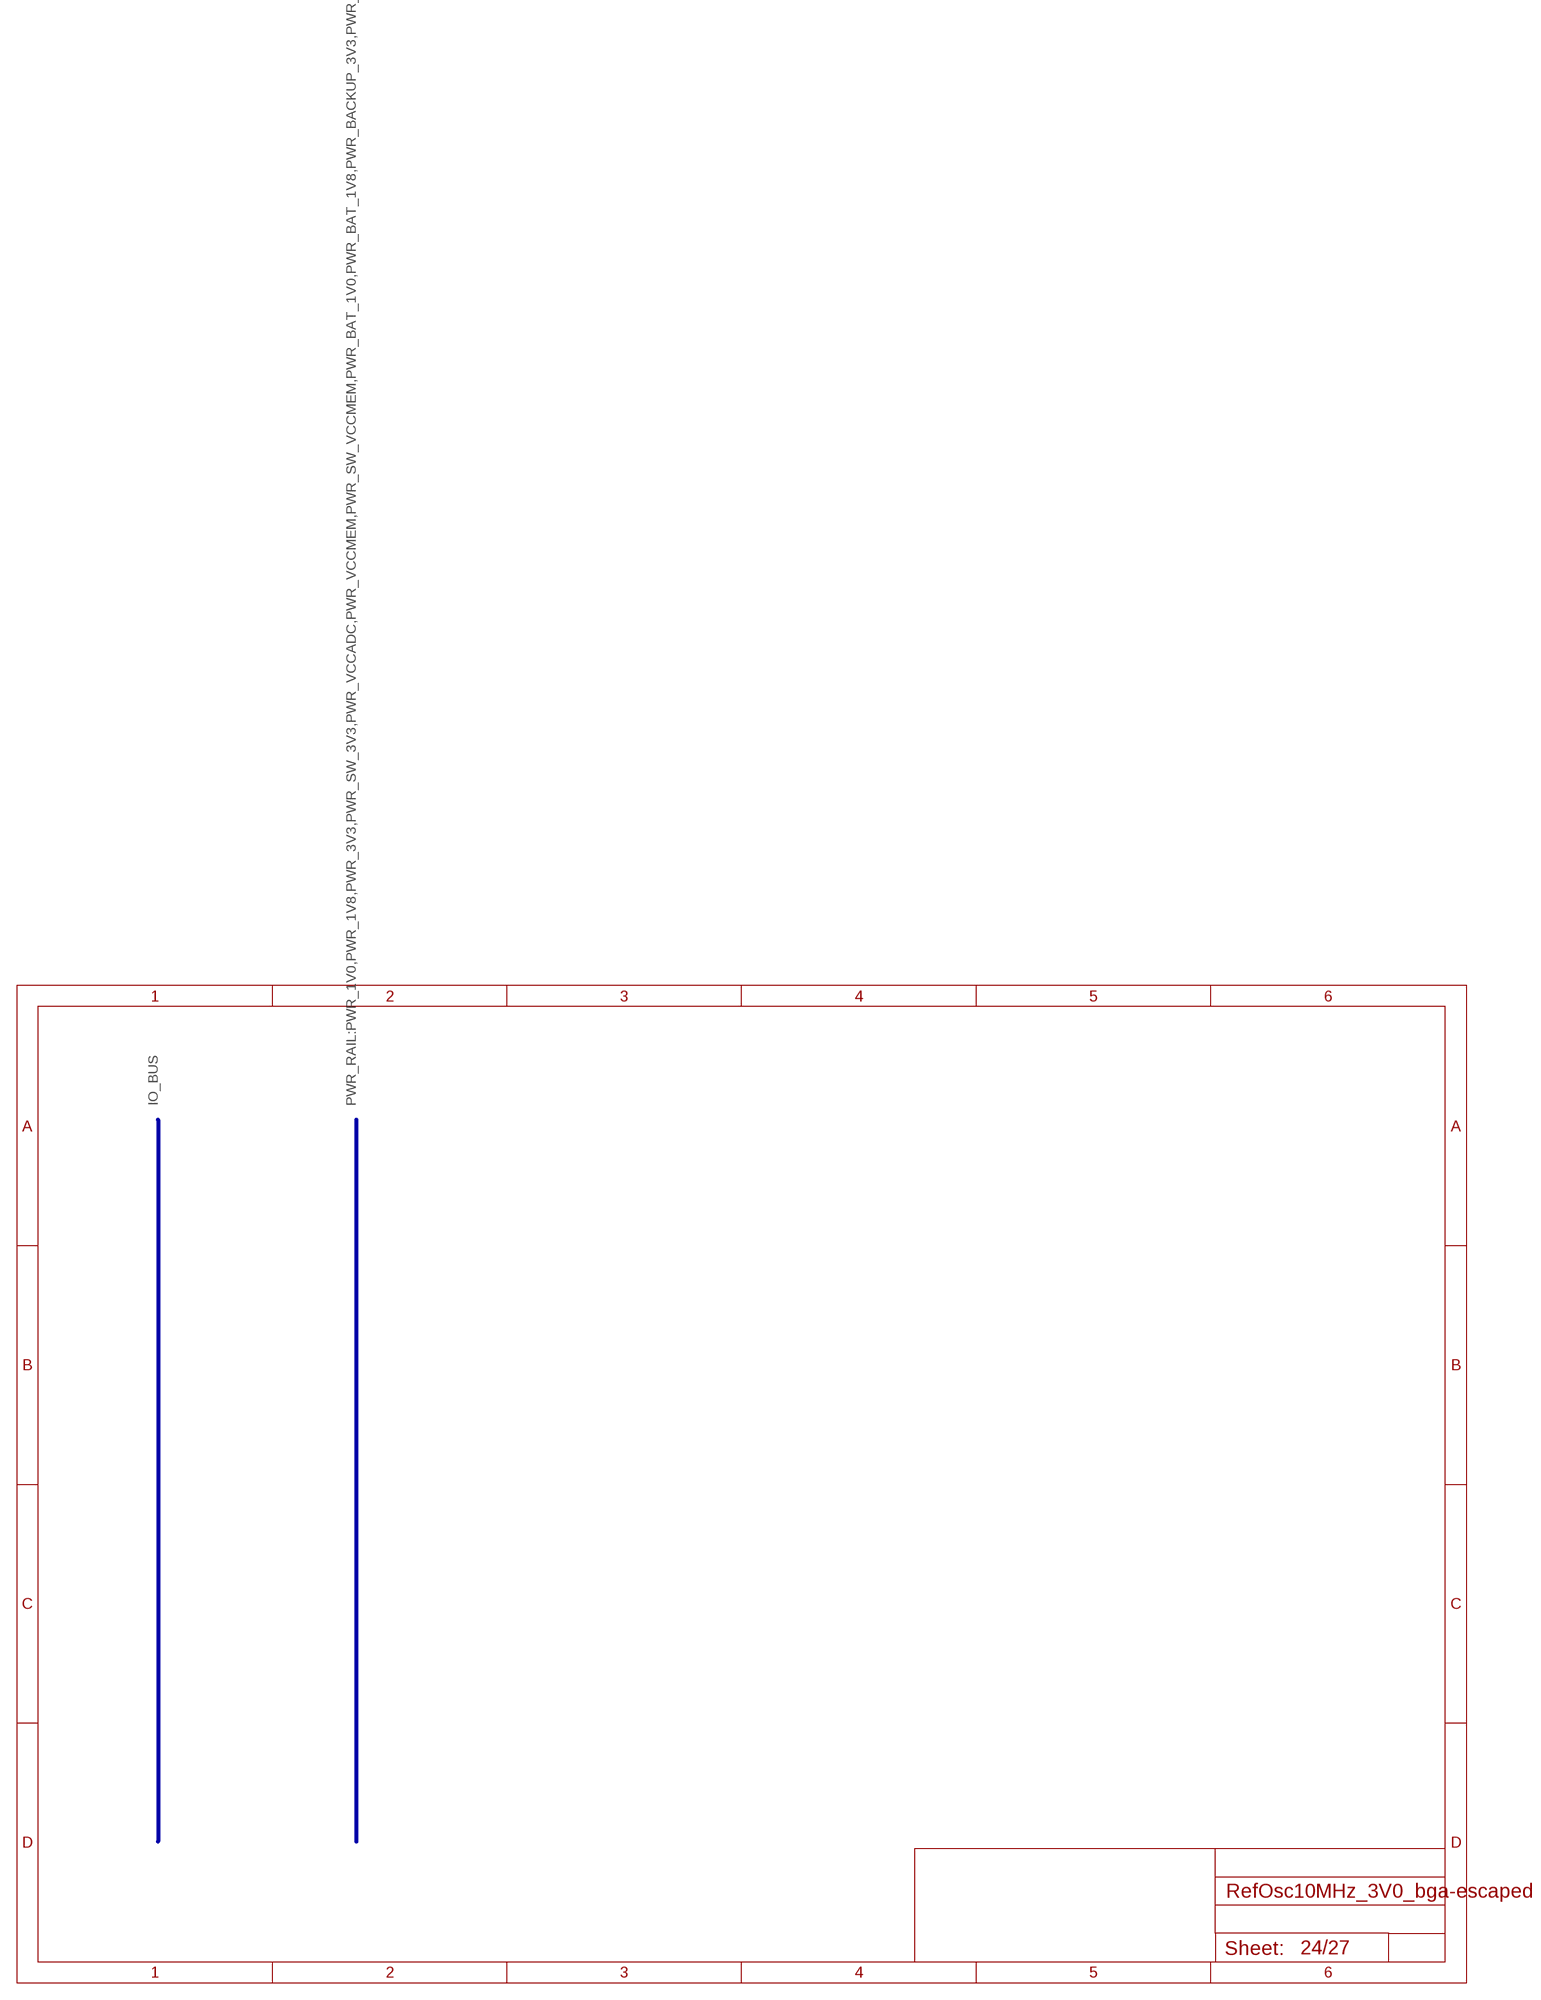
[diagram p23: schematic, sheet 24]

### Buses
IO_BUS
PWR_RAIL:PWR_1V0,PWR_1V8,PWR_3V3,PWR_SW_3V3,PWR_VCCADC,PWR_VCCMEM,PWR_SW_VCCMEM,PWR_BAT_1V0,PWR_BAT_1V8,PWR_BACKUP_3V3,PWR_5V0,PWR_SW_5V0,GND